# Altium project V3S_CDR_STD_V1_0_20150526.PrjPcb (part 1 of 2)
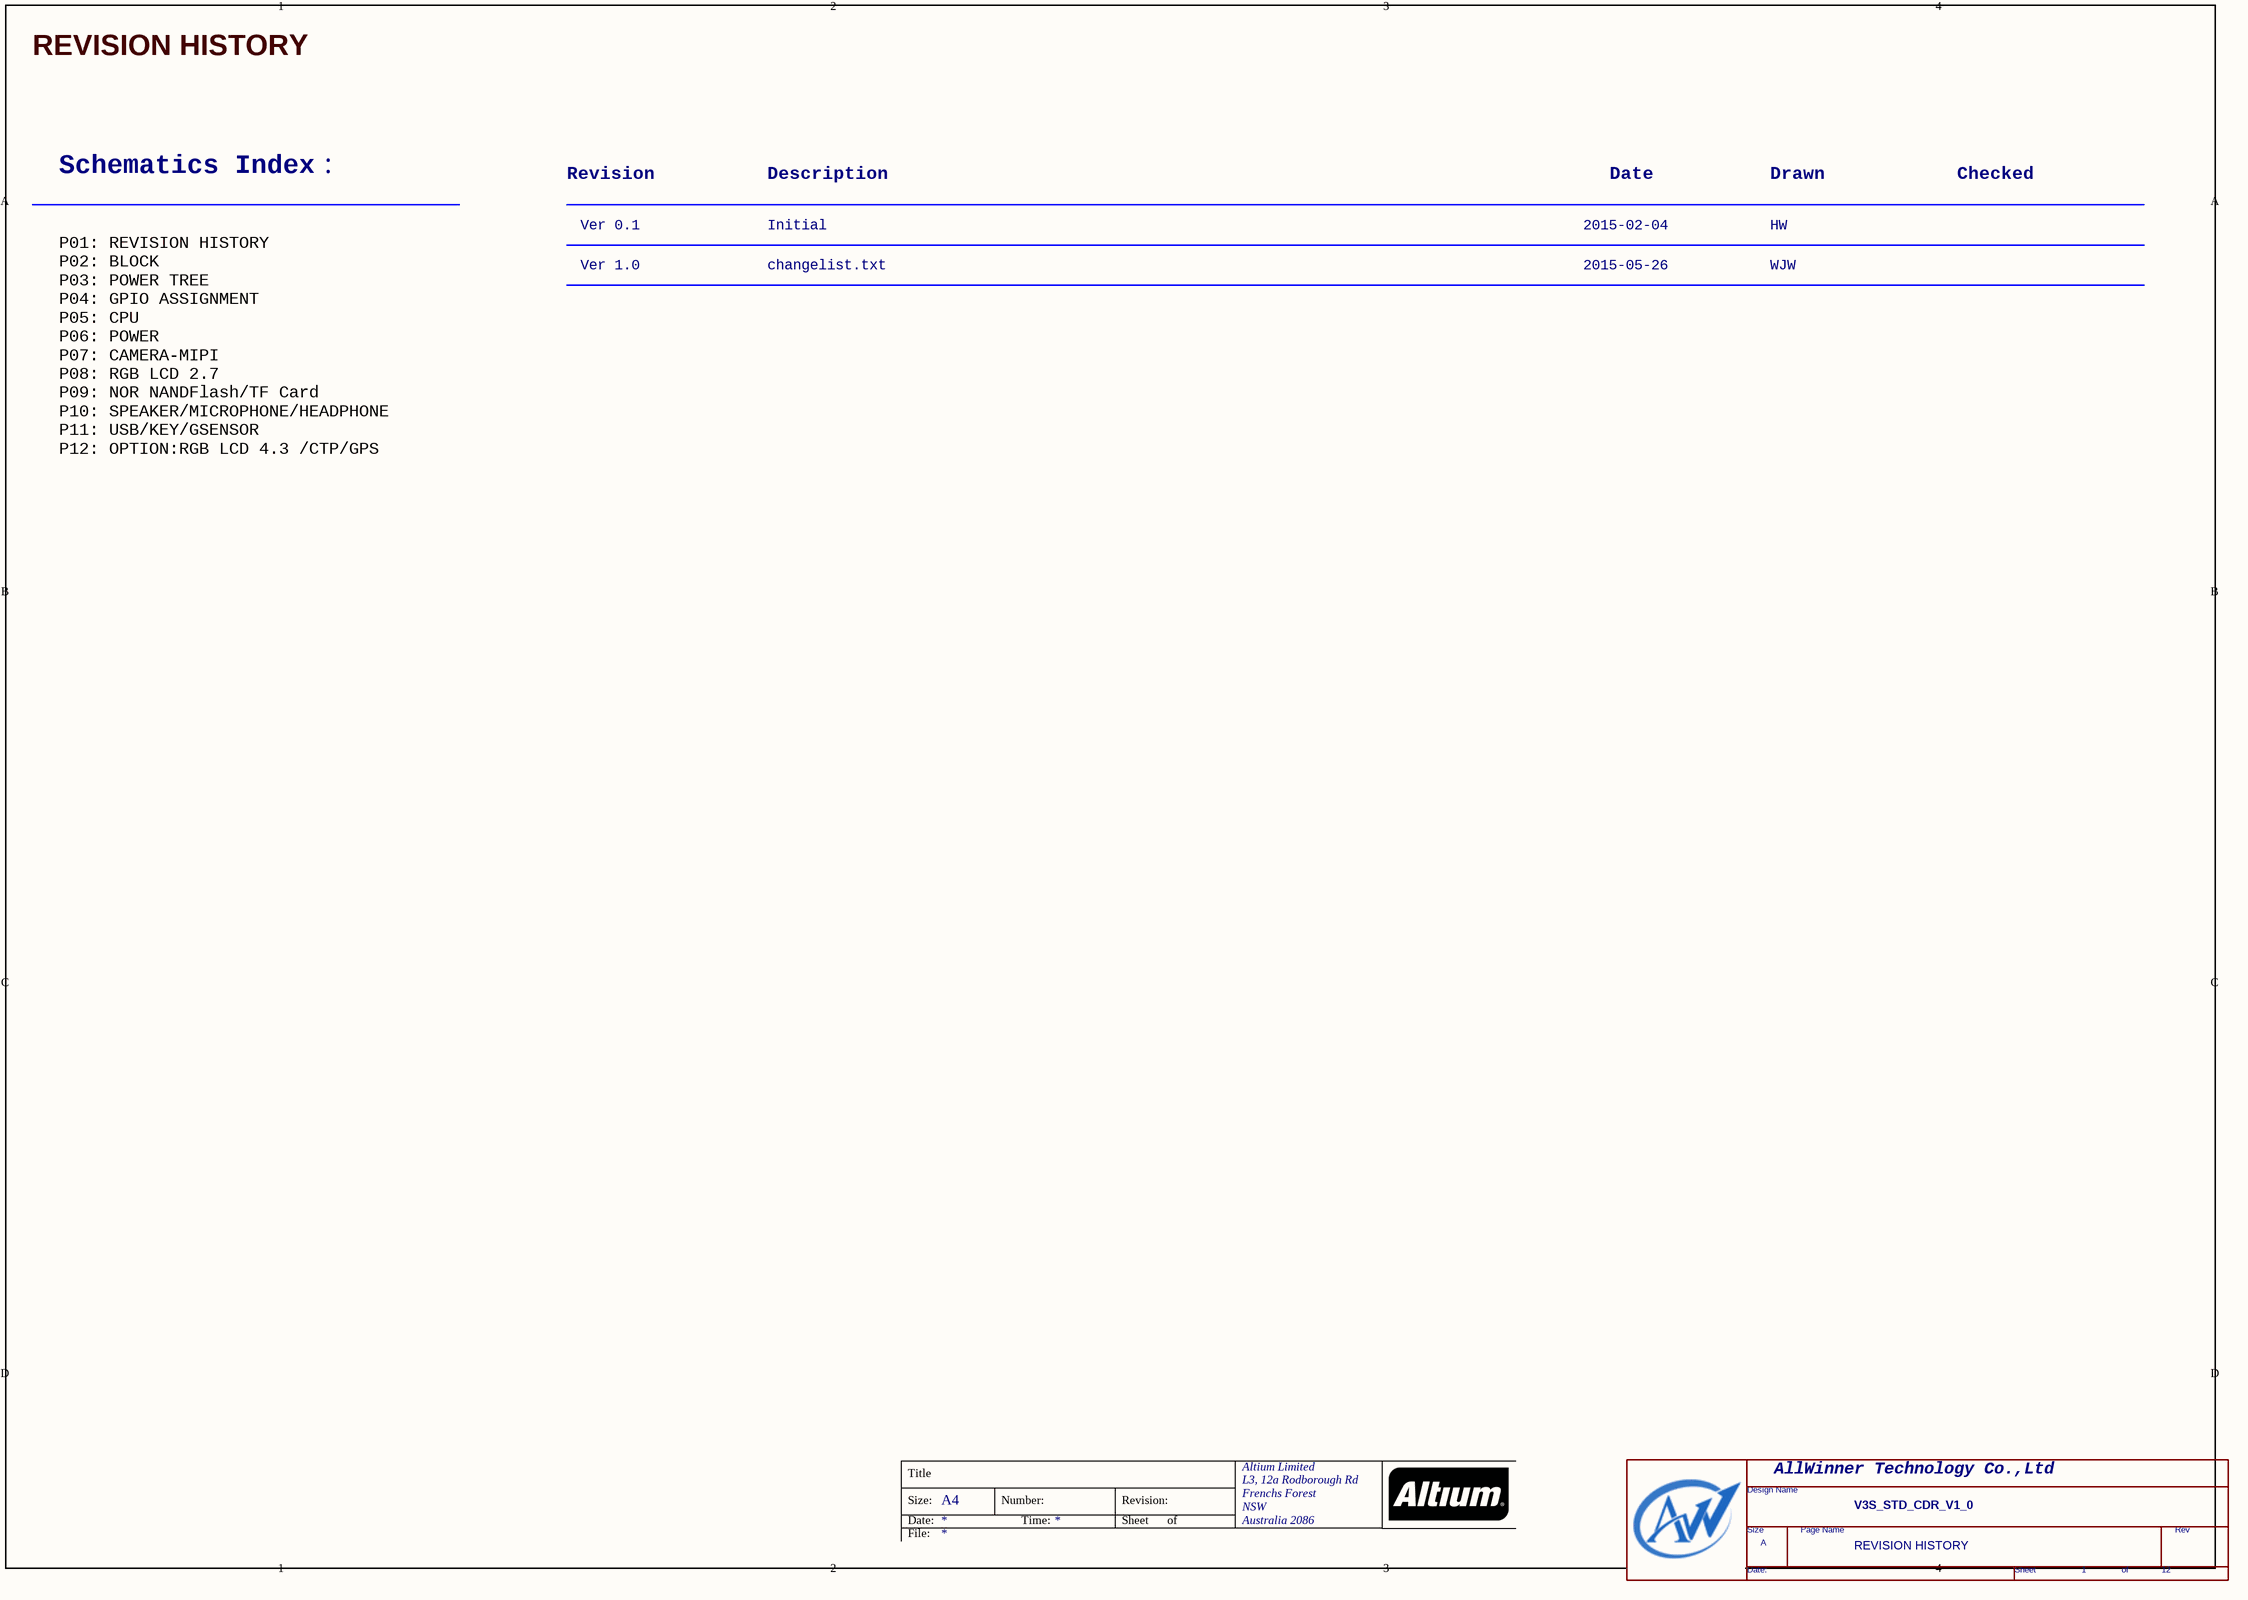
[diagram p0: 01 REVISION HISTORY.SchDoc]
12 sheets, 336 parts. Net scope: global (net labels, ports and power ports of the same name join across sheets).
Sheets:
  01 REVISION HISTORY.SchDoc
  02 BLOCK DIAGRAM.SchDoc
  03 POWER TREE.SchDoc
  04 GPIO ASSIGNMENT.SchDoc
  05 CPU.SchDoc
  06 POWER.SchDoc
  07 CAMERA-MIPI.SchDoc
  08 Serial RGB LCD.SchDoc
  09 NOR NANDFlash_TF Car.SchDoc
  10 Speaker_Microphone.SchDoc
  11 USB_KEY_GSENSOR.SchDoc
  12 RGB LCD.SchDoc

## Sheet 01 REVISION HISTORY.SchDoc
size 420 x 297 mm; Organization: Altium Limited; Address1: L3, 12a Rodborough Rd; Address2: Frenchs Forest; Address3: NSW; Address4: Australia 2086

### Parts
(Parts that share a designator on the sheet are numbered #1, #2 ... from top to bottom, then left to right.)
*#1  Page Count: 12  Page Number: 1  Page Size: A  Title: V3S_STD_CDR_V1_0  Doc: REVISION HISTORY  (hidden comment: TitleBlock0-AW)  (graphical)

### Notes on the sheet
- REVISION HISTORY
- Schematics Index：
- Revision
- Description
- Date
- Drawn
- Checked
- Ver 0.1
- Initial
- 2015-02-04
- HW
- Ver 1.0
- changelist.txt
- 2015-05-26
- WJW
- P01: REVISION HISTORY
  P02: BLOCK
  P03: POWER TREE
  P04: GPIO ASSIGNMENT
  P05: CPU
  P06: POWER
  P07: CAMERA-MIPI
  P08: RGB LCD 2.7
  P09: NOR NANDFlash/TF Card
  P10: SPEAKER/MICROPHONE/HEADPHONE
  P11: USB/KEY/GSENSOR
  P12: OPTION:RGB LCD 4.3 /CTP/GPS
- Title
- Size:
- Date:
- A4
- Number:
- Time:
- Revision:
- Sheet
- of
- File:
- (in symbol TitleBlock0-AW) AllWinner Technology Co.,Ltd; Design Name; Size; Page Name; Rev; Date:; Sheet; of

### Library data of the parts
*#1 = TitleBlock0-AW: RevCode: 0.1; Page Create Date: March  8, 1995

## Sheet 02 BLOCK DIAGRAM.SchDoc
size 420 x 297 mm; Organization: Altium Limited; Address1: L3, 12a Rodborough Rd; Address2: Frenchs Forest; Address3: NSW; Address4: Australia 2086
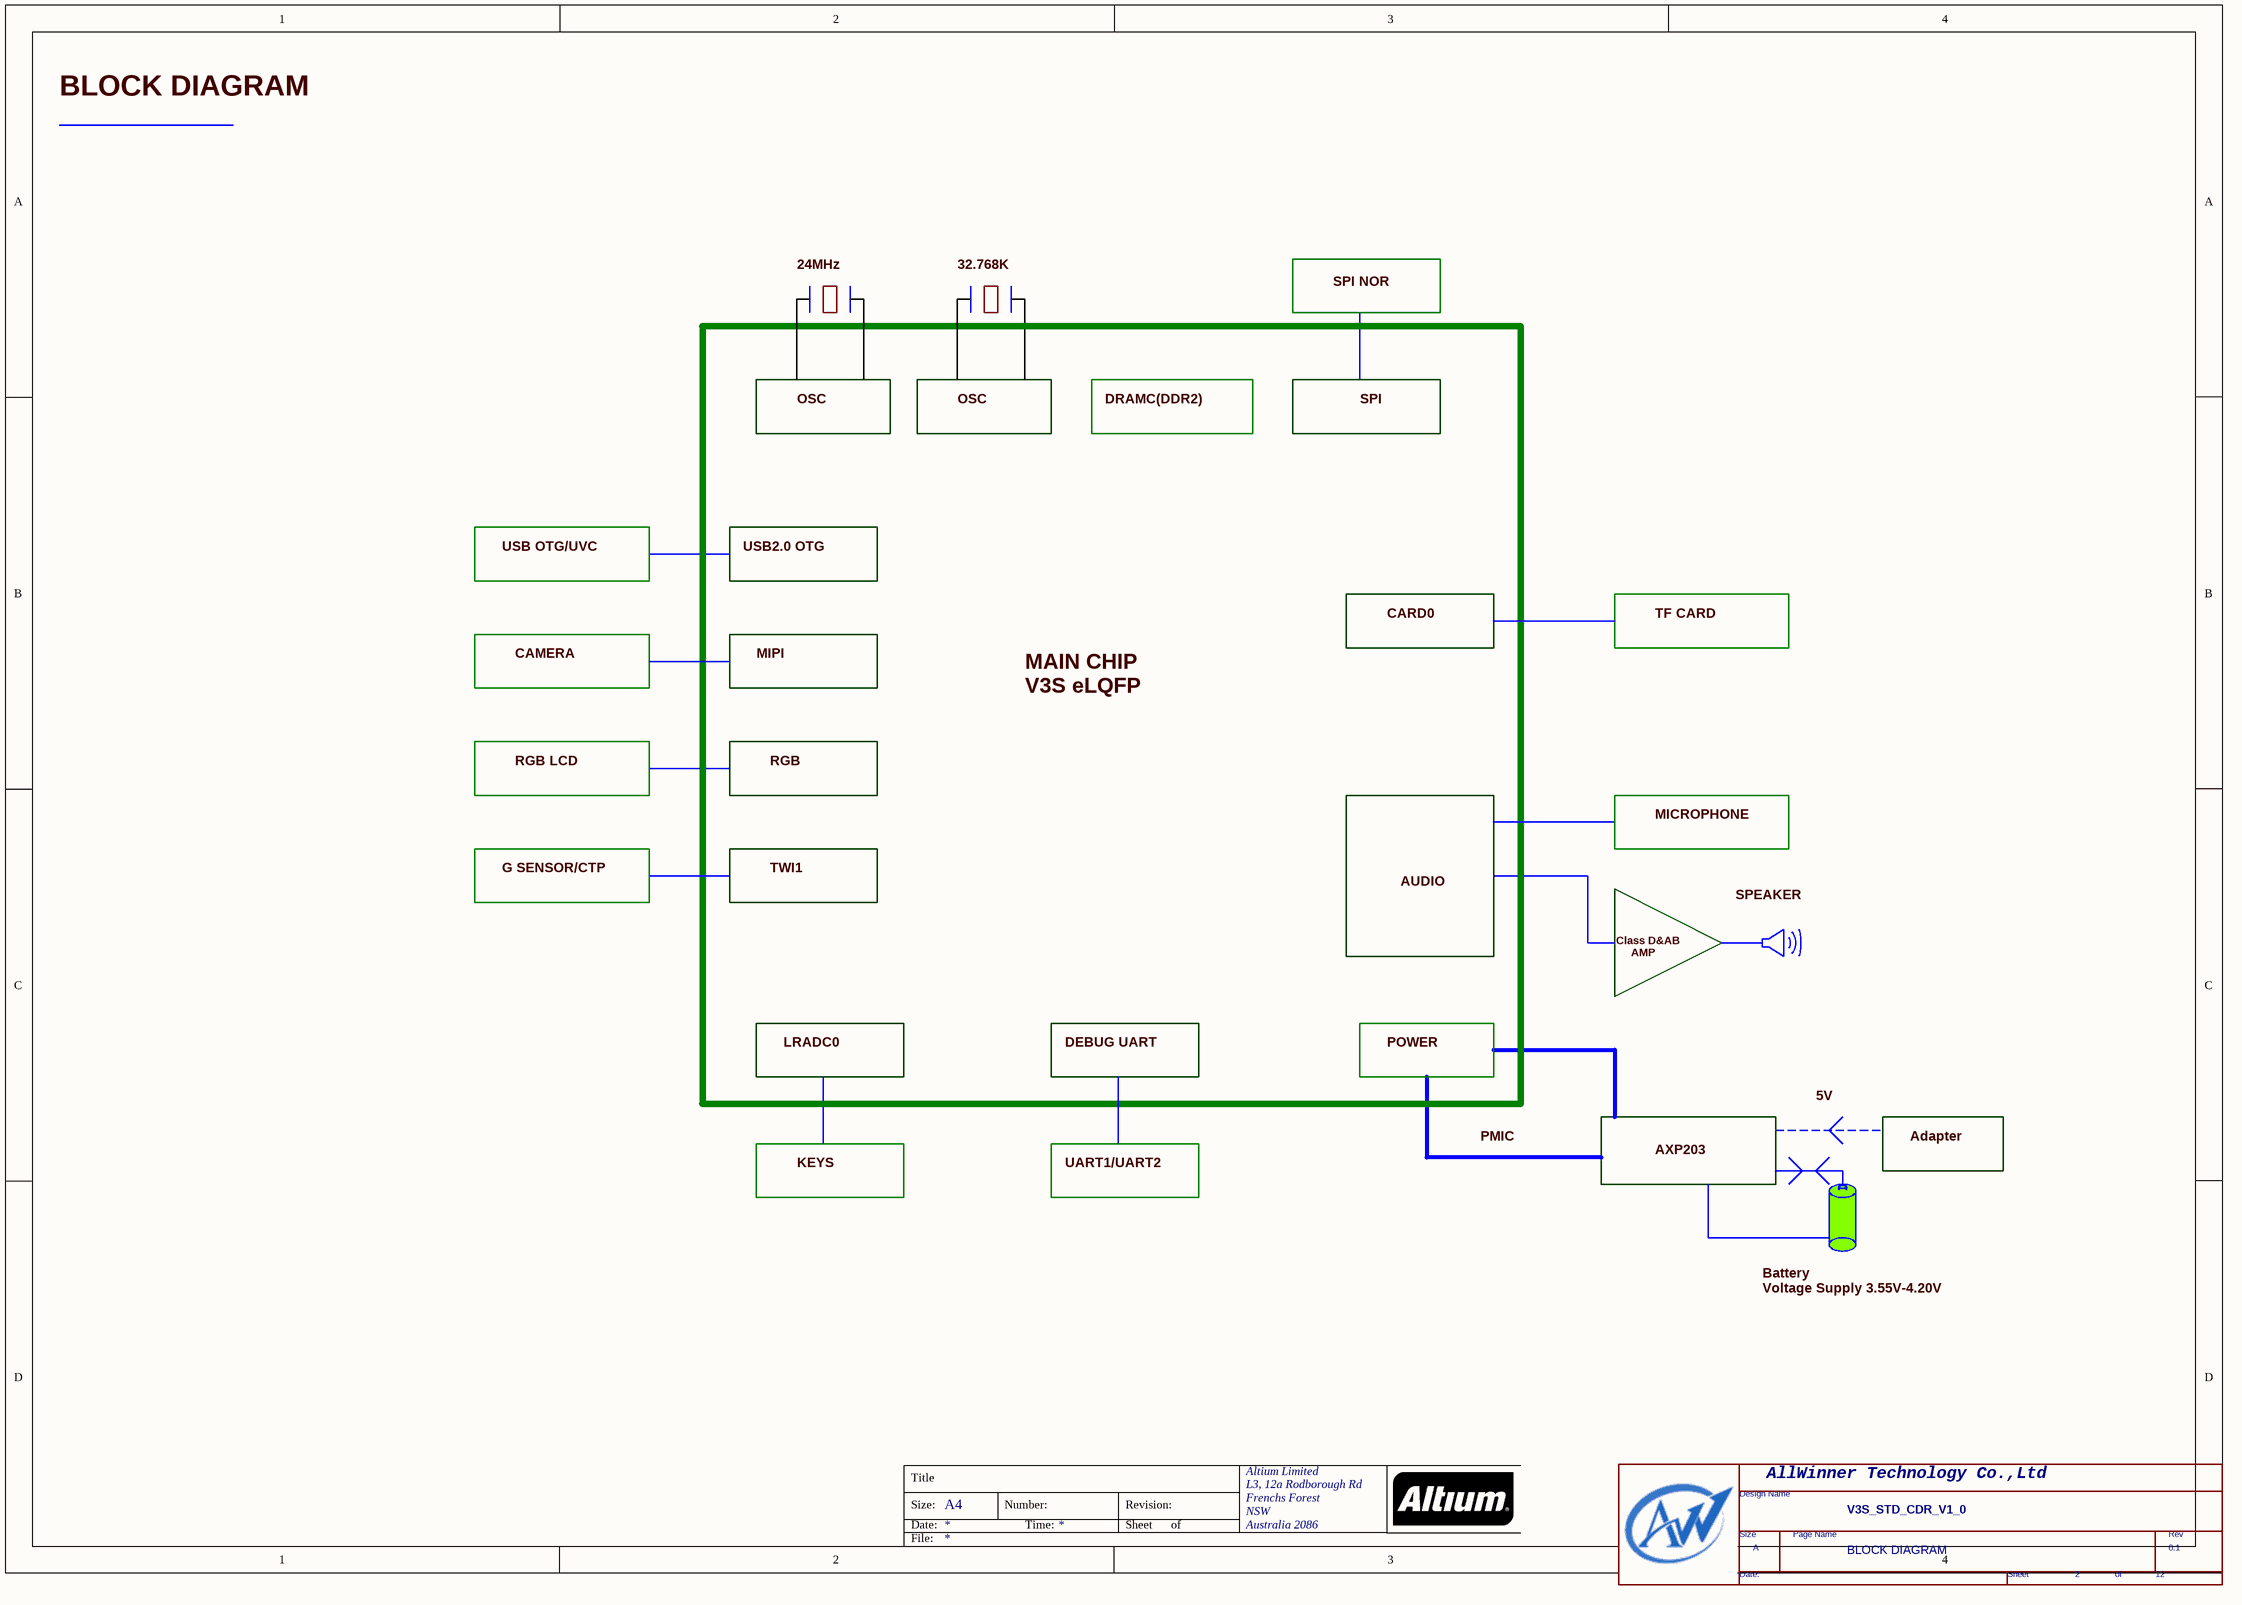
[diagram p1: 02 BLOCK DIAGRAM.SchDoc]

### Parts
(Parts that share a designator on the sheet are numbered #1, #2 ... from top to bottom, then left to right.)
*#2  Page Count: 12  Page Number: 2  Page Size: A  Title: V3S_STD_CDR_V1_0  RevCode: 0.1  Doc: BLOCK DIAGRAM  (hidden comment: TitleBlock0-AW)  (graphical)

### Notes on the sheet
- BLOCK DIAGRAM
- 24MHz
- 32.768K
- SPI NOR
- OSC
- DRAMC(DDR2)
- SPI
- USB OTG/UVC
- USB2.0 OTG
- CAMERA
- MIPI
- MAIN CHIP
  V3S eLQFP
- CARD0
- TF CARD
- RGB LCD
- RGB
- MICROPHONE
- G SENSOR/CTP
- TWI1
- AUDIO
- Class D&AB
  AMP
- SPEAKER
- LRADC0
- DEBUG UART
- POWER
- 5V
- KEYS
- UART1/UART2
- PMIC
- AXP203
- Adapter
- Battery
  Voltage Supply 3.55V-4.20V
- Title
- Size:
- Date:
- A4
- Number:
- Time:
- Revision:
- Sheet
- of
- File:
- (in symbol TitleBlock0-AW) AllWinner Technology Co.,Ltd; Design Name; Size; Page Name; Rev; Date:; Sheet; of

### Library data of the parts
*#2 = TitleBlock0-AW: Page Create Date: March  8, 1995

## Sheet 03 POWER TREE.SchDoc
size 420 x 297 mm; Organization: Altium Limited; Address1: L3, 12a Rodborough Rd; Address2: Frenchs Forest; Address3: NSW; Address4: Australia 2086
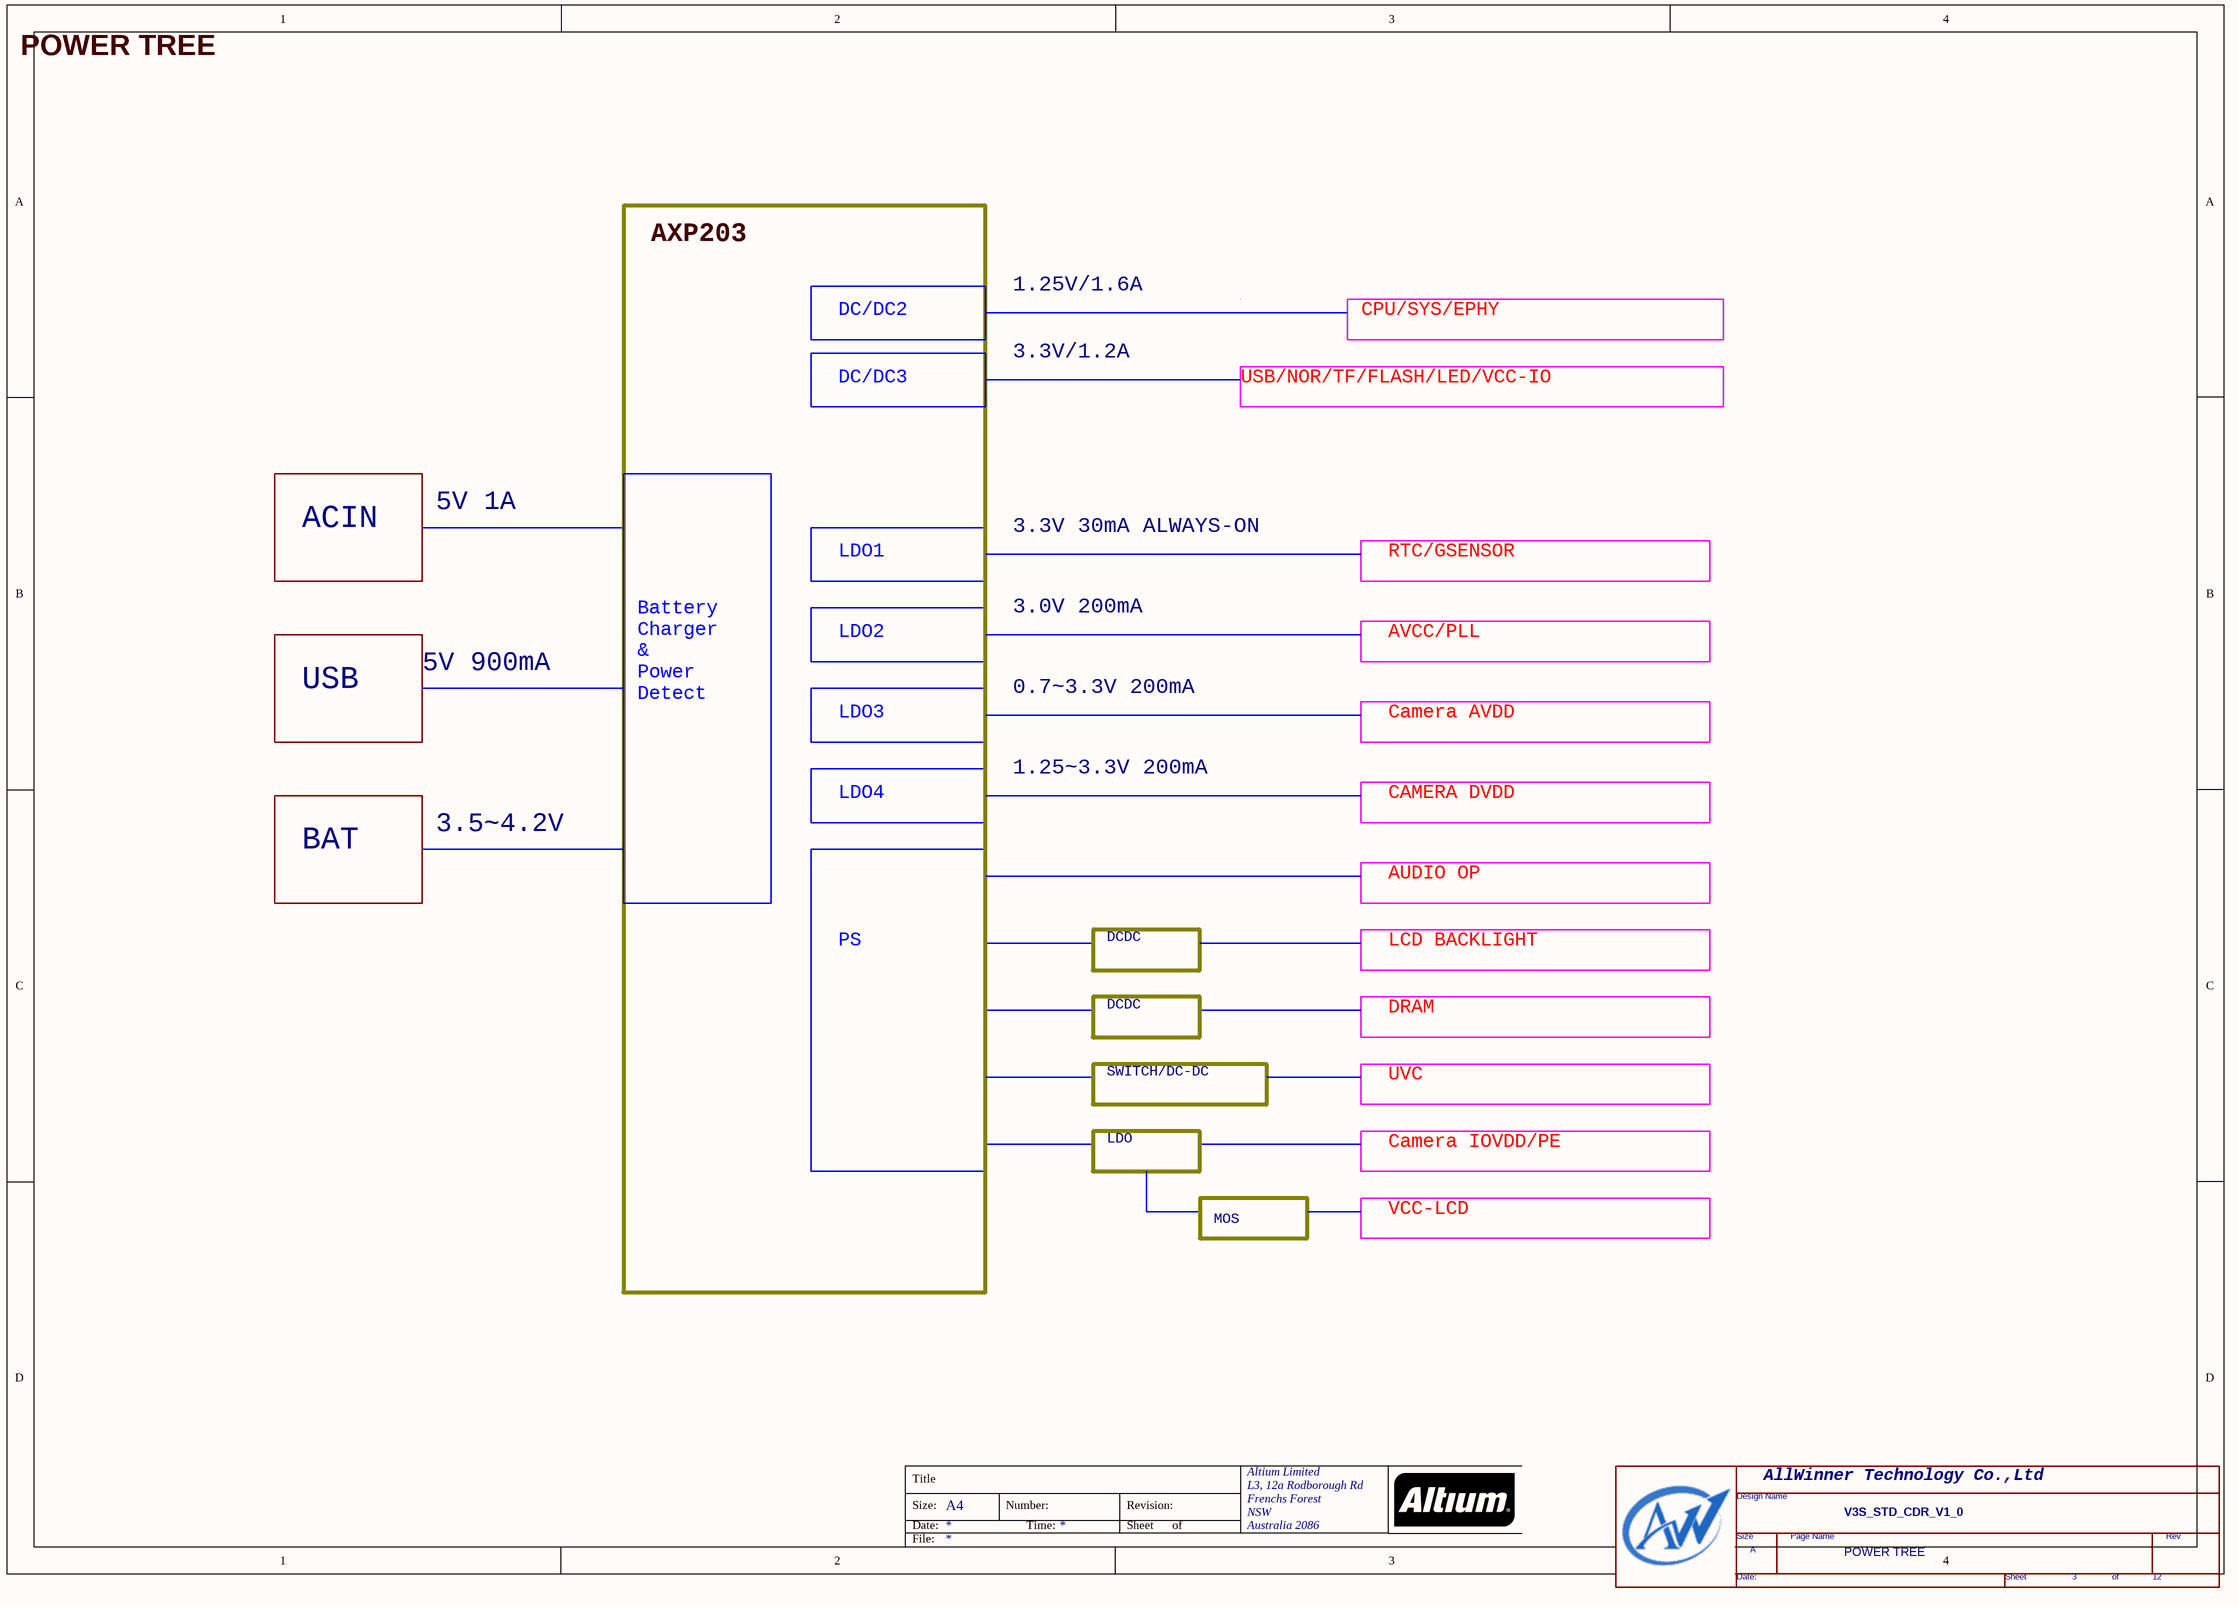
[diagram p2: 03 POWER TREE.SchDoc]

### Parts
(Parts that share a designator on the sheet are numbered #1, #2 ... from top to bottom, then left to right.)
*#3  Page Count: 12  Page Number: 3  Page Size: A  Title: V3S_STD_CDR_V1_0  Doc: POWER TREE  (hidden comment: TitleBlock0-AW)  (graphical)

### Notes on the sheet
- POWER TREE
- AXP203
- DC/DC2
- 1.25V/1.6A
- CPU/SYS/EPHY
- DC/DC3
- 3.3V/1.2A
- USB/NOR/TF/FLASH/LED/VCC-IO
- 5V 1A
- ACIN
- Battery
  Charger
  &
  Power
  Detect
- LDO1
- 3.3V 30mA ALWAYS-ON
- RTC/GSENSOR
- LDO2
- 3.0V 200mA
- AVCC/PLL
- USB
- 5V 900mA
- LDO3
- 0.7~3.3V 200mA
- Camera AVDD
- 1.25~3.3V 200mA
- BAT
- 3.5~4.2V
- LDO4
- CAMERA DVDD
- AUDIO OP
- PS
- DCDC
- LCD BACKLIGHT
- DRAM
- SWITCH/DC-DC
- UVC
- LDO
- Camera IOVDD/PE
- MOS
- VCC-LCD
- Title
- Size:
- Date:
- A4
- Number:
- Time:
- Revision:
- Sheet
- of
- File:
- (in symbol TitleBlock0-AW) AllWinner Technology Co.,Ltd; Design Name; Size; Page Name; Rev; Date:; Sheet; of

### Library data of the parts
*#3 = TitleBlock0-AW: Page Create Date: March  8, 1995

## Sheet 04 GPIO ASSIGNMENT.SchDoc
size 420 x 297 mm; Organization: Altium Limited; Address1: L3, 12a Rodborough Rd; Address2: Frenchs Forest; Address3: NSW; Address4: Australia 2086
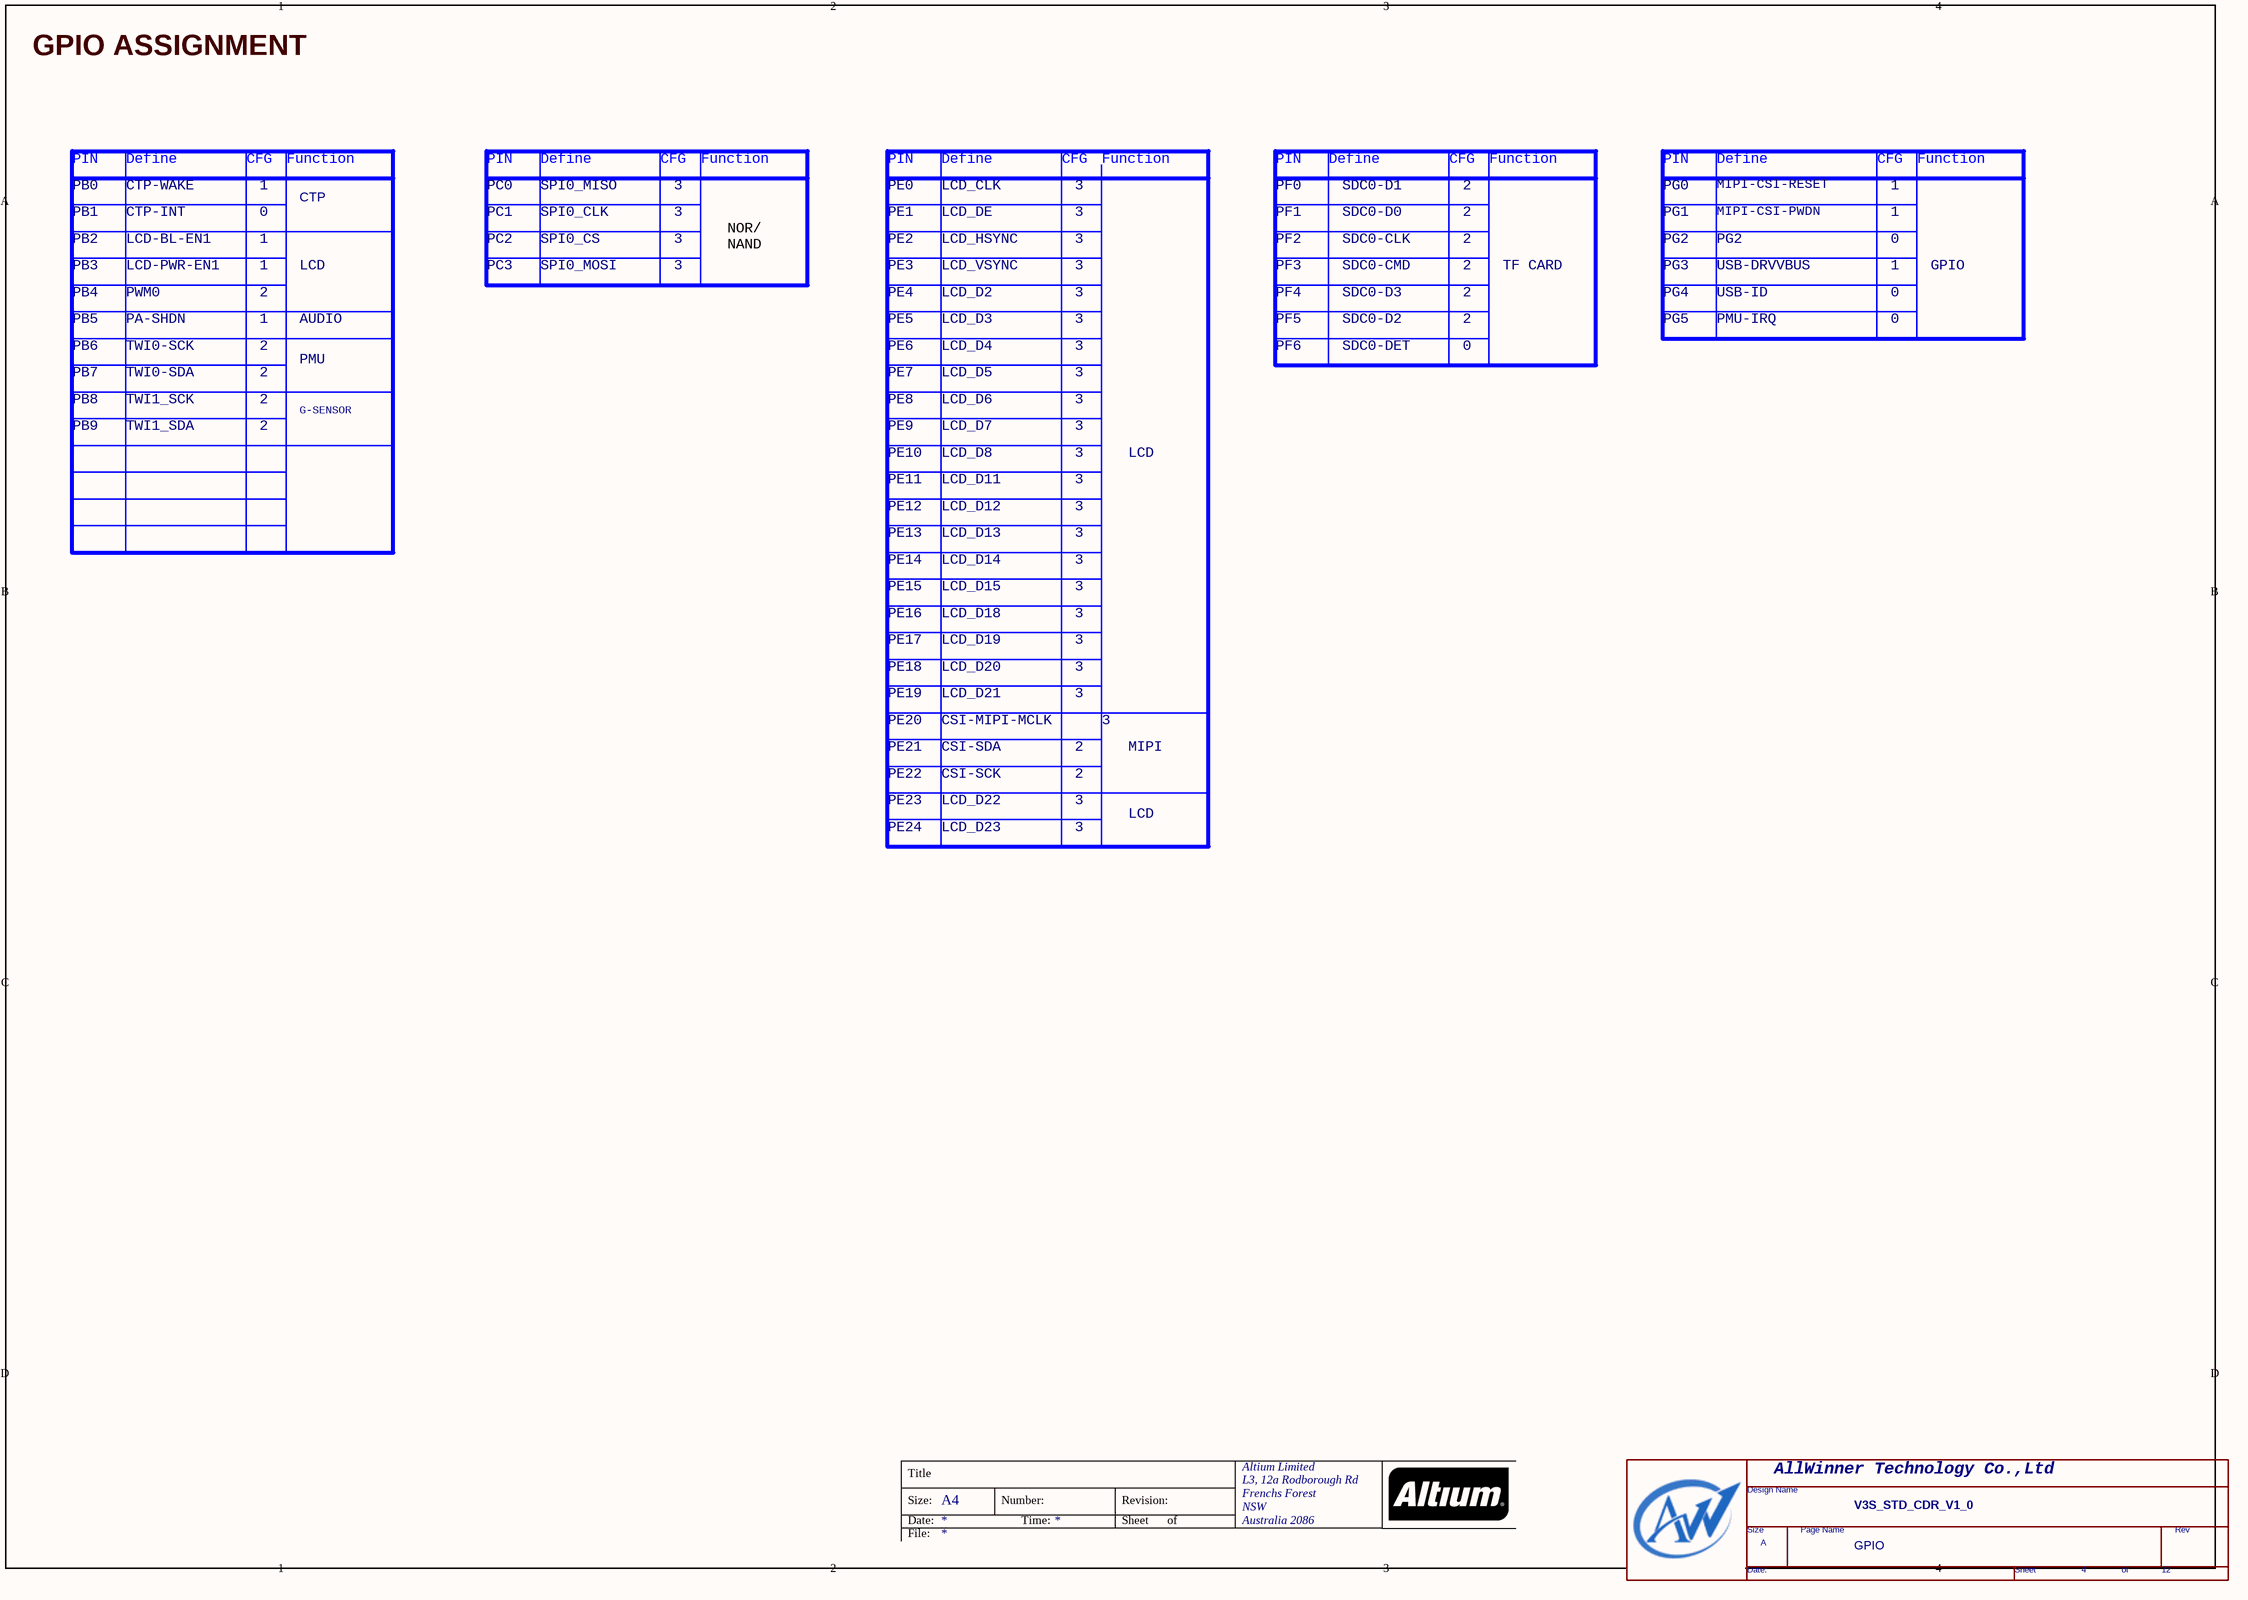
[diagram p3: 04 GPIO ASSIGNMENT.SchDoc]

### Parts
(Parts that share a designator on the sheet are numbered #1, #2 ... from top to bottom, then left to right.)
*#4  Page Count: 12  Page Number: 4  Page Size: A  Title: V3S_STD_CDR_V1_0  Doc: GPIO  (hidden comment: TitleBlock0-AW)  (graphical)

### Notes on the sheet
- GPIO ASSIGNMENT
- PIN
- PB0
- Define
- CTP-WAKE
- CFG
- 1
- Function
- PC0
- SPI0_MISO
- 3
- PE0
- LCD_CLK
- PF0
- SDC0-D1
- 2
- PG0
- MIPI-CSI-RESET
- PB1
- PB2
- CTP-INT
- LCD-BL-EN1
- 0
- CTP
- PC1
- PC2
- SPI0_CLK
- SPI0_CS
- NOR/
  NAND
- PE1
- PE2
- LCD_DE
- LCD_HSYNC
- PF1
- PF2
- SDC0-D0
- SDC0-CLK
- PG1
- PG2
- MIPI-CSI-PWDN
- PB3
- PB4
- PB5
- LCD-PWR-EN1
- PWM0
- PA-SHDN
- LCD
- AUDIO
- PC3
- SPI0_MOSI
- PE3
- PE4
- PE5
- LCD_D3
- LCD_D2
- LCD_VSYNC
- PF3
- PF4
- PF5
- SDC0-D2
- SDC0-D3
- SDC0-CMD
- TF CARD
- PG3
- PG4
- PG5
- USB-ID
- PMU-IRQ
- USB-DRVVBUS
- GPIO
- PB6
- PB7
- TWI0-SDA
- TWI0-SCK
- PMU
- PE6
- PE7
- LCD_D4
- LCD_D5
- PF6
- SDC0-DET
- PB8
- PB9
- TWI1_SCK
- TWI1_SDA
- G-SENSOR
- PE8
- PE9
- PE10
- LCD_D6
- LCD_D7
- LCD_D8
- PE11
- PE12
- LCD_D11
- LCD_D12
- PE13
- PE14
- PE15
- LCD_D15
- LCD_D14
- LCD_D13
- PE16
- PE17
- LCD_D19
- LCD_D18
- PE18
- PE19
- PE20
- LCD_D21
- LCD_D20
- CSI-MIPI-MCLK
- PE21
- PE22
- CSI-SDA
- CSI-SCK
- MIPI
- PE23
- PE24
- LCD_D23
- LCD_D22
- Title
- Size:
- Date:
- A4
- Number:
- Time:
- Revision:
- Sheet
- of
- File:
- (in symbol TitleBlock0-AW) AllWinner Technology Co.,Ltd; Design Name; Size; Page Name; Rev; Date:; Sheet; of

### Library data of the parts
*#4 = TitleBlock0-AW: RevCode: 0.1; Page Create Date: March  8, 1995

## Sheet 05 CPU.SchDoc
size 420 x 297 mm; Organization: Altium Limited; Address1: L3, 12a Rodborough Rd; Address2: Frenchs Forest; Address3: NSW; Address4: Australia 2086
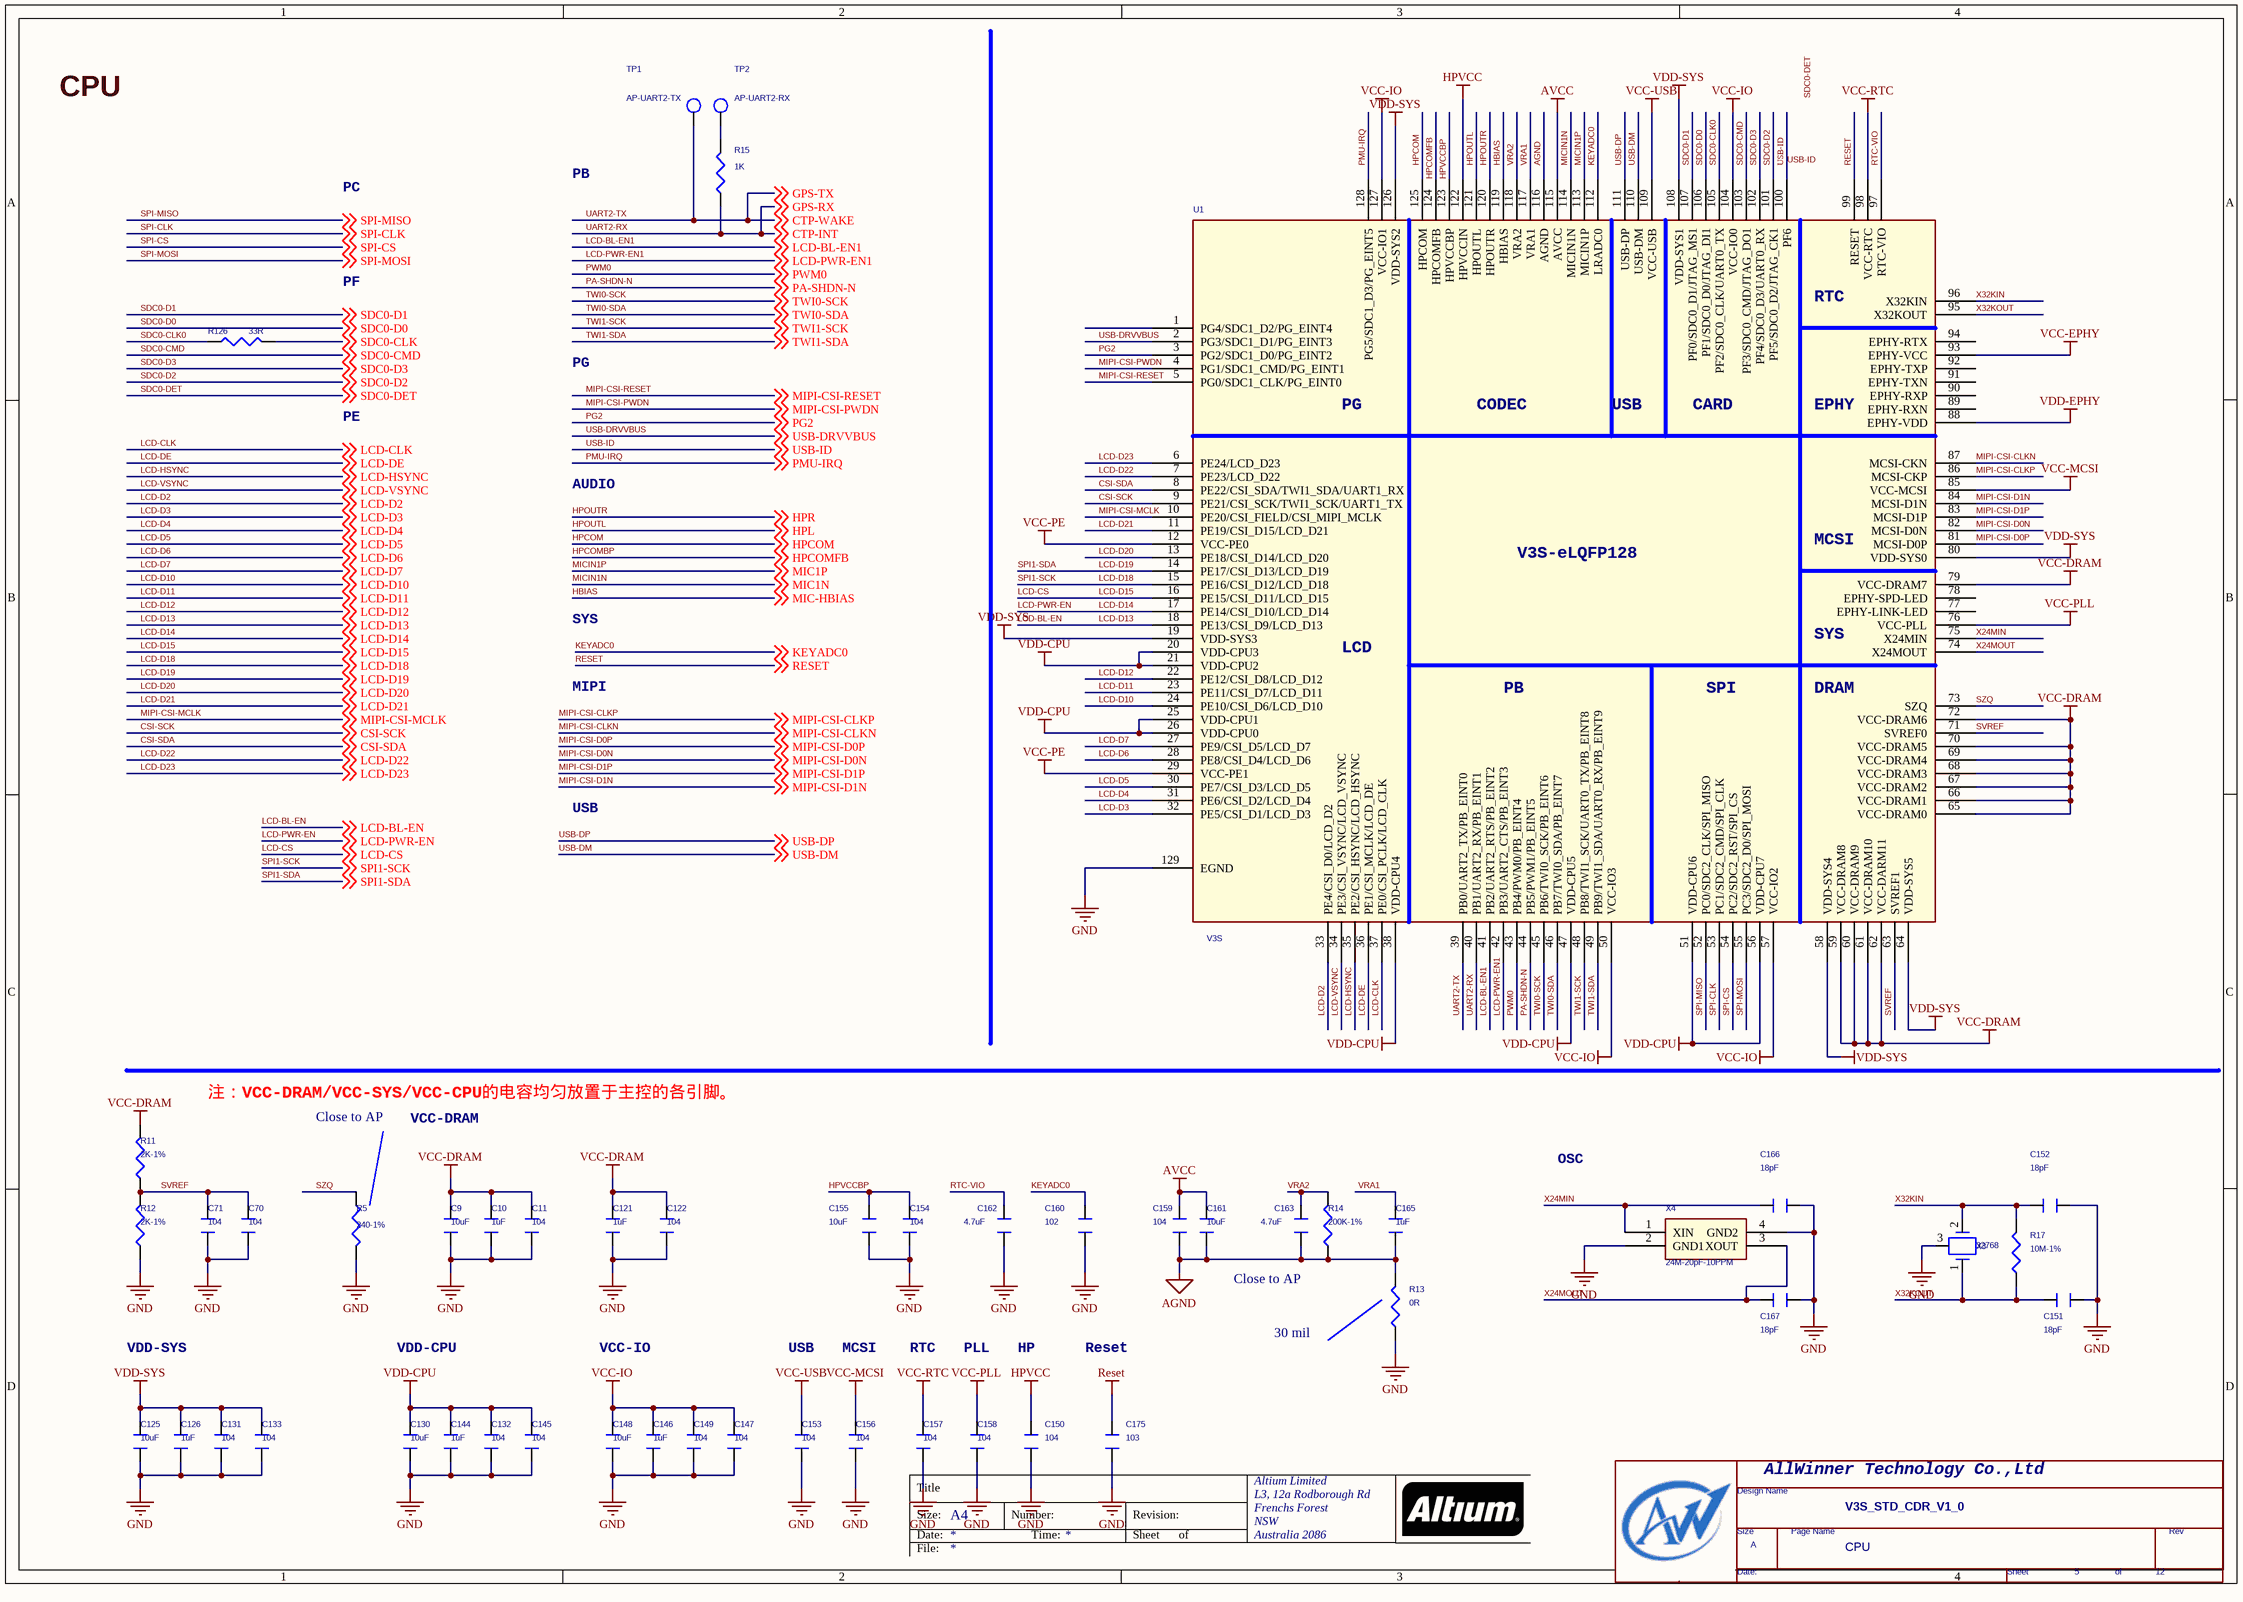
[diagram p4: 05 CPU.SchDoc]

### Parts
(Parts that share a designator on the sheet are numbered #1, #2 ... from top to bottom, then left to right.)
*#5  Page Count: 12  Page Number: 5  Page Size: A  Title: V3S_STD_CDR_V1_0  Doc: CPU  (hidden comment: TitleBlock0-AW)  (graphical)
C9  10uF  [C0603]
C10  1uF  [C0402]
C11  104  [C0402]
C70  104  [C0402]
C71  104  [C0402]
C121  1uF  [C0402]
C122  104  [C0402]
C125  10uF  [C0603]
C126  1uF  [C0402]
C130  10uF  [C0603]
C131  104  [C0402]
C132  104  [C0402]
C133  104  [C0402]
C144  1uF  [C0402]
C145  104  [C0402]
C146  1uF  [C0402]
C147  104  [C0402]
C148  10uF  [C0603]
C149  104  [C0402]
C150  104  [C0402]
C151  18pF  [C0402]
C152  18pF  [C0402]
C153  104  [C0402]
C154  104  [C0402]
C155  10uF  [C0603]
C156  104  [C0402]
C157  104  [C0402]
C158  104  [C0402]
C159  104  [C0402]
C160  102  [C0402]
C161  10uF  [C0603]
C162  4.7uF  [C0402]
C163  4.7uF  [C0402]
C165  1uF  [C0402]
C166  18pF  [C0402]
C167  18pF  [C0402]
C175  103  [C0402]
R5  240-1%  [R0402]
R11  2K-1%  [R0402]
R12  2K-1%  [R0402]
R13  0R  [R0402]
R14  200K-1%  [R0402]
R15  1K  [R0402]
R17  10M-1%  [R0402]
R126  33R  [R0402]
TP1  AP-UART2-TX  [TP_SMD]
TP2  AP-UART2-RX  [TP_SMD]
U1  V3S  [eLPFP128]
X3  32768  [XCOL-3]
X4  24M-20pF-10PPM  [CRY-3225]

### Nets
AGND: C159.1 C161.1 C163.1 C165.1 R13.2 R14.1 U1.116(AGND)
AVCC: C158.2 C159.2 C161.2 U1.76(VCC-PLL) U1.115(AVCC)  [also labelled VCC-PLL]
GND: C9.1 C10.1 C11.1 C70.1 C71.1 C121.1 C122.1 C125.1 C126.1 C130.1 C131.1 C132.1 C133.1 C144.1 C145.1 C146.1 C147.1 C148.1 C149.1 C150.1 C151.1 C152.1 C153.1 C154.1 C155.1 C156.1 C157.1 C158.1 C160.1 C162.1 C166.1 C167.1 C175.1 R5.2 R12.1 R13.1 U1.129(EGND) X3.3(Shield) X4.2(GND1) X4.4(GND2)
HPVCC: C146.2 C147.2 C148.2 C149.2 C150.2 C153.2 C156.2 U1.50(VCC-IO3) U1.57(VCC-IO2) U1.85(VCC-MCSI) U1.93(EPHY-VCC) U1.104(VCC-IO0) U1.109(VCC-USB) U1.122(HPVCCIN) U1.127(VCC-IO1)  [also labelled VCC-EPHY, VCC-IO, VCC-MCSI, VCC-USB]  [project net DCDC3]
RESET: C175.2 U1.99(RESET) ; off-sheet RESET
VCC-DRAM: C9.2 C10.2 C11.2 C121.2 C122.2 R11.2 U1.59(VCC-DRAM8) U1.60(VCC-DRAM9) U1.61(VCC-DRAM10) U1.62(VCC-DARM11) U1.65(VCC-DRAM0) U1.66(VCC-DRAM1) U1.67(VCC-DRAM2) U1.68(VCC-DRAM3) U1.69(VCC-DRAM4) U1.70(VCC-DRAM5) U1.72(VCC-DRAM6) U1.79(VCC-DRAM7)
VCC-PE: U1.12(VCC-PE0) U1.29(VCC-PE1)  [project net MIPI-IOVCC]
VCC-RTC: C157.2 U1.98(VCC-RTC)  [project net LDO1]
VDD-CPU: C125.2 C126.2 C130.2 C131.2 C132.2 C133.2 C144.2 C145.2 U1.19(VDD-SYS3) U1.20(VDD-CPU3) U1.21(VDD-CPU2) U1.25(VDD-CPU1) U1.26(VDD-CPU0) U1.38(VDD-CPU4) U1.47(VDD-CPU5) U1.51(VDD-CPU6) U1.56(VDD-CPU7) U1.58(VDD-SYS4) U1.64(VDD-SYS5) U1.80(VDD-SYS0) U1.88(EPHY-VDD) U1.108(VDD-SYS1) U1.126(VDD-SYS2)  [also labelled VDD-EPHY, VDD-SYS]  [project net DCDC2]
CSI-SCK: U1.9(PE21/CSI_SCK/TWI1_SCK/UART1_TX) ; off-sheet CSI-SCK
CSI-SDA: U1.8(PE22/CSI_SDA/TWI1_SDA/UART1_RX) ; off-sheet CSI-SDA
CTP-INT: R15.1 U1.40(PB1/UART2_RX/PB_EINT1) ; off-sheet CTP-INT, off-sheet GPS-RX  [also labelled GPS-RX, UART2-RX]
CTP-WAKE: TP1.1(TP) U1.39(PB0/UART2_TX/PB_EINT0) ; off-sheet CTP-WAKE, off-sheet GPS-TX  [also labelled GPS-TX, UART2-TX]
HBIAS: U1.119(HBIAS) ; off-sheet MIC-HBIAS  [also labelled MIC-HBIAS]
HPCOM: U1.125(HPCOM) ; off-sheet HPCOM
HPCOMBP: U1.124(HPCOMFB) ; off-sheet HPCOMFB  [also labelled HPCOMFB]
HPL: U1.121(HPOUTL) ; off-sheet HPL  [also labelled HPOUTL]
HPOUTR: U1.120(HPOUTR) ; off-sheet HPR  [also labelled HPR]
HPVCCBP: C154.2 C155.2 U1.123(HPVCCBP)
KEYADC0: C160.2 U1.112(LRADC0) ; off-sheet KEYADC0
LCD-BL-EN: U1.18(PE13/CSI_D9/LCD_D13) U1.41(PB2/UART2_RTS/PB_EINT2) ; off-sheet LCD-BL-EN1, off-sheet LCD-D13, off-sheet LCD-BL-EN  [also labelled LCD-BL-EN1, LCD-D13]
LCD-CLK: U1.37(PE0/CSI_PCLK/LCD_CLK) ; off-sheet LCD-CLK
LCD-CS: U1.16(PE15/CSI_D11/LCD_D15) ; off-sheet LCD-D15, off-sheet LCD-CS  [also labelled LCD-D15]
LCD-D2: U1.33(PE4/CSI_D0/LCD_D2) ; off-sheet LCD-D2
LCD-D3: U1.32(PE5/CSI_D1/LCD_D3) ; off-sheet LCD-D3
LCD-D4: U1.31(PE6/CSI_D2/LCD_D4) ; off-sheet LCD-D4
LCD-D5: U1.30(PE7/CSI_D3/LCD_D5) ; off-sheet LCD-D5
LCD-D6: U1.28(PE8/CSI_D4/LCD_D6) ; off-sheet LCD-D6
LCD-D7: U1.27(PE9/CSI_D5/LCD_D7) ; off-sheet LCD-D7
LCD-D10: U1.24(PE10/CSI_D6/LCD_D10) ; off-sheet LCD-D10
LCD-D11: U1.23(PE11/CSI_D7/LCD_D11) ; off-sheet LCD-D11
LCD-D12: U1.22(PE12/CSI_D8/LCD_D12) ; off-sheet LCD-D12
LCD-D14: U1.17(PE14/CSI_D10/LCD_D14) U1.42(PB3/UART2_CTS/PB_EINT3) ; off-sheet LCD-PWR-EN1, off-sheet LCD-D14, off-sheet LCD-PWR-EN  [also labelled LCD-PWR-EN, LCD-PWR-EN1]
LCD-D18: U1.15(PE16/CSI_D12/LCD_D18) ; off-sheet LCD-D18, off-sheet SPI1-SCK  [also labelled SPI1-SCK]
LCD-D19: U1.14(PE17/CSI_D13/LCD_D19) ; off-sheet LCD-D19, off-sheet SPI1-SDA  [also labelled SPI1-SDA]
LCD-D20: U1.13(PE18/CSI_D14/LCD_D20) ; off-sheet LCD-D20
LCD-D21: U1.11(PE19/CSI_D15/LCD_D21) ; off-sheet LCD-D21
LCD-D22: U1.7(PE23/LCD_D22) ; off-sheet LCD-D22
LCD-D23: U1.6(PE24/LCD_D23) ; off-sheet LCD-D23
LCD-DE: U1.36(PE1/CSI_MCLK/LCD_DE) ; off-sheet LCD-DE
LCD-HSYNC: U1.35(PE2/CSI_HSYNC/LCD_HSYNC) ; off-sheet LCD-HSYNC
LCD-VSYNC: U1.34(PE3/CSI_VSYNC/LCD_VSYNC) ; off-sheet LCD-VSYNC
MIC1N: U1.114(MICIN1N) ; off-sheet MIC1N  [also labelled MICIN1N]
MIC1P: U1.113(MICIN1P) ; off-sheet MIC1P  [also labelled MICIN1P]
MIPI-CSI-CLKN: U1.87(MCSI-CKN) ; off-sheet MIPI-CSI-CLKN
MIPI-CSI-CLKP: U1.86(MCSI-CKP) ; off-sheet MIPI-CSI-CLKP
MIPI-CSI-D0N: U1.82(MCSI-D0N) ; off-sheet MIPI-CSI-D0N
MIPI-CSI-D0P: U1.81(MCSI-D0P) ; off-sheet MIPI-CSI-D0P
MIPI-CSI-D1N: U1.84(MCSI-D1N) ; off-sheet MIPI-CSI-D1N
MIPI-CSI-D1P: U1.83(MCSI-D1P) ; off-sheet MIPI-CSI-D1P
MIPI-CSI-MCLK: U1.10(PE20/CSI_FIELD/CSI_MIPI_MCLK) ; off-sheet MIPI-CSI-MCLK
MIPI-CSI-PWDN: U1.4(PG1/SDC1_CMD/PG_EINT1) ; off-sheet MIPI-CSI-PWDN
MIPI-CSI-RESET: U1.5(PG0/SDC1_CLK/PG_EINT0) ; off-sheet MIPI-CSI-RESET
PA-SHDN-N: U1.44(PB5/PWM1/PB_EINT5) ; off-sheet PA-SHDN-N
PG2: U1.3(PG2/SDC1_D0/PG_EINT2) ; off-sheet PG2
PMU-IRQ: U1.128(PG5/SDC1_D3/PG_EINT5) ; off-sheet PMU-IRQ
PWM0: U1.43(PB4/PWM0/PB_EINT4) ; off-sheet PWM0  [project net LCD-PWM]
RTC-VIO: C162.2 U1.97(RTC-VIO)
SDC0-CLK: R126.2 ; off-sheet SDC0-CLK
SDC0-CLK0: R126.1 U1.105(PF2/SDC0_CLK/UART0_TX)
SDC0-CMD: U1.103(PF3/SDC0_CMD/JTAG_DO1) ; off-sheet SDC0-CMD
SDC0-D0: U1.106(PF1/SDC0_D0/JTAG_DI1) ; off-sheet SDC0-D0
SDC0-D1: U1.107(PF0/SDC0_D1/JTAG_MS1) ; off-sheet SDC0-D1
SDC0-D2: U1.101(PF5/SDC0_D2/JTAG_CK1) ; off-sheet SDC0-D2
SDC0-D3: U1.102(PF4/SDC0_D3/UART0_RX) ; off-sheet SDC0-D3
SPI-CLK: U1.53(PC1/SDC2_CMD/SPI_CLK) ; off-sheet SPI-CLK
SPI-CS: U1.54(PC2/SDC2_RST/SPI_CS) ; off-sheet SPI-CS
SPI-MISO: U1.52(PC0/SDC2_CLK/SPI_MISO) ; off-sheet SPI-MISO
SPI-MOSI: U1.55(PC3/SDC2_D0/SPI_MOSI) ; off-sheet SPI-MOSI
SVREF: C70.2 C71.2 R11.1 R12.2 U1.63(SVREF1) U1.71(SVREF0)
SZQ: R5.1 U1.73(SZQ)
TWI0-SCK: U1.45(PB6/TWI0_SCK/PB_EINT6) ; off-sheet TWI0-SCK  [project net TWI-SCK]
TWI0-SDA: U1.46(PB7/TWI0_SDA/PB_EINT7) ; off-sheet TWI0-SDA  [project net TWI-SDA]
TWI1-SCK: U1.48(PB8/TWI1_SCK/UART0_TX/PB_EINT8) ; off-sheet TWI1-SCK  [project net CTP-SCK]
TWI1-SDA: U1.49(PB9/TWI1_SDA/UART0_RX/PB_EINT9) ; off-sheet TWI1-SDA  [project net CTP-SDA]
USB-DM: U1.110(USB-DM) ; off-sheet USB-DM
USB-DP: U1.111(USB-DP) ; off-sheet USB-DP
USB-DRVVBUS: U1.2(PG3/SDC1_D1/PG_EINT3) ; off-sheet USB-DRVVBUS
USB-ID: U1.100(PF6) ; off-sheet USB-ID
VRA1: C165.2 U1.117(VRA1)
VRA2: C163.2 R14.2 U1.118(VRA2)
X24MIN: C166.2 U1.75(X24MIN) X4.1(XIN)
X24MOUT: C167.2 U1.74(X24MOUT) X4.3(XOUT)
X32KIN: C152.2 R17.2 U1.96(X32KIN) X3.2
X32KOUT: C151.2 R17.1 U1.95(X32KOUT) X3.1
NetR15_2: R15.2 TP2.1(TP)

Not connected (* = marked no-connect by the designer): U1 1(PG4/SDC1_D2/PG_EINT4) 77(EPHY-LINK-LED) 78(EPHY-SPD-LED) 89(EPHY-RXN) 90(EPHY-RXP) 91(EPHY-TXN) 92(EPHY-TXP) 94(EPHY-RTX)

### Notes on the sheet
- CPU
- PC
- PB
- PF
- PG
- PE
- AUDIO
- SYS
- MIPI
- USB
- 注：VCC-DRAM/VCC-SYS/VCC-CPU的电容均匀放置于主控的各引脚。
- Close to AP
- VCC-DRAM
- OSC
- 30 mil
- VDD-SYS
- VDD-CPU
- VCC-IO
- MCSI
- RTC
- PLL
- HP
- Reset
- Labels drawn without touching a wire or pin: SDC0-DET
- Title
- Size:
- Date:
- A4
- Number:
- Time:
- Revision:
- Sheet
- of
- File:
- (in symbol TitleBlock0-AW) AllWinner Technology Co.,Ltd; Design Name; Size; Page Name; Rev; Date:; Sheet; of
- (in symbol V3S_1) RTC; PG; CODEC; USB; CARD; EPHY; MCSI; V3S-eLQFP128; SYS; LCD; PB; SPI; DRAM

### Library data of the parts
C9-C11 C121 C122 C125 C126 C130-C133 C144-C149 C153 C156-C158 = CAPACITOR_0_Dup5
C70 C71 C151 C152 C162 C166 C167 = CAPACITOR_0_Dup5: PAGE: 2
C150 C175 = CAPACITOR_0_Dup5: PAGE: 3
C154 C155 C159 C161 = CAPACITOR_0: PAGE: 2
C160 C163 C165 = CAPACITOR_0
R5 R15 R126 = R_Dup4
R11 R12 = ?_0_Dup1
R13 R14 = R_Dup1
R17 = R_Dup3
TP1 TP2 = T_POINT_R
U1 = V3S_1
X3 = CRYSTAL_XCOL-3
X4 = CRYSTAL-4_0: Crystal 24MHz 20pF 10ppm  -30 to +85; PART NUMBER: 7M24000004; Vendor: TXC; SPREADWIN PN: U3000019A
*#5 = TitleBlock0-AW: Page Create Date: March  8, 1995

## Sheet 06 POWER.SchDoc
size 420 x 297 mm; Organization: Altium Limited; Address1: L3, 12a Rodborough Rd; Address2: Frenchs Forest; Address3: NSW; Address4: Australia 2086
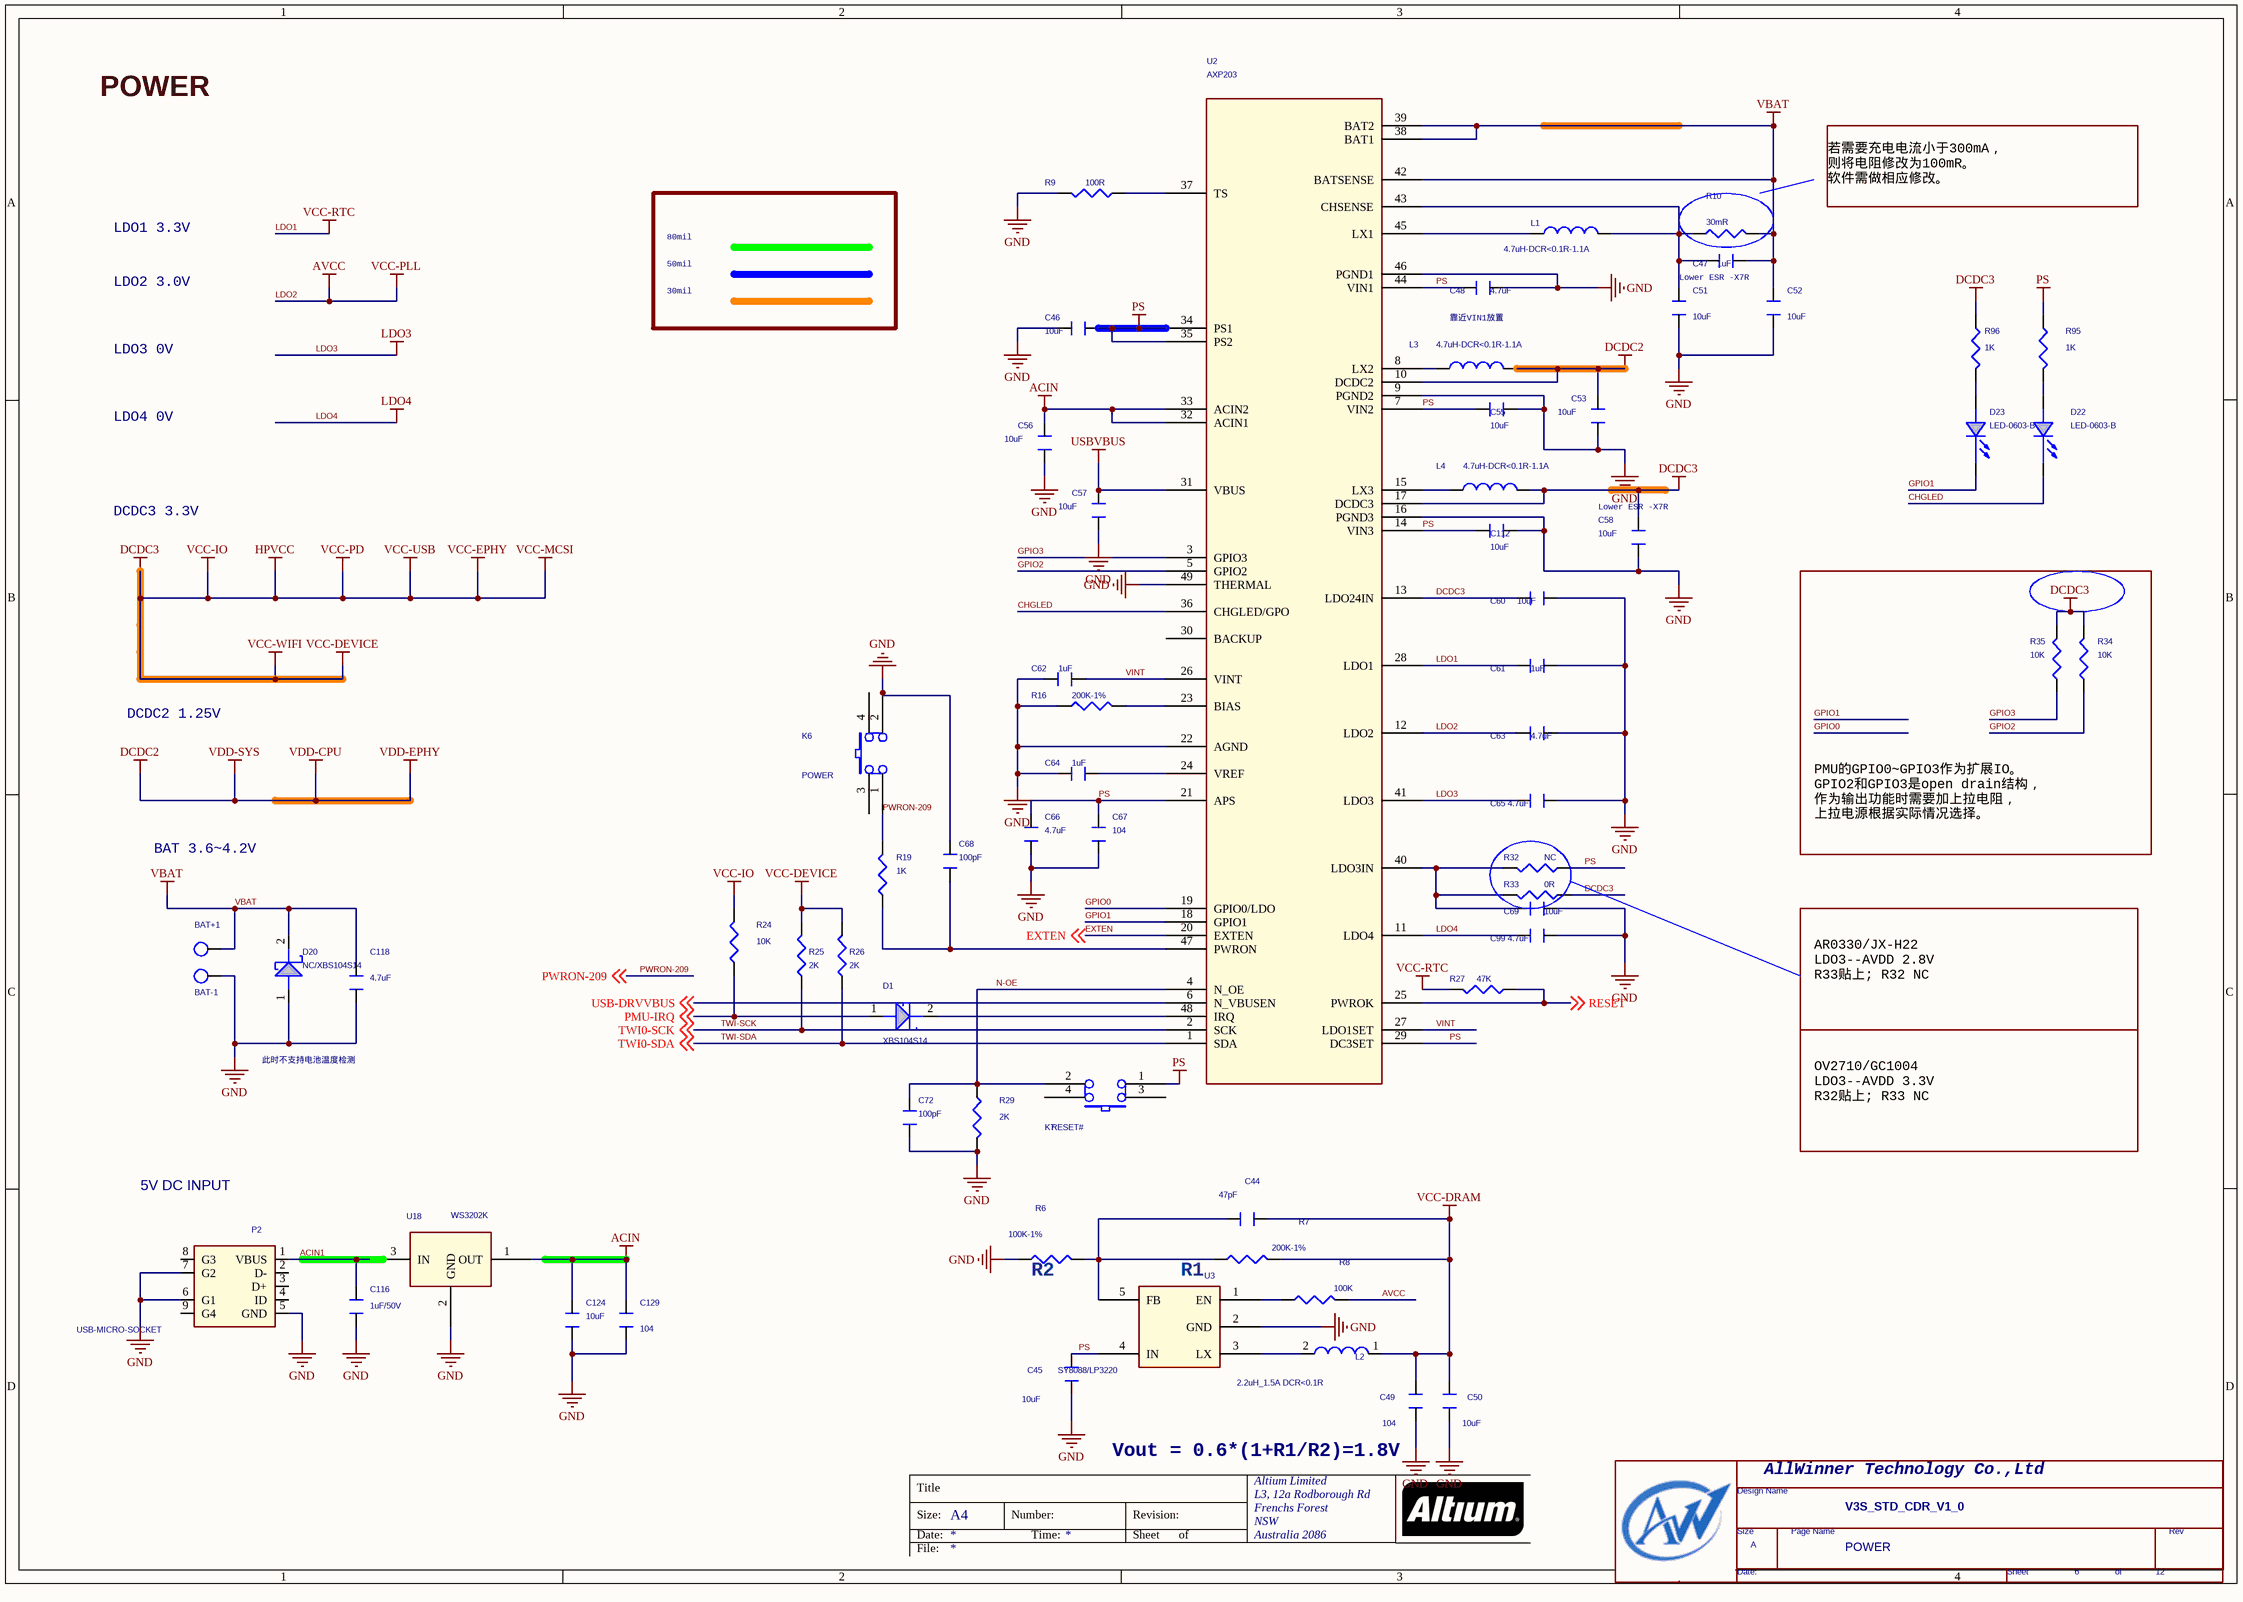
[diagram p5: 06 POWER.SchDoc]

### Parts
(Parts that share a designator on the sheet are numbered #1, #2 ... from top to bottom, then left to right.)
*#6  Page Count: 12  Page Number: 6  Page Size: A  Title: V3S_STD_CDR_V1_0  Doc: POWER  (hidden comment: TitleBlock0-AW)  (graphical)
BAT+1  VCC-3V  [BAT_SMD]  (value not drawn)
BAT-1  VCC-3V  [BAT_SMD]  (value not drawn)
C44  47pF  [C0402]
C45  10uF  [C0603]
C46  10uF  [C0603]
C47  1uF  [C0402]
C48  4.7uF  [C0402]
C49  104  [C0402]
C50  10uF  [C0603]
C51  10uF  [C0603]
C52  10uF  [C0603]
C53  10uF  [C0603]
C55  10uF  [C0603]
C56  10uF  [C0603]
C57  10uF  [C0603]
C58  10uF  [C0603]
C60  10uF  [C0603]
C61  1uF  [C0402]
C62  1uF  [C0402]
C63  4.7uF  [C0402]
C64  1uF  [C0402]
C65  4.7uF  [C0402]
C66  4.7uF  [C0402]
C67  104  [C0402]
C68  100pF  [C0402]
C69  10uF  [C0603]
C72  100pF  [C0402]
C99  4.7uF  [C0402]
C112  10uF  [C0603]
C116  1uF/50V  [C0603]
C118  4.7uF  [C0402]
C124  10uF  [C0603]
C129  104  [C0402]
D1  XBS104S14  [SOD123]
D20  NC/XBS104S14  [SOD123]
D22  LED-0603-B  [0805]
D23  LED-0603-B  [0805]
K6  POWER  [SW4]
K7  RESET#  [SW4]
L1  4.7uH-DCR<0.1R-1.1A  [CD32]
L2  2.2uH_1.5A DCR<0.1R  [CD32]
L3  4.7uH-DCR<0.1R-1.1A  [CD32]
L4  4.7uH-DCR<0.1R-1.1A  [CD32]
P2  USB-MICRO-SOCKET  [USB_MINI_AB]
R6  100K-1%  [R0402]
R7  200K-1%  [R0402]
R8  100K  [R0402]
R9  100R  [R0402]
R10  30mR  [R0603]
R16  200K-1%  [R0402]
R19  1K  [R0402]
R24  10K  [R0402]
R25  2K  [R0402]
R26  2K  [R0402]
R27  47K  [R0402]
R29  2K  [R0402]
R32  NC  [R0402]
R33  0R  [R0402]
R34  10K  [R0402]
R35  10K  [R0402]
R95  1K  [R0402]
R96  1K  [R0402]
U2  AXP203  [QFN48]
U3  SY8088/LP3220  [TSOT-23-6]
U18  WS3202K  [SOT-89-3L]

### Nets
ACIN: C56.1 C124.1 C129.2 U2.32(ACIN1) U2.33(ACIN2) U18.1(OUT)
AVCC: C63.1 R8.1 U2.12(LDO2)  [also labelled LDO2, VCC-PLL]
DCDC2: C53.1 L3.2 U2.10(DCDC2)  [also labelled VDD-CPU, VDD-EPHY, VDD-SYS]
DCDC3: C58.1 C60.1 L4.2 R24.2 R25.2 R26.2 R33.1 R34.2 R35.2 R96.1 U2.13(LDO24IN) U2.17(DCDC3)  [also labelled HPVCC, VCC-DEVICE, VCC-EPHY, VCC-IO, VCC-MCSI, VCC-PD, VCC-USB, VCC-WIFI]
GND: BAT-1.1(TP) C45.2 C46.1 C48.2 C49.2 C50.2 C51.2 C52.2 C53.2 C55.2 C56.2 C57.2 C58.2 C60.2 C61.1 C62.2 C63.2 C64.1 C65.1 C66.2 C67.1 C68.1 C69.2 C72.2 C99.1 C112.2 C116.1 C118.1 C124.2 C129.1 D20.1 K6.2 P2.5(GND) P2.6(G1) P2.7(G2) R6.2 R9.2 R16.1 R29.2 U2.9(PGND2) U2.16(PGND3) U2.22(AGND) U2.46(PGND1) U2.49(THERMAL) U3.2(GND) U18.2(GND)
LDO1: C61.2 R27.2 U2.28(LDO1)  [also labelled VCC-RTC]
LDO3: C65.2 U2.41(LDO3)
LDO4: C99.2 U2.11(LDO4)
PS: C45.1 C46.2 C48.1 C55.1 C66.1 C67.2 C112.1 K7.1 R32.1 R95.1 U2.7(VIN2) U2.14(VIN3) U2.21(APS) U2.29(DC3SET) U2.34(PS1) U2.35(PS2) U2.44(VIN1) U3.4(IN)
RESET: R27.1 U2.25(PWROK) ; off-sheet RESET
USBVBUS: C57.1 U2.31(VBUS)
VBAT: BAT+1.1(TP) C47.2 C52.1 C118.2 D20.2 R10.1 U2.38(BAT1) U2.39(BAT2) U2.42(BATSENSE)
VCC-DRAM: C44.1 C49.1 C50.1 L2.1 R7.1
ACIN1: C116.2 P2.1(VBUS) U18.3(IN)
CHGLED: D22.2(CATHODE) U2.36(CHGLED/GPO)
EXTEN: U2.20(EXTEN) ; off-sheet EXTEN
GPIO0: U2.19(GPIO0/LDO)
GPIO1: D23.2(CATHODE) U2.18(GPIO1)
GPIO2: R34.1 U2.5(GPIO2)
GPIO3: R35.1 U2.3(GPIO3)
N-OE: C72.1 K7.2 R29.1 U2.4(N_OE)
PMU-IRQ: D1.1 R24.1 ; off-sheet PMU-IRQ
PWRON-209: K6.1 R19.2 ; off-sheet PWRON-209
TWI-SCK: R25.1 U2.2(SCK) ; off-sheet TWI0-SCK  [also labelled TWI0-SCK]
TWI-SDA: R26.1 U2.1(SDA) ; off-sheet TWI0-SDA  [also labelled TWI0-SDA]
USB-DRVVBUS: U2.6(N_VBUSEN) ; off-sheet USB-DRVVBUS
VINT: C62.1 U2.26(VINT) U2.27(LDO1SET)
NetC44_2: C44.2 R6.1 R7.2 U3.5(FB)
NetC47_1: C47.1 C51.1 L1.1 R10.2 U2.43(CHSENSE)
NetC64_2: C64.2 U2.24(VREF)
NetC68_2: C68.2 R19.1 U2.47(PWRON)
NetC69_1: C69.1 R32.2 R33.2 U2.40(LDO3IN)
NetD1_2: D1.2 U2.48(IRQ)
NetD22_1: D22.1(ANODE) R95.2
NetD23_1: D23.1(ANODE) R96.2
NetL1_2: L1.2 U2.45(LX1)
NetL2_2: L2.2 U3.3(LX)
NetL3_1: L3.1 U2.8(LX2)
NetL4_1: L4.1 U2.15(LX3)
NetR8_2: R8.2 U3.1(EN)
NetR9_1: R9.1 U2.37(TS)
NetR16_2: R16.2 U2.23(BIAS)

Not connected (* = marked no-connect by the designer): K6 3 4; K7 3 4; P2 2(D-) 3(D+) 4(ID) 8(G3) 9(G4); U2 30(BACKUP)

### Notes on the sheet
- POWER
- 若需要充电电流小于300mA，
  则将电阻修改为100mR。
  软件需做相应修改。
- LDO1 3.3V
- 80mil
- LDO2 3.0V
- 50mil
- 30mil
- 靠近VIN1放置
- Lower ESR -X7R
- LDO3 0V
- LDO4 0V
- DCDC3 3.3V
- (near C58) Lower ESR -X7R
- DCDC2 1.25V
- BAT 3.6~4.2V
- PMU的GPIO0~GPIO3作为扩展IO。
  GPIO2和GPIO3是open drain结构，
  作为输出功能时需要加上拉电阻，
  上拉电源根据实际情况选择。
- AR0330/JX-H22
  LDO3--AVDD 2.8V
  R33贴上; R32 NC
- 此时不支持电池温度检测
- OV2710/GC1004
  LDO3--AVDD 3.3V
  R32贴上; R33 NC
- 5V DC INPUT
- (near R6) R2           R1
- Vout = 0.6*(1+R1/R2)=1.8V
- Title
- Size:
- Date:
- A4
- Number:
- Time:
- Revision:
- Sheet
- of
- File:
- (in symbol TitleBlock0-AW) AllWinner Technology Co.,Ltd; Design Name; Size; Page Name; Rev; Date:; Sheet; of

### Library data of the parts
BAT+1 BAT-1 = T_POINT_R: Page: 7
C44 C49 = CAPACITOR_1: ROOM: DCDC; PAGE: 5
C45 = CAPACITOR_3: PAGE: 5; ROOM: DCDC
C46 C48 C55-C58 C61-C67 C99 C112 C116 = CAPACITOR_0_Dup2: PAGE: 1; ROOM: PMU
C47 C51-C53 C60 C69 = CAPACITOR_0_Dup2: ROOM: PMU; PAGE: 1
C50 = CAPACITOR_3: ROOM: DCDC; PAGE: 5
C68 = CAPACITOR_1: Page: 7; ROOM: PMU
C72 = CAPACITOR_1: ROOM: PMU; Page: 7
C118 C129 = CAPACITOR_Dup1: Page: 7
C124 = CAPACITOR_3: PAGE: 1
D1 = DIODE SCHOTTKY_0: RoHS 1.0 Ampere Schottky Barrier Rectifiers  SOD-123; Page: 7; ROOM: PMU
D20 = DIODE_SCHOTTKY: Page: 7
D22 D23 = LED: Page: 7
K6 = SW_PUSH_1: SDTSourceLibName: C:\WIND95\TEMP\6200.LIB; Page: 7
K7 = SW_PUSH_0: SDTSourceLibName: C:\WIND95\TEMP\6200.LIB; Page: 7
L1 L3 L4 = INDUCTOR_1: ROOM: PMU
L2 = INDUCTOR_Dup1: ROOM: DCDC; PAGE: 5
P2 = USB_MINI_SOCKET_2
R6 R8 = R_Dup4: ROOM: DCDC; PAGE: 5
R7 = R_Dup4: PAGE: 5; ROOM: DCDC
R9 R16 R27 R29 = R_Dup4: ROOM: PMU
R10 = R_Dup2: ROOM: PMU; PAGE: 1
R19 = R_Dup3: Page: 7; ROOM: PMU
R24 R33 R34 = R_Dup4: Page: 7; ROOM: PMU
R25 R26 R32 R35 = R_Dup4: ROOM: PMU; Page: 7
R95 R96 = R_Dup4
U2 = AW1612_0: ROOM: PMU
U3 = RT9293B_0: PAGE: 5; ROOM: DCDC
U18 = WS3202K_0
*#6 = TitleBlock0-AW: Page Create Date: March  8, 1995

## Sheet 07 CAMERA-MIPI.SchDoc
size 420 x 297 mm; Organization: Altium Limited; Address1: L3, 12a Rodborough Rd; Address2: Frenchs Forest; Address3: NSW; Address4: Australia 2086
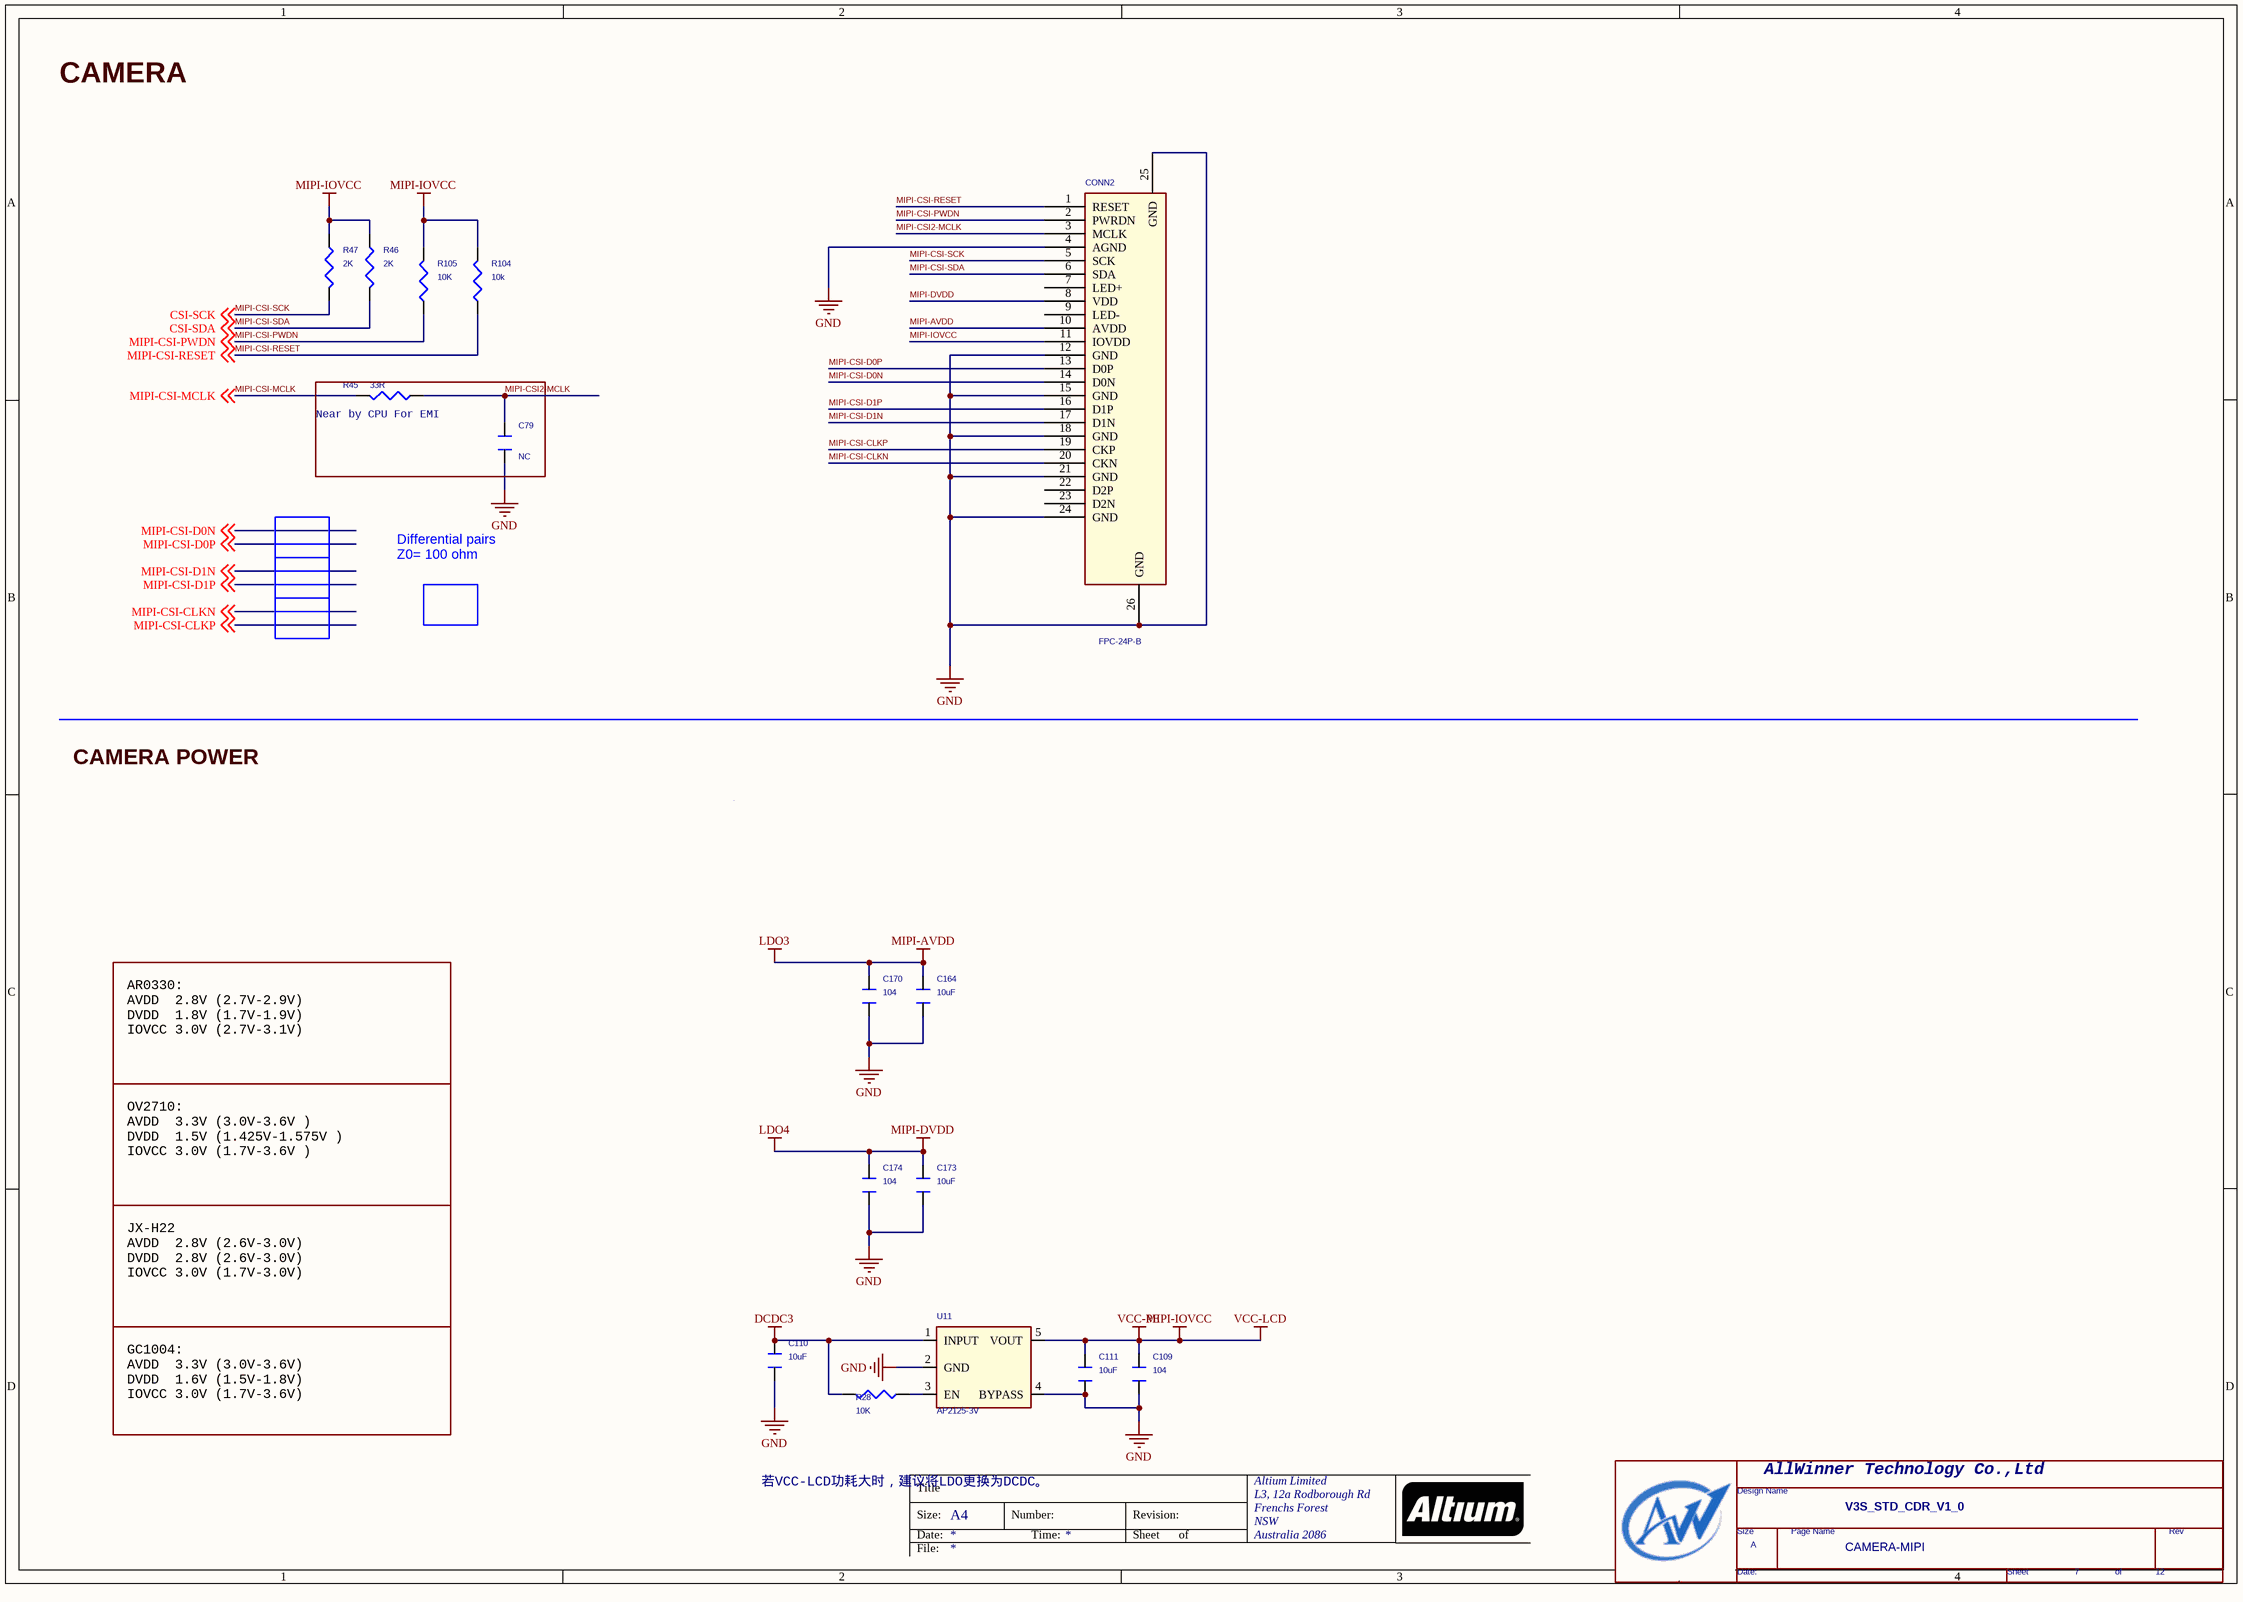
[diagram p6: 07 CAMERA-MIPI.SchDoc]

### Parts
(Parts that share a designator on the sheet are numbered #1, #2 ... from top to bottom, then left to right.)
*#7  Page Count: 12  Page Number: 7  Page Size: A  Title: V3S_STD_CDR_V1_0  Doc: CAMERA-MIPI  (hidden comment: TitleBlock0-AW)  (graphical)
C79  NC  [C0402]
C109  104  [C0402]
C110  10uF  [C0603]
C111  10uF  [C0603]
C164  10uF  [C0603]
C170  104  [C0402]
C173  10uF  [C0603]
C174  104  [C0402]
CONN2  FPC-24P-B  [CON40]
R28  10K  [R0402]
R45  33R  [R0603]
R46  2K  [R0402]
R47  2K  [R0402]
R104  10k  [R0402]
R105  10K  [R0402]
U11  AP2125-3V  [SOT23-5]

### Blocks framed on the sheet
Near by CPU For EMI: C79 R45

### Nets
DCDC3: C110.1 R28.2 U11.1(INPUT)
GND: C79.1 C109.1 C110.2 C111.2 C164.2 C170.1 C173.2 C174.1 CONN2.4(AGND) CONN2.12(GND) CONN2.15(GND) CONN2.18(GND) CONN2.21(GND) CONN2.24(GND) CONN2.25(GND) CONN2.26(GND) U11.2(GND) U11.4(BYPASS)
LDO3: C164.1 C170.2 CONN2.10(AVDD)  [also labelled MIPI-AVDD]
LDO4: C173.1 C174.2 CONN2.8(VDD)  [also labelled MIPI-DVDD]
MIPI-IOVCC: C109.2 C111.1 CONN2.11(IOVDD) R46.1 R47.1 R104.2 R105.2 U11.5(VOUT)  [also labelled VCC-LCD, VCC-PE]
CSI-SCK: CONN2.5(SCK) R47.2 ; off-sheet CSI-SCK  [also labelled MIPI-CSI-SCK]
CSI-SDA: CONN2.6(SDA) R46.2 ; off-sheet CSI-SDA  [also labelled MIPI-CSI-SDA]
MIPI-CSI2-MCLK: C79.2 CONN2.3(MCLK) R45.1
MIPI-CSI-CLKN: CONN2.20(CKN) ; off-sheet MIPI-CSI-CLKN
MIPI-CSI-CLKP: CONN2.19(CKP) ; off-sheet MIPI-CSI-CLKP
MIPI-CSI-D0N: CONN2.14(D0N) ; off-sheet MIPI-CSI-D0N
MIPI-CSI-D0P: CONN2.13(D0P) ; off-sheet MIPI-CSI-D0P
MIPI-CSI-D1N: CONN2.17(D1N) ; off-sheet MIPI-CSI-D1N
MIPI-CSI-D1P: CONN2.16(D1P) ; off-sheet MIPI-CSI-D1P
MIPI-CSI-MCLK: R45.2 ; off-sheet MIPI-CSI-MCLK
MIPI-CSI-PWDN: CONN2.2(PWRDN) R105.1 ; off-sheet MIPI-CSI-PWDN
MIPI-CSI-RESET: CONN2.1(RESET) R104.1 ; off-sheet MIPI-CSI-RESET
NetR28_1: R28.1 U11.3(EN)

Not connected (* = marked no-connect by the designer): CONN2 7(LED+) 9(LED-) 22(D2P) 23(D2N)

### Notes on the sheet
- CAMERA
- Differential pairs
  Z0= 100 ohm
- CAMERA POWER
- AR0330:
  AVDD  2.8V (2.7V-2.9V)
  DVDD  1.8V (1.7V-1.9V)
  IOVCC 3.0V (2.7V-3.1V)
- OV2710:
  AVDD  3.3V (3.0V-3.6V )
  DVDD  1.5V (1.425V-1.575V )
  IOVCC 3.0V (1.7V-3.6V )
- JX-H22
  AVDD  2.8V (2.6V-3.0V)
  DVDD  2.8V (2.6V-3.0V)
  IOVCC 3.0V (1.7V-3.0V)
- GC1004:
  AVDD  3.3V (3.0V-3.6V)
  DVDD  1.6V (1.5V-1.8V)
  IOVCC 3.0V (1.7V-3.6V)
- 若VCC-LCD功耗大时，建议将LDO更换为DCDC。
- Title
- Size:
- Date:
- A4
- Number:
- Time:
- Revision:
- Sheet
- of
- File:
- (in symbol TitleBlock0-AW) AllWinner Technology Co.,Ltd; Design Name; Size; Page Name; Rev; Date:; Sheet; of

### Library data of the parts
C79 = CAPACITOR_0_Dup5: PAGE: 2
C109 = CAPACITOR_0_Dup5: PAGE: 5
C110 C111 = CAPACITOR_2: PAGE: 5
C164 C173 = CAPACITOR_2: PAGE: 4
C170 C174 = CAPACITOR_0_Dup5: PAGE: 4
CONN2 = TD030673_2: Page: 10
R28 = R_Dup4: Page: 7; ROOM: PMU
R45 = RESISTOR_0
R46 R47 = R_Dup4
R104 R105 = R_Dup3: PAGE: 4
U11 = LP3985IM5-3_2.3: PAGE: 5
*#7 = TitleBlock0-AW: Page Create Date: March  8, 1995

## Sheet 08 Serial RGB LCD.SchDoc
size 420 x 297 mm; Organization: Altium Limited; Address1: L3, 12a Rodborough Rd; Address2: Frenchs Forest; Address3: NSW; Address4: Australia 2086
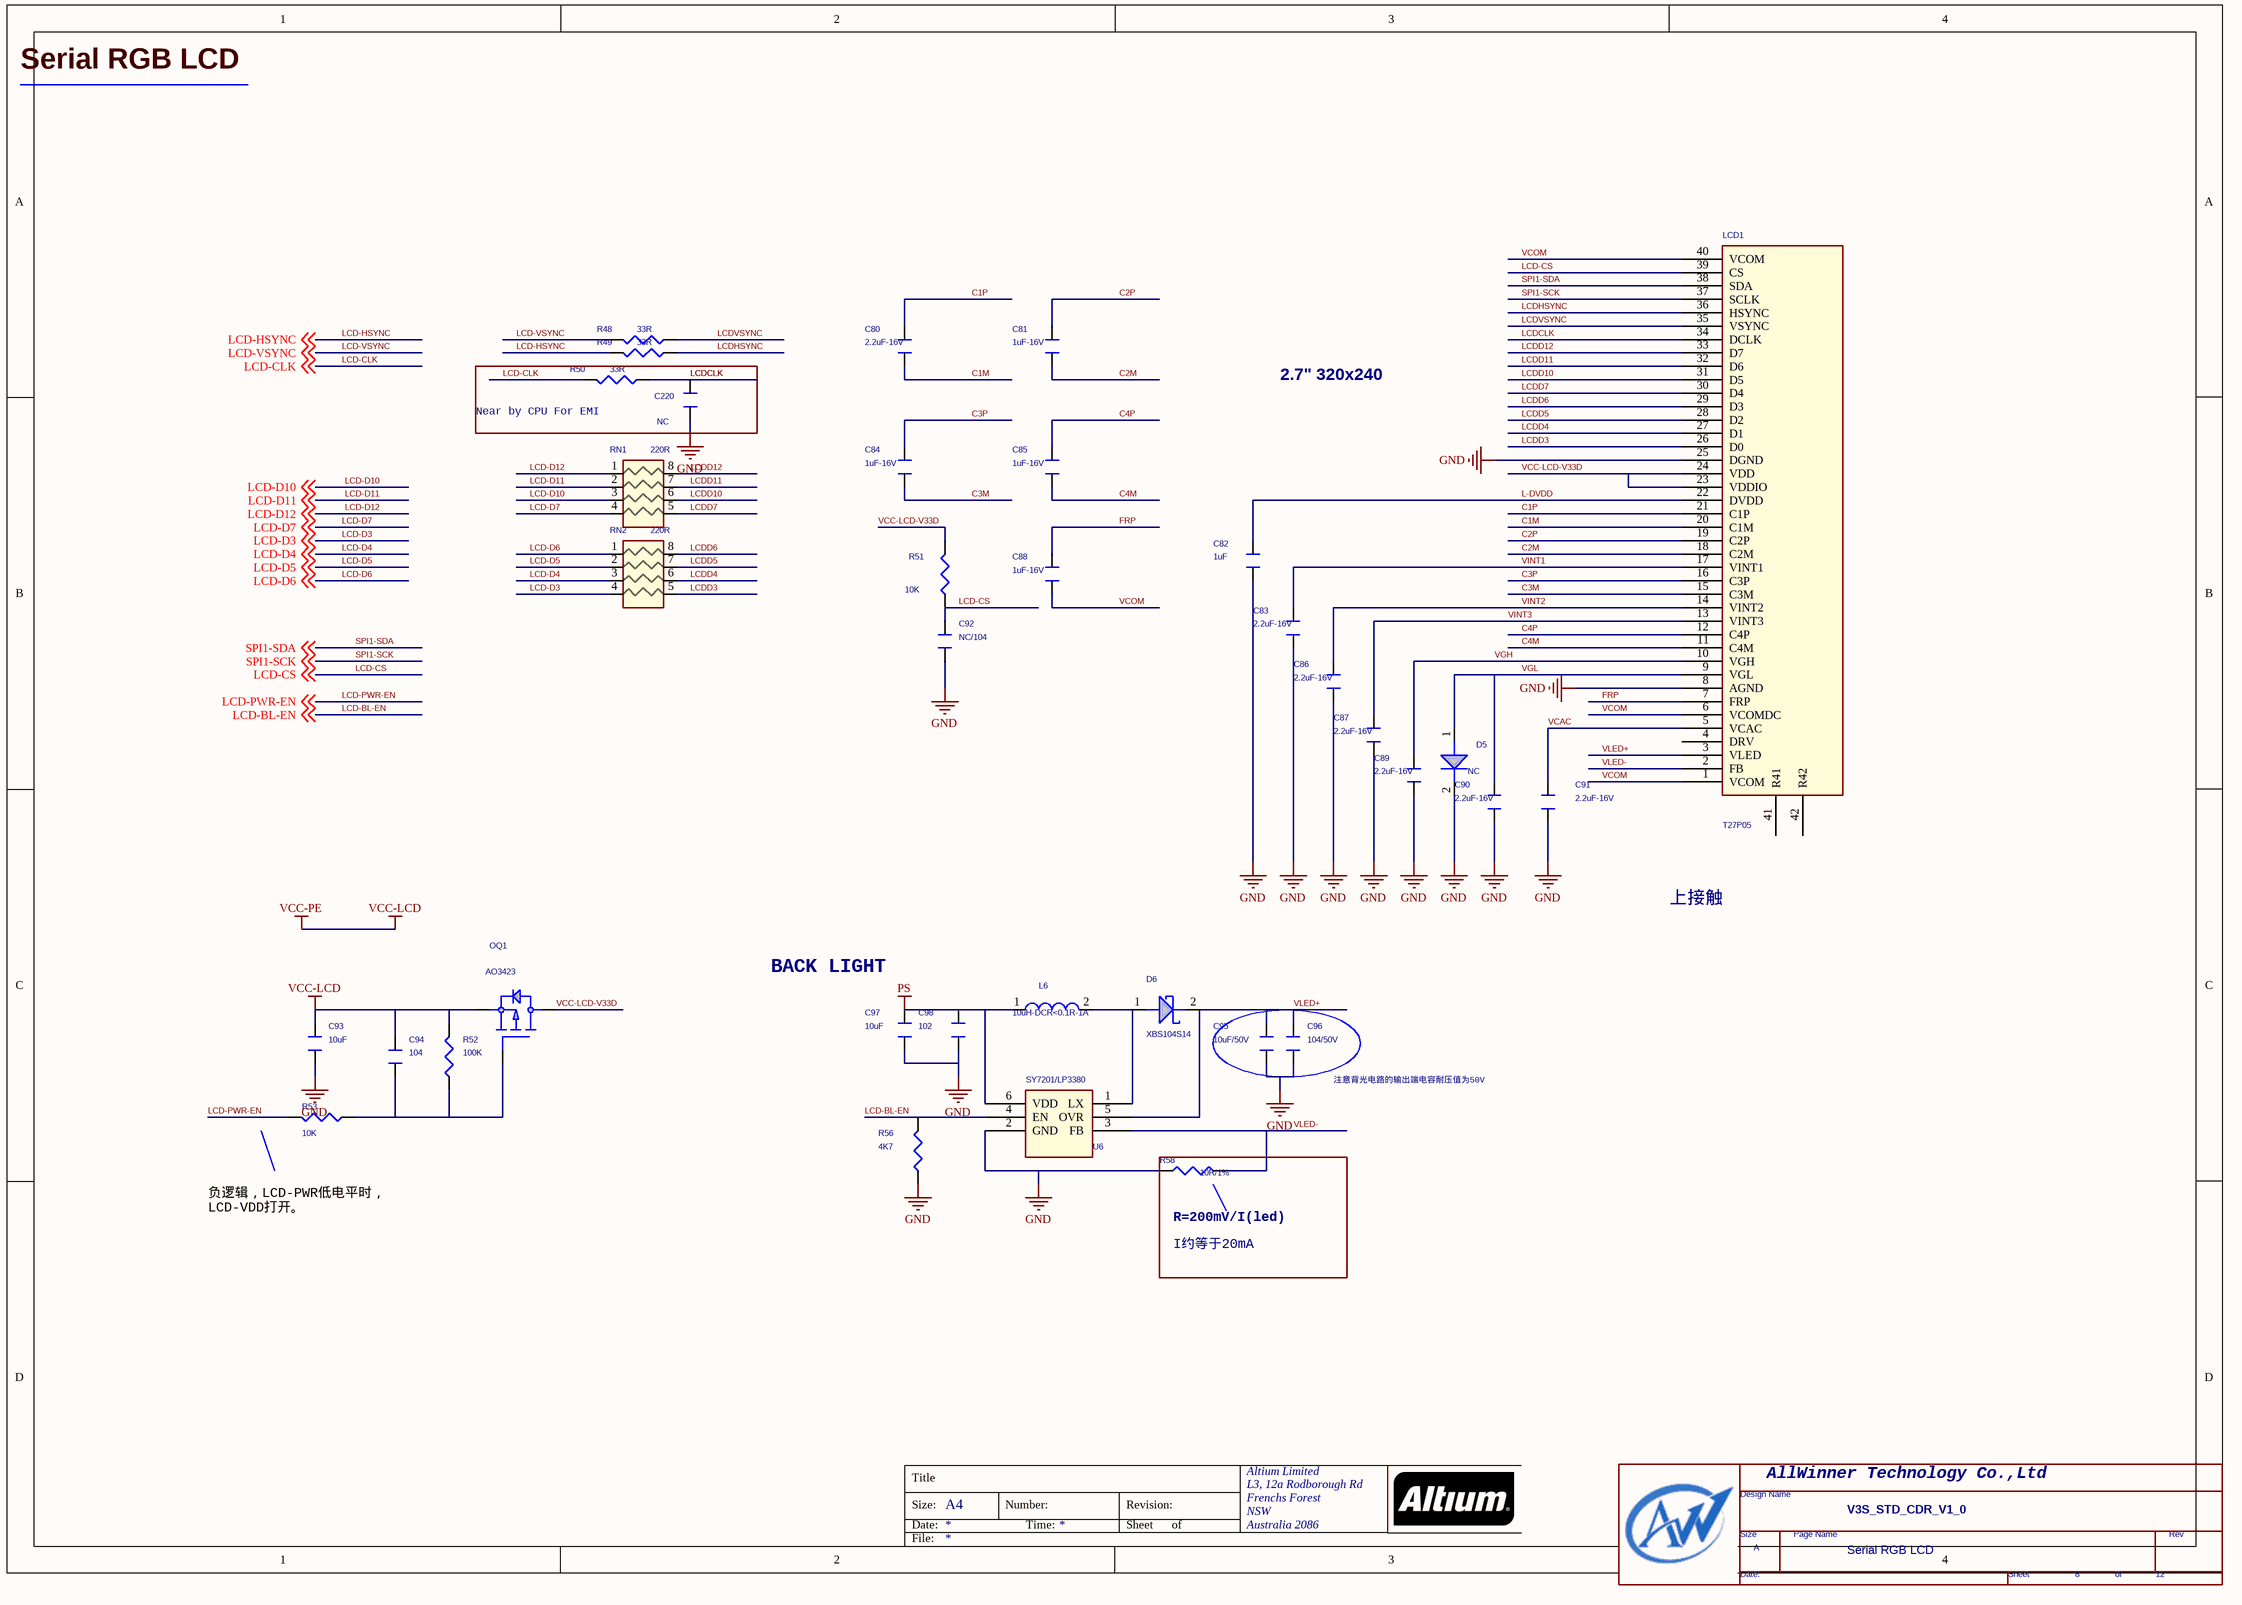
[diagram p7: 08 Serial RGB LCD.SchDoc]

### Parts
(Parts that share a designator on the sheet are numbered #1, #2 ... from top to bottom, then left to right.)
*#8  Page Count: 12  Page Number: 8  Page Size: A  Title: V3S_STD_CDR_V1_0  Doc: Serial RGB LCD  (hidden comment: TitleBlock0-AW)  (graphical)
C80  2.2uF-16V  [C0402]
C81  1uF-16V  [C0402]
C82  1uF  [C0402]
C83  2.2uF-16V  [C0402]
C84  1uF-16V  [C0402]
C85  1uF-16V  [C0402]
C86  2.2uF-16V  [C0402]
C87  2.2uF-16V  [C0402]
C88  1uF-16V  [C0402]
C89  2.2uF-16V  [C0402]
C90  2.2uF-16V  [C0402]
C91  2.2uF-16V  [C0402]
C92  NC/104  [C0402]
C93  10uF  [C0603]
C94  104  [C0402]
C95  10uF/50V  [C0805]
C96  104/50V  [C0603]
C97  10uF  [C0603]
C98  102  [C0402]
C220  NC  [C0402]
D5  NC  [SOD123]
D6  XBS104S14  [SOD123]
L6  10uH-DCR<0.1R-1A  [CD32]
LCD1  T27P05  [FPC40PIN-0.5MM]
OQ1  AO3423  [SOT-23]
R48  33R  [R0402]
R49  33R  [R0402]
R50  33R  [R0402]
R51  10K  [R0402]
R52  100K  [R0402]
R53  10K  [R0402]
R56  4K7  [R0402]
R58  10R/1%  [R0402]
RN1  220R  [RN0402]
RN2  220R  [RN0402]
U6  SY7201/LP3380  [SOT23-6]

### Blocks framed on the sheet
Near by CPU For EMI: C220 R50

### Nets
GND: C82.1 C83.1 C86.1 C87.1 C89.1 C90.1 C91.1 C92.1 C93.1 C95.1 C96.1 C97.1 C98.1 C220.2 D5.2 LCD1.8(AGND) LCD1.25(DGND) R56.1 R58.2 U6.2(GND)
PS: C97.2 C98.2 L6.1 U6.6(VDD)
VCC-LCD: C93.2 C94.2 OQ1.2(SOURCE) R52.2  [also labelled VCC-PE]  [project net MIPI-IOVCC]
C1M: C80.1 LCD1.20(C1M)
C1P: C80.2 LCD1.21(C1P)
C2M: C81.1 LCD1.18(C2M)
C2P: C81.2 LCD1.19(C2P)
C3M: C84.1 LCD1.15(C3M)
C3P: C84.2 LCD1.16(C3P)
C4M: C85.1 LCD1.11(C4M)
C4P: C85.2 LCD1.12(C4P)
FRP: C88.2 LCD1.7(FRP)
L-DVDD: C82.2 LCD1.22(DVDD)
LCD-BL-EN: R56.2 U6.4(EN) ; off-sheet LCD-BL-EN
LCD-CLK: R50.2 ; off-sheet LCD-CLK
LCD-CS: C92.2 LCD1.39(CS) R51.2 ; off-sheet LCD-CS
LCD-D3: RN2.4 ; off-sheet LCD-D3
LCD-D4: RN2.3 ; off-sheet LCD-D4
LCD-D5: RN2.2 ; off-sheet LCD-D5
LCD-D6: RN2.1 ; off-sheet LCD-D6
LCD-D7: RN1.4 ; off-sheet LCD-D7
LCD-D10: RN1.3 ; off-sheet LCD-D10
LCD-D11: RN1.2 ; off-sheet LCD-D11
LCD-D12: RN1.1 ; off-sheet LCD-D12
LCD-HSYNC: R49.2 ; off-sheet LCD-HSYNC
LCD-PWR-EN: R53.2 ; off-sheet LCD-PWR-EN  [project net LCD-D14]
LCD-VSYNC: R48.2 ; off-sheet LCD-VSYNC
LCDCLK: C220.1 LCD1.34(DCLK) R50.1
LCDD3: LCD1.26(D0) RN2.5
LCDD4: LCD1.27(D1) RN2.6
LCDD5: LCD1.28(D2) RN2.7
LCDD6: LCD1.29(D3) RN2.8
LCDD7: LCD1.30(D4) RN1.5
LCDD10: LCD1.31(D5) RN1.6
LCDD11: LCD1.32(D6) RN1.7
LCDD12: LCD1.33(D7) RN1.8
LCDHSYNC: LCD1.36(HSYNC) R49.1
LCDVSYNC: LCD1.35(VSYNC) R48.1
SPI1-SCK: LCD1.37(SCLK) ; off-sheet SPI1-SCK  [project net LCD-D18]
SPI1-SDA: LCD1.38(SDA) ; off-sheet SPI1-SDA  [project net LCD-D19]
VCAC: C91.2 LCD1.5(VCAC)
VCC-LCD-V33D: LCD1.23(VDDIO) LCD1.24(VDD) OQ1.3(DRAIN) R51.1
VCOM: C88.1 LCD1.1(VCOM) LCD1.6(VCOMDC) LCD1.40(VCOM)
VGH: C89.2 LCD1.10(VGH)
VGL: C90.2 D5.1 LCD1.9(VGL)
VINT1: C83.2 LCD1.17(VINT1)
VINT2: C86.2 LCD1.14(VINT2)
VINT3: C87.2 LCD1.13(VINT3)
VLED+: C95.2 C96.2 D6.2 LCD1.3(VLED) U6.5(OVR)
VLED-: LCD1.2(FB) R58.1 U6.3(FB)
NetC94_1: C94.1 OQ1.1(GATE) R52.1 R53.1
NetD6_1: D6.1 L6.2 U6.1(LX)

Not connected (* = marked no-connect by the designer): LCD1 4(DRV) 41(R41) 42(R42)

### Notes on the sheet
- Serial RGB LCD
- 2.7" 320x240
- 上接触
- BACK LIGHT
- 注意背光电路的输出端电容耐压值为50V
- 负逻辑，LCD-PWR低电平时，
  LCD-VDD打开。
- (near R58) R=200mV/I(led)
- I约等于20mA
- Title
- Size:
- Date:
- A4
- Number:
- Time:
- Revision:
- Sheet
- of
- File:
- (in symbol TitleBlock0-AW) AllWinner Technology Co.,Ltd; Design Name; Size; Page Name; Rev; Date:; Sheet; of

### Library data of the parts
*#8 = TitleBlock0-AW: RevCode: 0.1; Page Create Date: March  8, 1995
C80 C82-C84 C87 C97 C98 = CAPACITOR_0_Dup5: mypage: 09; Page: 10
C81 C85 C86 C88-C91 C95 C96 = CAPACITOR_0_Dup5: Page: 10; mypage: 09
C92-C94 = CAPACITOR_Dup1: Page: 10
C220 = CAPACITOR_1: ROOM: DCDC; PAGE: 5
D5 = DIODE SCHOTTKY_0_Dup1: Value2: NC
D6 = DIODE SCHOTTKY: RoHS 1.0 Ampere Schottky Barrier Rectifiers  SOD-123; Page: 10
L6 = INDUCTOR: RoHS Power Inductor 22uH 300mA H<1.8MM,CD32; mypage: 09; Page: 10
LCD1 = LCD-TD043MGEB1_0
OQ1 = PMOS: Page: 10
R48-R50 = R_Dup4
R51 = RESISTOR_5: Page: 10
R52 R53 = R_Dup3: Page: 10
R56 = RESISTOR_Dup2: Page: 10; mypage: 09
R58 = RESISTOR_Dup2: mypage: 09; Page: 10
RN1 RN2 = 742C083/SM_0
U6 = AP3031: Page: 10

## Sheet 09 NOR NANDFlash_TF Car.SchDoc
size 420 x 297 mm; Organization: Altium Limited; Address1: L3, 12a Rodborough Rd; Address2: Frenchs Forest; Address3: NSW; Address4: Australia 2086
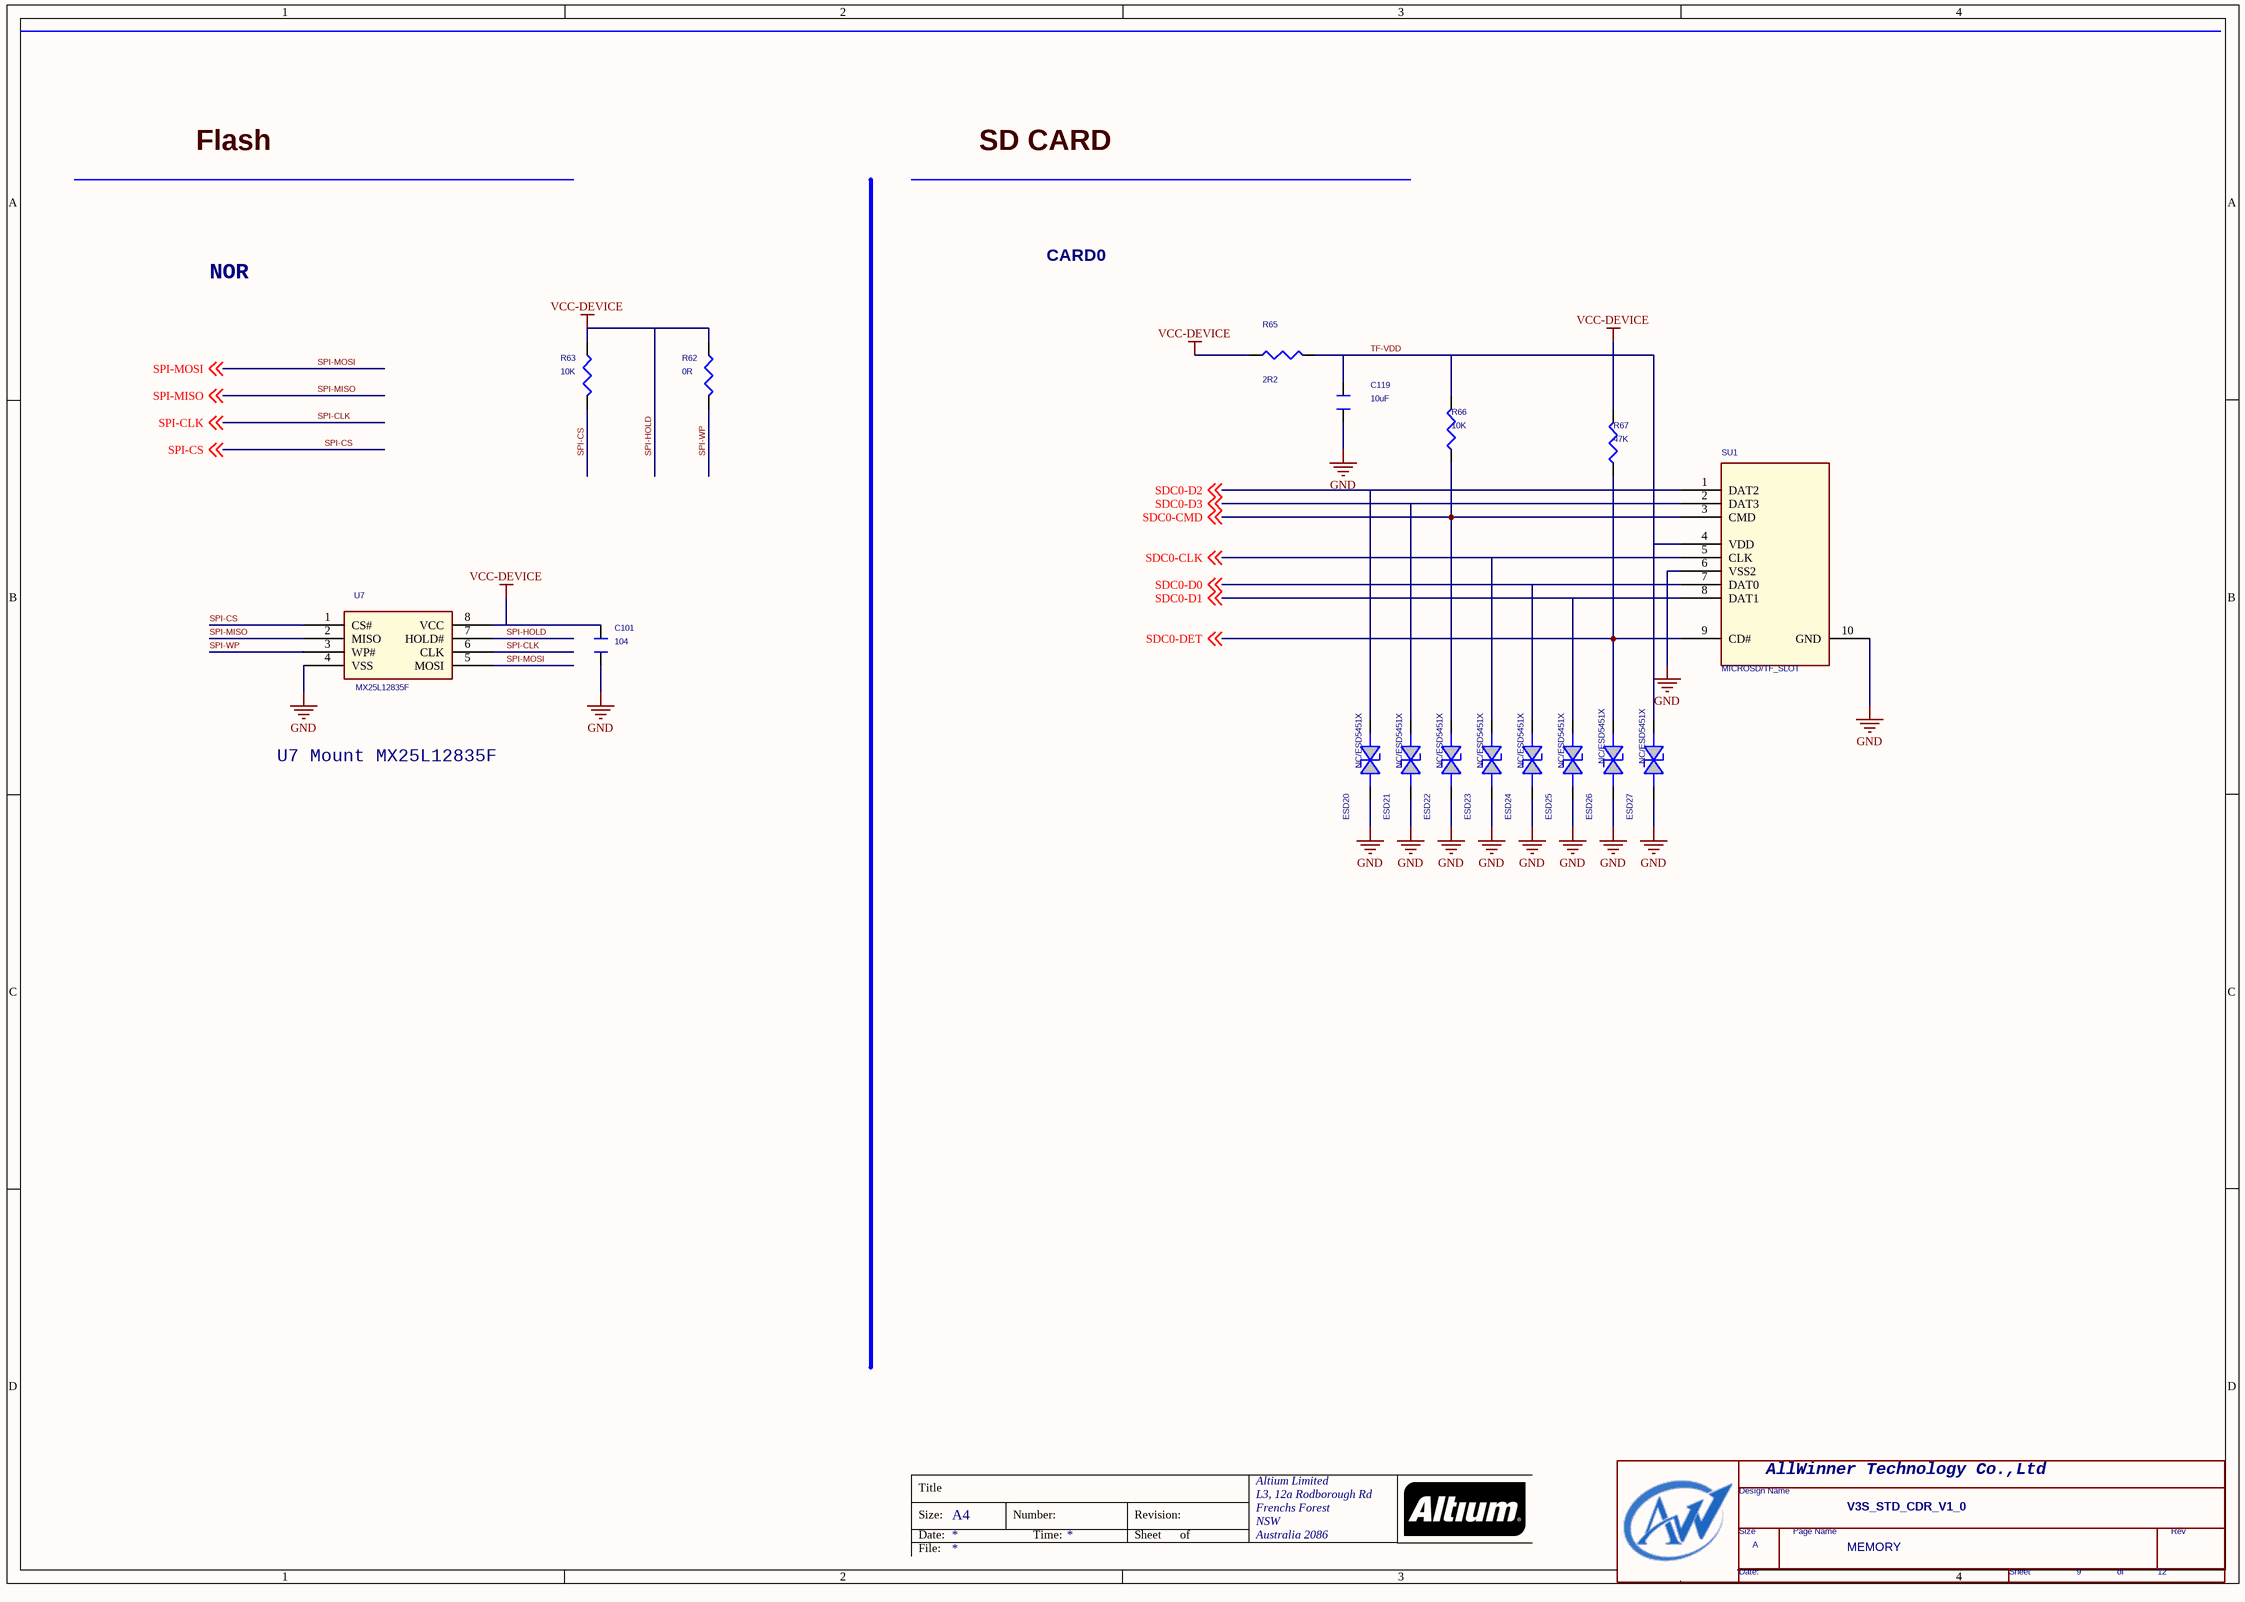
[diagram p8: 09 NOR NANDFlash_TF Car.SchDoc]

### Parts
(Parts that share a designator on the sheet are numbered #1, #2 ... from top to bottom, then left to right.)
*#9  Page Count: 12  Page Number: 9  Page Size: A  Title: V3S_STD_CDR_V1_0  Doc: MEMORY  (hidden comment: TitleBlock0-AW)  (graphical)
C101  104  [C0402]
C119  10uF  [C0603]
ESD20  NC/ESD5451X  [ESD0402]
ESD21  NC/ESD5451X  [ESD0402]
ESD22  NC/ESD5451X  [ESD0402]
ESD23  NC/ESD5451X  [ESD0402]
ESD24  NC/ESD5451X  [ESD0402]
ESD25  NC/ESD5451X  [ESD0402]
ESD26  NC/ESD5451X  [ESD0402]
ESD27  NC/ESD5451X  [ESD0402]
R62  0R  [R0402]
R63  10K  [R0402]
R65  2R2  [R0402]
R66  10K  [R0402]
R67  47K  [R0402]
SU1  MICROSD/TF_SLOT  [MICRO-SD-TF]
U7  MX25L12835F  [SOIC-8]

### Nets
GND: C101.1 C119.1 ESD20.2(CATHODE) ESD21.2(CATHODE) ESD22.2(CATHODE) ESD23.2(CATHODE) ESD24.2(CATHODE) ESD25.2(CATHODE) ESD26.2(CATHODE) ESD27.2(CATHODE) SU1.6(VSS2) SU1.10(GND) U7.4(VSS)
SPI-HOLD: C101.2 R62.1 R63.1 R65.1 R67.2 U7.7(HOLD#) U7.8(VCC)  [also labelled VCC-DEVICE]  [project net DCDC3]
SDC0-CLK: ESD23.1(ANODE) SU1.5(CLK) ; off-sheet SDC0-CLK
SDC0-CMD: ESD22.1(ANODE) R66.1 SU1.3(CMD) ; off-sheet SDC0-CMD
SDC0-D0: ESD24.1(ANODE) SU1.7(DAT0) ; off-sheet SDC0-D0
SDC0-D1: ESD25.1(ANODE) SU1.8(DAT1) ; off-sheet SDC0-D1
SDC0-D2: ESD20.1(ANODE) SU1.1(DAT2) ; off-sheet SDC0-D2
SDC0-D3: ESD21.1(ANODE) SU1.2(DAT3) ; off-sheet SDC0-D3
SDC0-DET: ESD26.1(ANODE) R67.1 SU1.9(CD#) ; off-sheet SDC0-DET
SPI-CLK: U7.6(CLK) ; off-sheet SPI-CLK
SPI-CS: R63.2 U7.1(CS#) ; off-sheet SPI-CS
SPI-MISO: U7.2(MISO) ; off-sheet SPI-MISO
SPI-MOSI: U7.5(MOSI) ; off-sheet SPI-MOSI
SPI-WP: R62.2 U7.3(WP#)
TF-VDD: C119.2 ESD27.1(ANODE) R65.2 R66.2 SU1.4(VDD)

### Notes on the sheet
- Flash
- SD CARD
- CARD0
- NOR
- U7 Mount MX25L12835F
- Title
- Size:
- Date:
- A4
- Number:
- Time:
- Revision:
- Sheet
- of
- File:
- (in symbol TitleBlock0-AW) AllWinner Technology Co.,Ltd; Design Name; Size; Page Name; Rev; Date:; Sheet; of

### Library data of the parts
*#9 = TitleBlock0-AW: RevCode: 0.1; Page Create Date: March  8, 1995
C101 = CAPACITOR_Dup1: PAGE: 7
C119 = CAPACITOR_Dup1
ESD20-ESD27 = 1_1.5KE100A: 1ST PART DESCRIPTION: WILL ESD9B5V Bidirection ESD Protection; Page: 11
R62 R63 = RESISTOR_Dup1: PAGE: 7
R65 = RESISTOR_Dup1: PAGE: 3
R66 R67 = R_Dup3
SU1 = SDMMC SLOT_11
U7 = SPI-NOR-SO8: PAGE: 7

## Sheet 10 Speaker_Microphone.SchDoc
size 420 x 297 mm; Organization: Altium Limited; Address1: L3, 12a Rodborough Rd; Address2: Frenchs Forest; Address3: NSW; Address4: Australia 2086
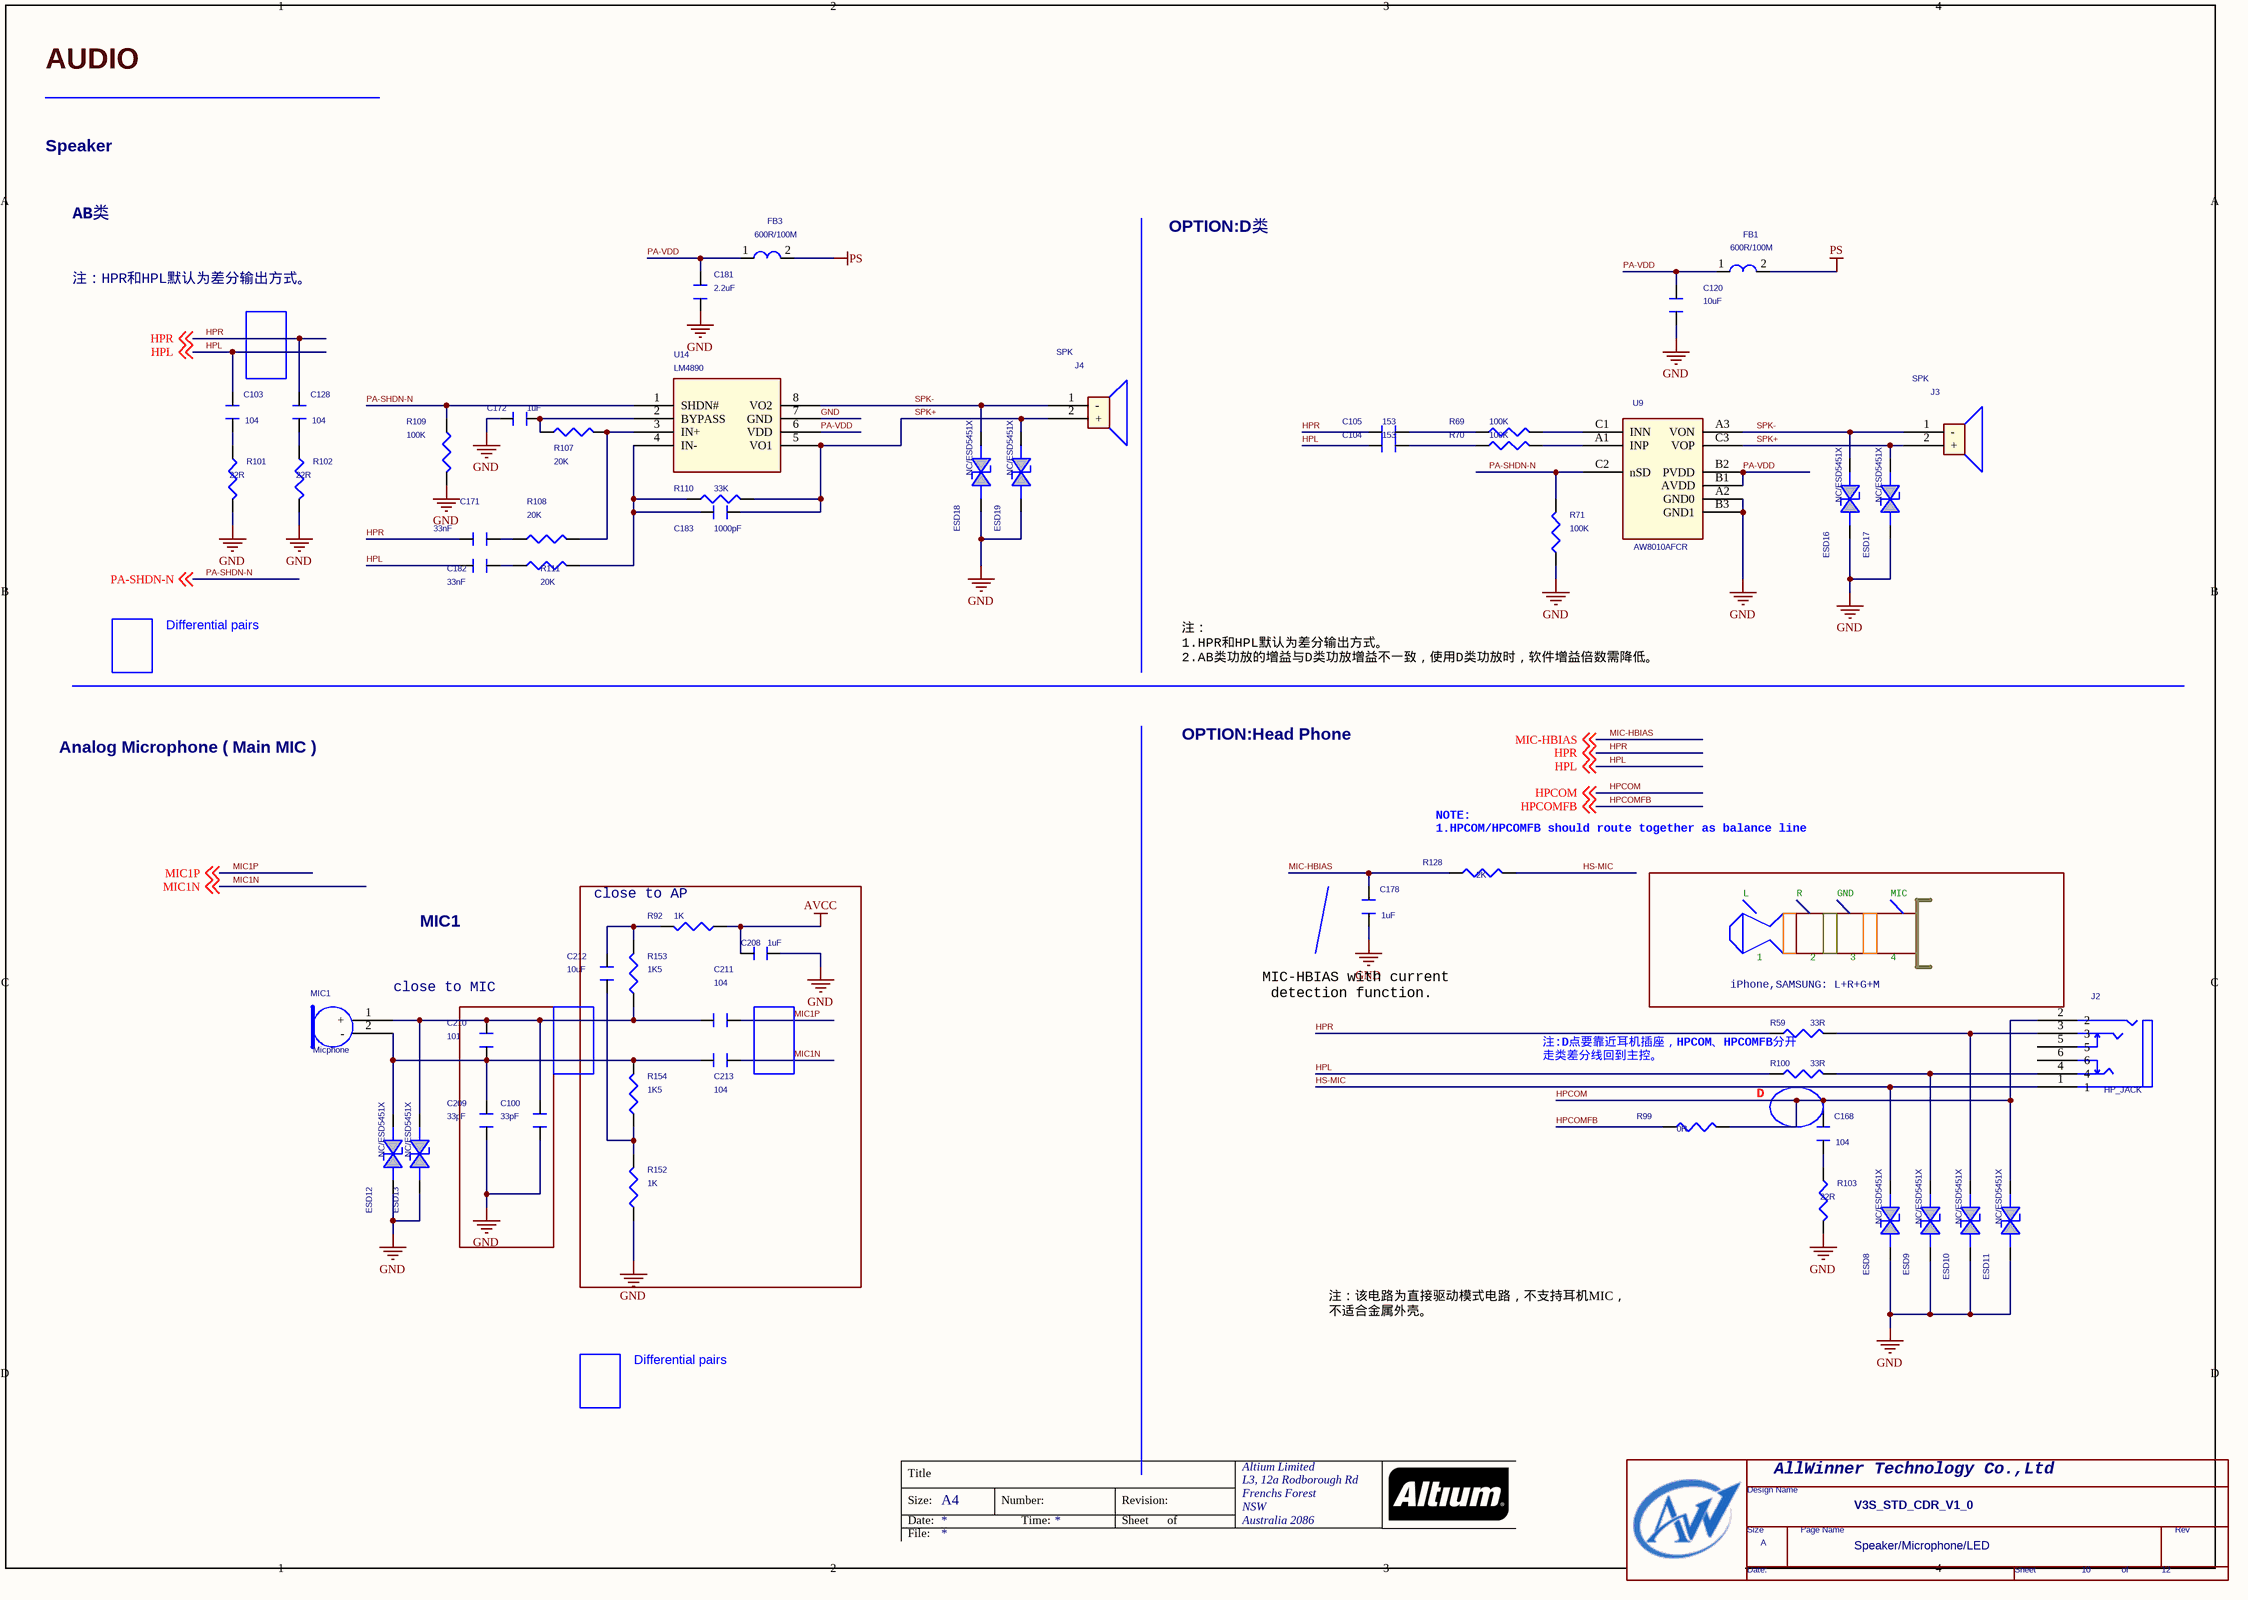
[diagram p9: 10 Speaker_Microphone.SchDoc]

### Parts
(Parts that share a designator on the sheet are numbered #1, #2 ... from top to bottom, then left to right.)
*#10  Page Count: 12  Page Number: 10  Page Size: A  Title: V3S_STD_CDR_V1_0  Doc: Speaker/Microphone/LED  (hidden comment: TitleBlock0-AW)  (graphical)
C100  33pF  [C0402]
C103  104  [C0402]
C104  153  [C0402]
C105  153  [C0402]
C120  10uF  [C0603]
C128  104  [C0402]
C168  104  [C0402]
C171  33nF  [C0402]
C172  1uF  [C0402]
C178  1uF  [C0402]
C181  2.2uF  [C0402]
C182  33nF  [C0402]
C183  1000pF  [C0402]
C208  1uF  [C0402]
C209  33pF  [C0402]
C210  101  [C0402]
C211  104  [C0402]
C212  10uF  [C0603]
C213  104  [C0402]
ESD8  NC/ESD5451X  [ESD0402]
ESD9  NC/ESD5451X  [ESD0402]
ESD10  NC/ESD5451X  [ESD0402]
ESD11  NC/ESD5451X  [ESD0402]
ESD12  NC/ESD5451X  [ESD0402]
ESD13  NC/ESD5451X  [ESD0402]
ESD16  NC/ESD5451X  [ESD0402]
ESD17  NC/ESD5451X  [ESD0402]
ESD18  NC/ESD5451X  [ESD0402]
ESD19  NC/ESD5451X  [ESD0402]
FB1  600R/100M  [L0603]
FB3  600R/100M  [L0603]
J2  HP_JACK  [EAR-JACK-3-5]
J3  SPK  [Phone Connector]
J4  SPK  [Phone Connector]
MIC1  Micphone  [Micphone Connector]
R59  33R  [R0805]
R69  100K  [R0402]
R70  100K  [R0402]
R71  100K  [R0402]
R92  1K  [R0402]
R99  0R  [0805]
R100  33R  [R0805]
R101  22R  [0805]
R102  22R  [0805]
R103  22R  [0805]
R107  20K  [R0402]
R108  20K  [R0402]
R109  100K  [R0402]
R110  33K  [R0402]
R111  20K  [R0402]
R128  2K  [R0402]
R152  1K  [R0402]
R153  1K5  [R0402]
R154  1K5  [R0402]
U9  AW8010AFCR  [CSP9]
U14  LM4890  [MSOP8]

### Blocks framed on the sheet
close to AP: C208 C211-C213 R92 R152-R154

### Nets
AVCC: C208.2 R92.1
GND: C100.1 C120.1 C172.1 C178.1 C181.1 C208.1 C209.1 ESD8.2(CATHODE) ESD9.2(CATHODE) ESD10.2(CATHODE) ESD11.2(CATHODE) ESD12.2(CATHODE) ESD13.2(CATHODE) ESD16.2(CATHODE) ESD17.2(CATHODE) ESD18.2(CATHODE) ESD19.2(CATHODE) R71.1 R101.1 R102.1 R103.1 R109.2 R152.1 U9.A2(GND0) U9.B3(GND1) U14.7(GND)
PS: FB1.2 FB3.2
HPCOM: C168.2 ESD11.1(ANODE) J2.2 R99.1 ; off-sheet HPCOM
HPCOMFB: R99.2 ; off-sheet HPCOMFB  [project net HPCOMBP]
HPL: C103.2 C104.2 C182.1 R100.1 ; off-sheet HPL
HPR: C105.2 C128.2 C171.1 R59.1 ; off-sheet HPR  [project net HPOUTR]
HS-MIC: ESD8.1(ANODE) J2.1 R128.1
MIC1N: C213.1 ; off-sheet MIC1N
MIC1P: C211.1 ; off-sheet MIC1P
MIC-HBIAS: C178.2 R128.2 ; off-sheet MIC-HBIAS  [project net HBIAS]
PA-SHDN-N: R71.2 R109.1 U9.C2(nSD) U14.1(SHDN#) ; off-sheet PA-SHDN-N
PA-VDD: C120.2 C181.2 FB1.1 FB3.1 U9.B1(AVDD) U9.B2(PVDD) U14.6(VDD)
SPK+: C183.2 ESD17.1(ANODE) ESD19.1(ANODE) J3.2(+) J4.2(+) R110.2 U9.C3(VOP) U14.5(VO1)
SPK-: ESD16.1(ANODE) ESD18.1(ANODE) J3.1(-) J4.1(-) U9.A3(VON) U14.8(VO2)
NetC100_2: C100.2 C210.2 C211.2 ESD13.1(ANODE) MIC1.1(+) R153.1
NetC103_1: C103.1 R101.2
NetC104_1: C104.1 R70.1
NetC105_1: C105.1 R69.1
NetC128_1: C128.1 R102.2
NetC168_1: C168.1 R103.2
NetC171_2: C171.2 R108.1
NetC172_2: C172.2 R107.1 U14.2(BYPASS)
NetC182_2: C182.2 R111.1
NetC183_1: C183.1 R110.1 R111.2 U14.4(IN-)
NetC209_2: C209.2 C210.1 C213.2 ESD12.1(ANODE) MIC1.2(-) R154.2
NetC212_1: C212.1 R152.2 R154.1
NetC212_2: C212.2 R92.2 R153.2
NetESD9_1: ESD9.1(ANODE) J2.4 R100.2
NetESD10_1: ESD10.1(ANODE) J2.3 R59.2
NetR69_2: R69.2 U9.C1(INN)
NetR70_2: R70.2 U9.A1(INP)
NetR107_2: R107.2 R108.2 U14.3(IN+)

Not connected (* = marked no-connect by the designer): J2 5 6

### Notes on the sheet
- AUDIO
- Speaker
- AB类
- OPTION:D类
- 注：HPR和HPL默认为差分输出方式。
- Differential pairs
- 注：
  1.HPR和HPL默认为差分输出方式。
  2.AB类功放的增益与D类功放增益不一致，使用D类功放时，软件增益倍数需降低。
- Analog Microphone ( Main MIC )
- OPTION:Head Phone
- (near R128) NOTE:
  1.HPCOM/HPCOMFB should route together as balance line
- MIC1
- L
- R
- GND
- MIC
- close to MIC
- (near R59) iPhone,SAMSUNG: L+R+G+M
- 1
- 2
- 3
- 4
- MIC-HBIAS with current
  detection function.
- (near R59) 注:D点要靠近耳机插座，HPCOM、HPCOMFB分开
  走类差分线回到主控。
- (near R100) D
- 注：该电路为直接驱动模式电路，不支持耳机MIC，
  不适合金属外壳。
- Title
- Size:
- Date:
- A4
- Number:
- Time:
- Revision:
- Sheet
- of
- File:
- (in symbol TitleBlock0-AW) AllWinner Technology Co.,Ltd; Design Name; Size; Page Name; Rev; Date:; Sheet; of

### Library data of the parts
*#10 = TitleBlock0-AW: RevCode: 0.1; Page Create Date: March  8, 1995
C100 C208 C209 = CAPACITOR: PAGE: 2; mypage: 13
C103 C128 C168 C178 = CAPACITOR_Dup1: PAGE: 2
C104 C105 = CAPACITOR_0_Dup5
C120 = CAPACITOR_Dup1
C171 = CAPACITOR_0_Dup3: 规格型号: 原材料; 元件类别: 电容470nF/10V,X5R,±10%,0402 每盘10K; 元件编号: 电容; 备注: YCL0816; PAGE: 1; Vendor: C0402
C172 = CAPACITOR_0_Dup3: 规格型号: 原材料; 元件类别: 电容1UF/6.3V,X5R,±10%,0402 每盘10K; 元件编号: 电容; 备注: YCL0457; PAGE: 1; Vendor: C0402
C181 = CAPACITOR_0_Dup3: PAGE: 1; 备注: YCL0302; 元件编号: 电容; 元件类别: 电容2.2UF/6.3V,X5R,±20%,0402 每盘10K; 规格型号: 原材料; Vendor: C0402
C182 = CAPACITOR_0_Dup3: PAGE: 1; 备注: YCL0816; 元件编号: 电容; 元件类别: 电容470nF/10V,X5R,±10%,0402 每盘10K; 规格型号: 原材料; Vendor: C0402
C183 = CAPACITOR_0_Dup3: PAGE: 1; 备注: YCL0641; 元件编号: 电容; 元件类别: 电容1NF/50V,X7R,±10%,0402 每盘10K; 规格型号: 原材料; Vendor: C0402
C210 = CAPACITOR: mypage: 13; PAGE: 2
C211 C213 = CAPACITOR_Dup1: PAGE: 2; mypage: 13
C212 = CAPACITOR_Dup1: mypage: 13; PAGE: 2
ESD8-ESD13 ESD16-ESD19 = 1_1.5KE100A: as ESD20 on sheet 09 NOR NANDFlash_TF Car
FB1 FB3 = INDUCTOR_0_Dup1: RoHS BEAD/600ohm 100Mhz Z=600Ω DCR<0.2Ω 800mA SMT L0603; OriginalSymbolOrigin: (10,0); Pin Numbers Visible: TRUE; Pin Names Visible: FALSE; Package: SMT; Pin Names Rotate: TRUE
J2 = USB_WIFI_0
J3 J4 = SPEAKER
MIC1 = Micphone_0: mypage: 13
R59 R100 = R_Dup3
R69 R70 = RESISTOR_Dup2
R71 = R_Dup1
R92 R152-R154 = R_Dup4: mypage: 13
R99 R101-R103 = R1 0805_Dup1
R107 R108 = ?_0: 规格型号: 原材料; 元件类别: 电阻20K,±5%,1/16W,0402 每盘10K; 元件编号: 电阻; 备注: YCL0479; Vendor: R0402
R109 = ?_0: 备注: YCL0465; 元件编号: 电阻; 元件类别: 电阻100K,±5%,1/16W,0402 每盘10K; 规格型号: 原材料; Vendor: R0402
R110 = ?_0: 规格型号: 原材料; 元件类别: 电阻33K,±5%,1/16W,0402 每盘10K; 元件编号: 电阻; 备注: YCL0466; Vendor: R0402
R111 = ?_0: 备注: YCL0479; 元件编号: 电阻; 元件类别: 电阻20K,±5%,1/16W,0402 每盘10K; 规格型号: 原材料; Vendor: R0402
R128 = R_Dup4
U9 = AW8010CSR_1
U14 = LY8006_0: 备注: YCL0064; 元件编号: IC; 元件类别: 功放IC4890 / TF690; 规格型号: 原材料; Vendor: MSOP8

## Sheet 11 USB_KEY_GSENSOR.SchDoc
size 420 x 297 mm; Organization: Altium Limited; Address1: L3, 12a Rodborough Rd; Address2: Frenchs Forest; Address3: NSW; Address4: Australia 2086
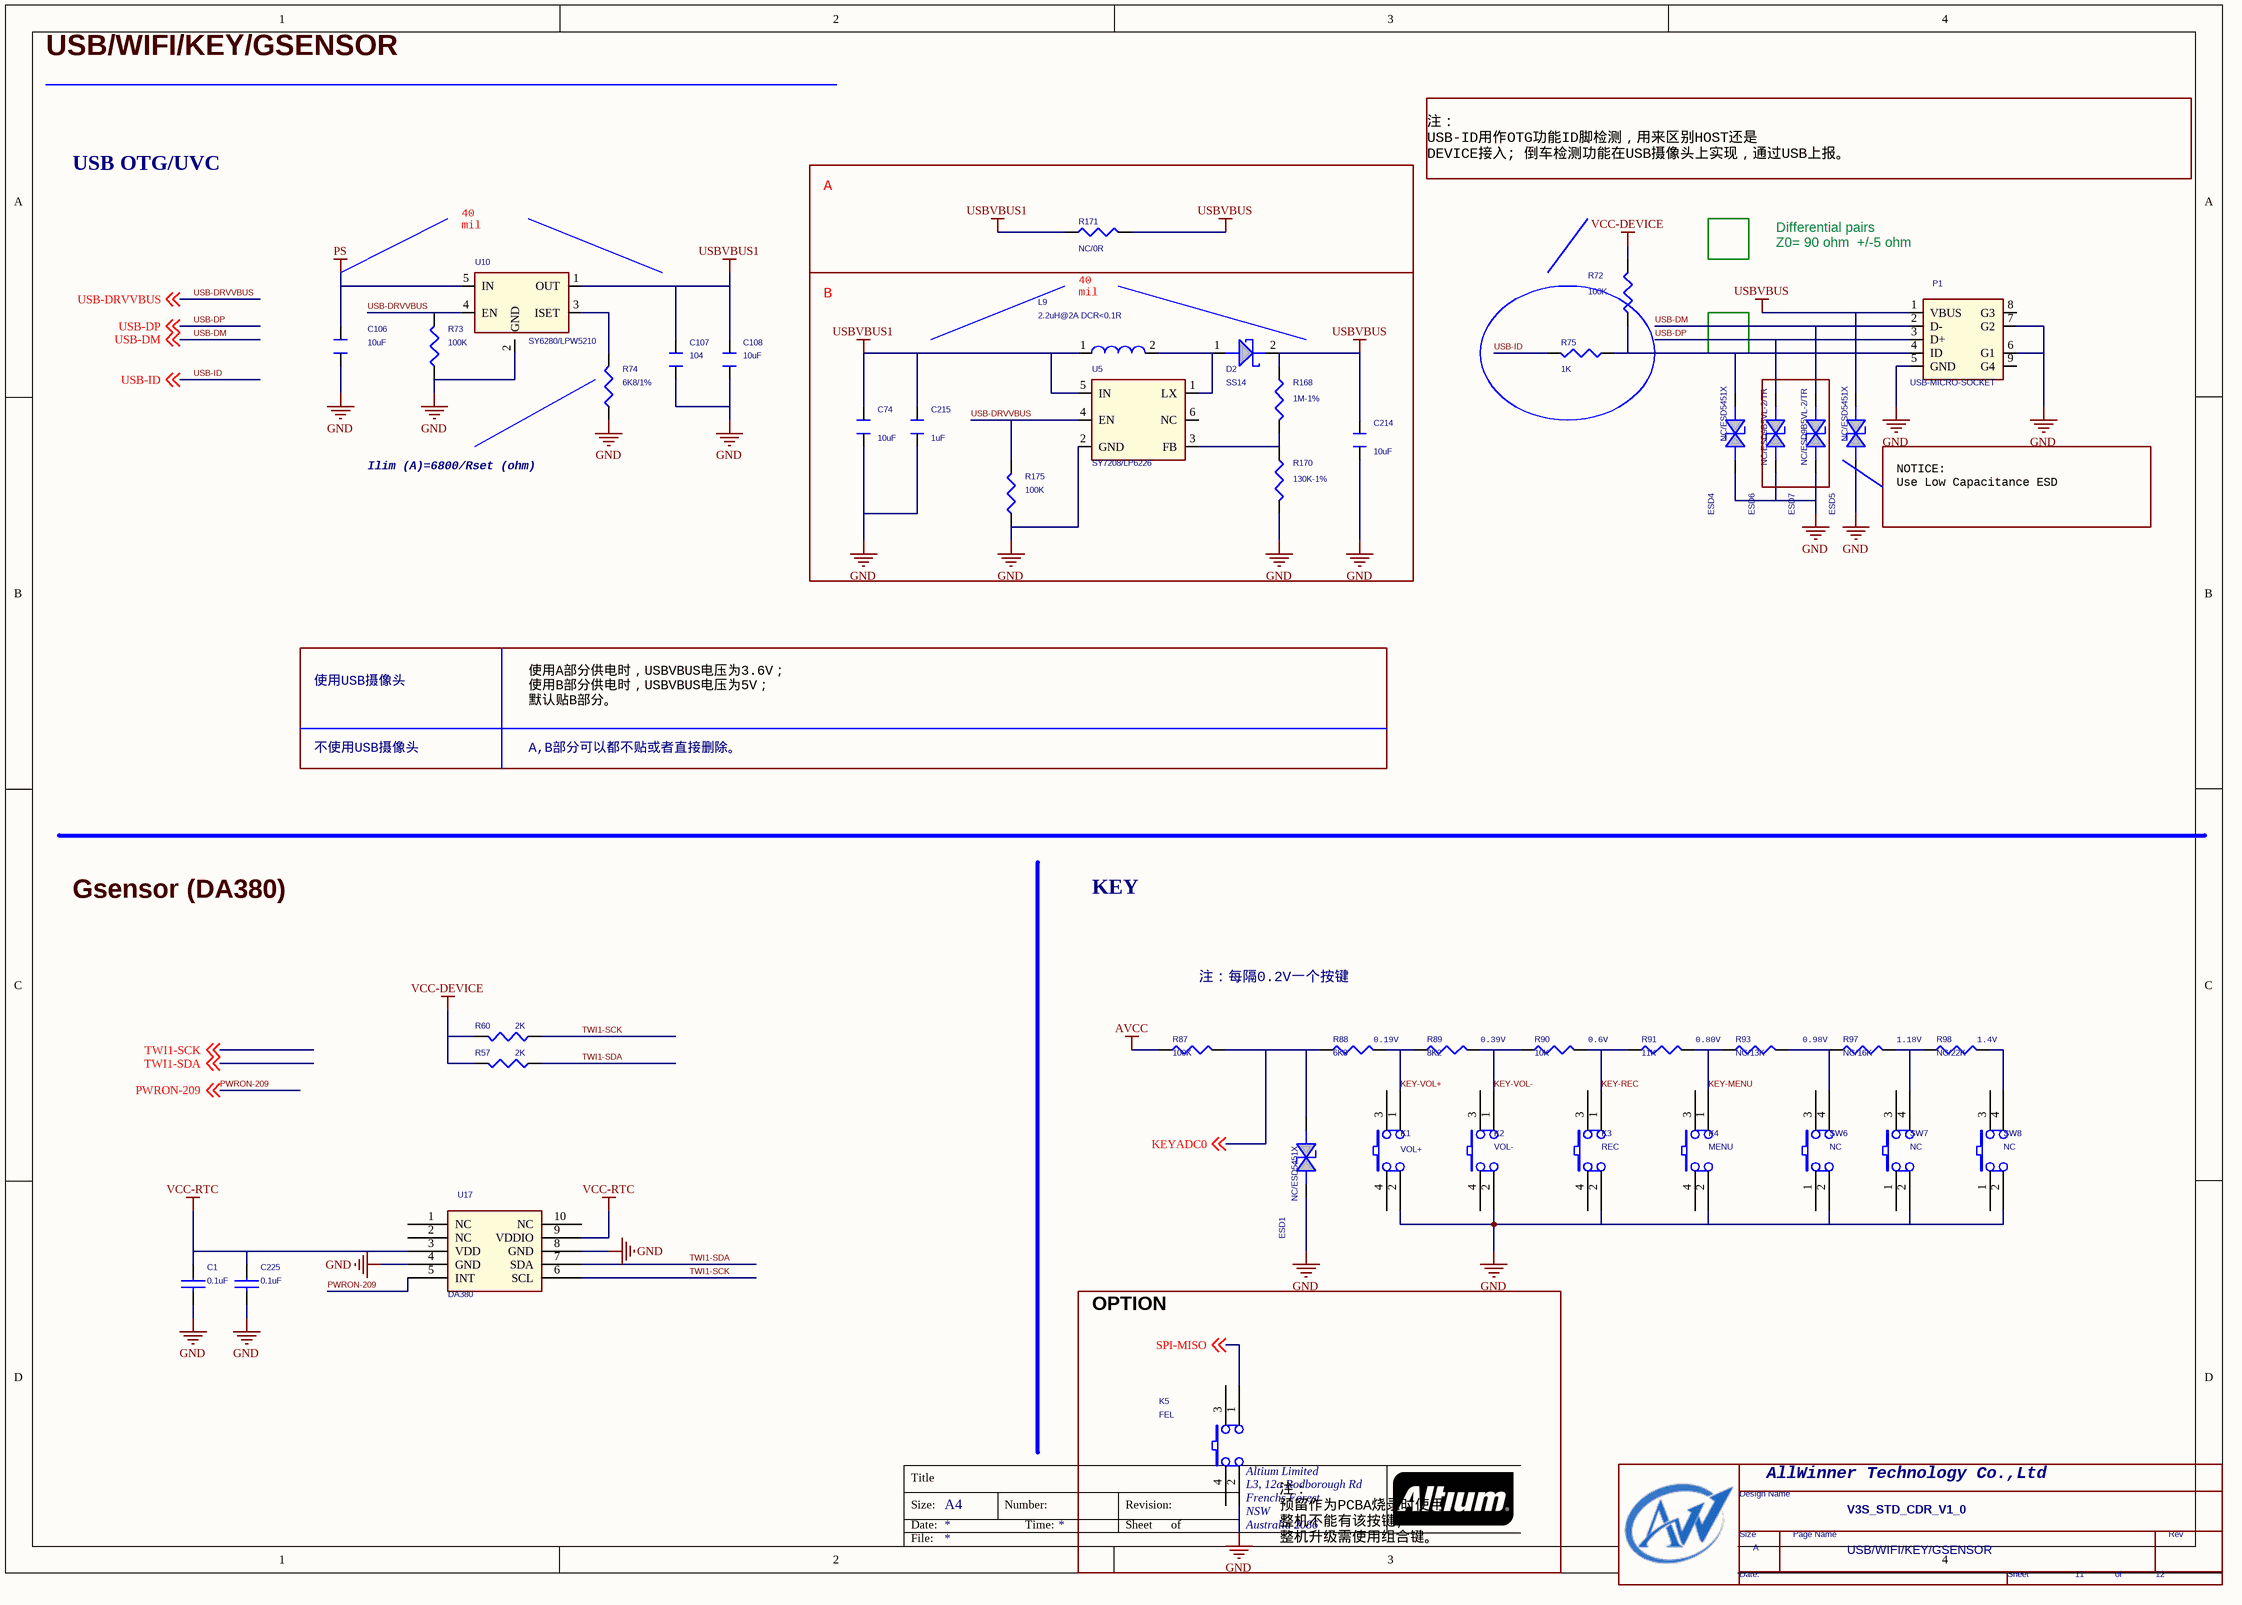
[diagram p10: 11 USB_KEY_GSENSOR.SchDoc]

### Parts
(Parts that share a designator on the sheet are numbered #1, #2 ... from top to bottom, then left to right.)
*#11  Page Count: 12  Page Number: 11  Page Size: A  Title: V3S_STD_CDR_V1_0  Doc: USB/WIFI/KEY/GSENSOR  (hidden comment: TitleBlock0-AW)  (graphical)
C1  0.1uF  [C0402]
C74  10uF  [C0603]
C106  10uF  [C0603]
C107  104  [C0402]
C108  10uF  [C0603]
C214  10uF  [C0603]
C215  1uF  [C0402]
C225  0.1uF  [C0402]
D2  SS14  [SOD123]
ESD1  NC/ESD5451X  [ESD0402]
ESD4  NC/ESD5451X  [ESD0402]
ESD5  NC/ESD5451X  [ESD0402]
ESD6  NC/ESD9B5VL-2/TR  [ESD0402]
ESD7  NC/ESD9B5VL-2/TR  [ESD0402]
K1  VOL+  [SW4]
K2  VOL-  [SW4]
K3  REC  [SW4]
K4  MENU  [SW4]
K5  FEL  [SW4]
L9  2.2uH@2A DCR<0.1R  [CD32]
P1  USB-MICRO-SOCKET  [USB_MINI_AB]
R57  2K  [R0402]
R60  2K  [R0402]
R72  100K  [R0402]
R73  100K  [R0402]
R74  6K8/1%  [R0402]
R75  1K  [R0402]
R87  100K  [0805]
R88  6K8  [0805]
R89  8K2  [0805]
R90  10K  [0805]
R91  11K  [0805]
R93  NC/13K  [0805]
R97  NC/16K  [0805]
R98  NC/22K  [0805]
R168  1M-1%  [R0402]
R170  130K-1%  [R0402]
R171  NC/0R  [R0603]
R175  100K  [R0402]
SW6  NC  [SW4]
SW7  NC  [SW4]
SW8  NC  [SW4]
U5  SY7208/LP6226  [SOT23-6]
U10  SY6280/LPW5210  [SOT23-6]
U17  DA380  [DA380]

### Blocks framed on the sheet
A: R171
B: C74 C214 C215 D2 L9 R168 R170 R175 U5

### Nets
AVCC: R87.1
GND: C1.2 C74.1 C106.1 C107.1 C108.1 C214.1 C215.1 C225.2 ESD1.2(CATHODE) ESD4.2(CATHODE) ESD5.2(CATHODE) ESD6.2(CATHODE) ESD7.2(CATHODE) K1.2 K2.2 K3.2 K4.2 K5.2 P1.5(GND) P1.6(G1) P1.7(G2) R73.1 R74.1 R170.2 R175.1 SW6.2 SW7.2 SW8.2 U5.2(GND) U10.2(GND) U17.4(GND) U17.8(GND)
PS: C106.2 U10.5(IN)
USBVBUS: C214.2 D2.2 ESD5.1(ANODE) P1.1(VBUS) R168.1 R171.2
USBVBUS1: C74.2 C107.2 C108.2 C215.2 L9.1 R171.1 U5.5(IN) U10.1(OUT)
VCC-DEVICE: R57.2 R60.2 R72.2  [project net DCDC3]
VCC-RTC: C1.1 C225.1 U17.3(VDD) U17.9(VDDIO)  [project net LDO1]
KEY-MENU: K4.1 R91.2 R93.1
KEY-REC: K3.1 R90.2 R91.1
KEY-VOL+: K1.1 R88.2 R89.1
KEY-VOL-: K2.1 R89.2 R90.1
KEYADC0: ESD1.1(ANODE) R87.2 R88.1 ; off-sheet KEYADC0
PWRON-209: U17.5(INT) ; off-sheet PWRON-209
SPI-MISO: K5.1 ; off-sheet SPI-MISO
TWI1-SCK: R60.1 U17.6(SCL) ; off-sheet TWI1-SCK  [project net CTP-SCK]
TWI1-SDA: R57.1 U17.7(SDA) ; off-sheet TWI1-SDA  [project net CTP-SDA]
USB-DM: ESD7.1(ANODE) P1.2(D-) ; off-sheet USB-DM
USB-DP: ESD6.1(ANODE) P1.3(D+) ; off-sheet USB-DP
USB-DRVVBUS: R73.2 R175.2 U5.4(EN) U10.4(EN) ; off-sheet USB-DRVVBUS
USB-ID: R75.2 ; off-sheet USB-ID
NetD2_1: D2.1 L9.2 U5.1(LX)
NetESD4_1: ESD4.1(ANODE) P1.4(ID) R72.1 R75.1
NetR74_2: R74.2 U10.3(ISET)
NetR93_2: R93.2 R97.1 SW6.4
NetR97_2: R97.2 R98.1 SW7.4
NetR98_2: R98.2 SW8.4
NetR168_2: R168.2 R170.1 U5.3(FB)

Not connected (* = marked no-connect by the designer): K1 3 4; K2 3 4; K3 3 4; K4 3 4; K5 3 4; P1 8(G3) 9(G4); SW6 1 3; SW7 1 3; SW8 1 3; U5 6(NC); U17 1(NC) 2(NC) 10(NC)

### Notes on the sheet
- USB/WIFI/KEY/GSENSOR
- 注：
  USB-ID用作OTG功能ID脚检测，用来区别HOST还是
  DEVICE接入; 倒车检测功能在USB摄像头上实现，通过USB上报。
- USB OTG/UVC
- (near U10) 40
  mil
- Differential pairs
  Z0= 90 ohm  +/-5 ohm
- 40
  mil
- (near ESD5) NOTICE:
  Use Low Capacitance ESD
- Ilim (A)=6800/Rset (ohm)
- 使用A部分供电时，USBVBUS电压为3.6V；
  使用B部分供电时，USBVBUS电压为5V；
  默认贴B部分。
- 使用USB摄像头
- 不使用USB摄像头
- A,B部分可以都不贴或者直接删除。
- Gsensor (DA380)
- KEY
- 注：每隔0.2V一个按键
- (near R88) 0.19V
- (near R89) 0.39V
- (near R90) 0.6V
- 0.80V
- 0.98V
- 1.18V
- (near R98) 1.4V
- OPTION
- (near *#11) 注：
  预留作为PCBA烧录时使用，
  整机不能有该按键;
  整机升级需使用组合键。
- Title
- Size:
- Date:
- A4
- Number:
- Time:
- Revision:
- Sheet
- of
- File:
- (in symbol TitleBlock0-AW) AllWinner Technology Co.,Ltd; Design Name; Size; Page Name; Rev; Date:; Sheet; of

### Library data of the parts
*#11 = TitleBlock0-AW: RevCode: 0.1; Page Create Date: March  8, 1995
C1 C225 = CAP NP: MC 0.1uF 6.3V X5R K 0201; Schematic Part: \\172.16.1.197\db\discrete\cap; Part Number: VG0327671041801; Tolerance: K; Voltage: 6.3V
C74 C214 C215 = CAPACITOR_0_Dup1: PAGE: 1
C106 = CAPACITOR_Dup1
C107 C108 = CAPACITOR_Dup1: Page: 9
D2 = DIODE_SCHOTTKY_0
ESD1 ESD4-ESD7 = 1_1.5KE100A: as ESD20 on sheet 09 NOR NANDFlash_TF Car
K1 = SW_PUSH_2: SDTSourceLibName: C:\WIND95\TEMP\6200.LIB; Page: 11
K2 = SW_PUSH_3: SDTSourceLibName: C:\WIND95\TEMP\6200.LIB; Page: 11
K3 = SW_PUSH_4: SDTSourceLibName: C:\WIND95\TEMP\6200.LIB; Page: 11
K4 K5 = SW_PUSH_5: SDTSourceLibName: C:\WIND95\TEMP\6200.LIB; Page: 11
L9 = INDUCTOR_Dup1
P1 = USB_MINI_SOCKET_2
R57 R60 R168 R170 R171 = R_Dup4
R72 R75 = R_Dup3
R73 R74 R175 = R_Dup3: Page: 9
R87-R91 = R1 0805_Dup2: Page: 11
R93 R97 R98 = R1 0805
SW6-SW8 = SW_PUSH: SDTSourceLibName: C:\WIND95\TEMP\6200.LIB
U5 = RT9266PE_3
U10 = RT9266PE_2: Page: 9
U17 = GPR25L005B_0

## Sheet 12 RGB LCD.SchDoc
size 420 x 297 mm; Organization: Altium Limited; Address1: L3, 12a Rodborough Rd; Address2: Frenchs Forest; Address3: NSW; Address4: Australia 2086
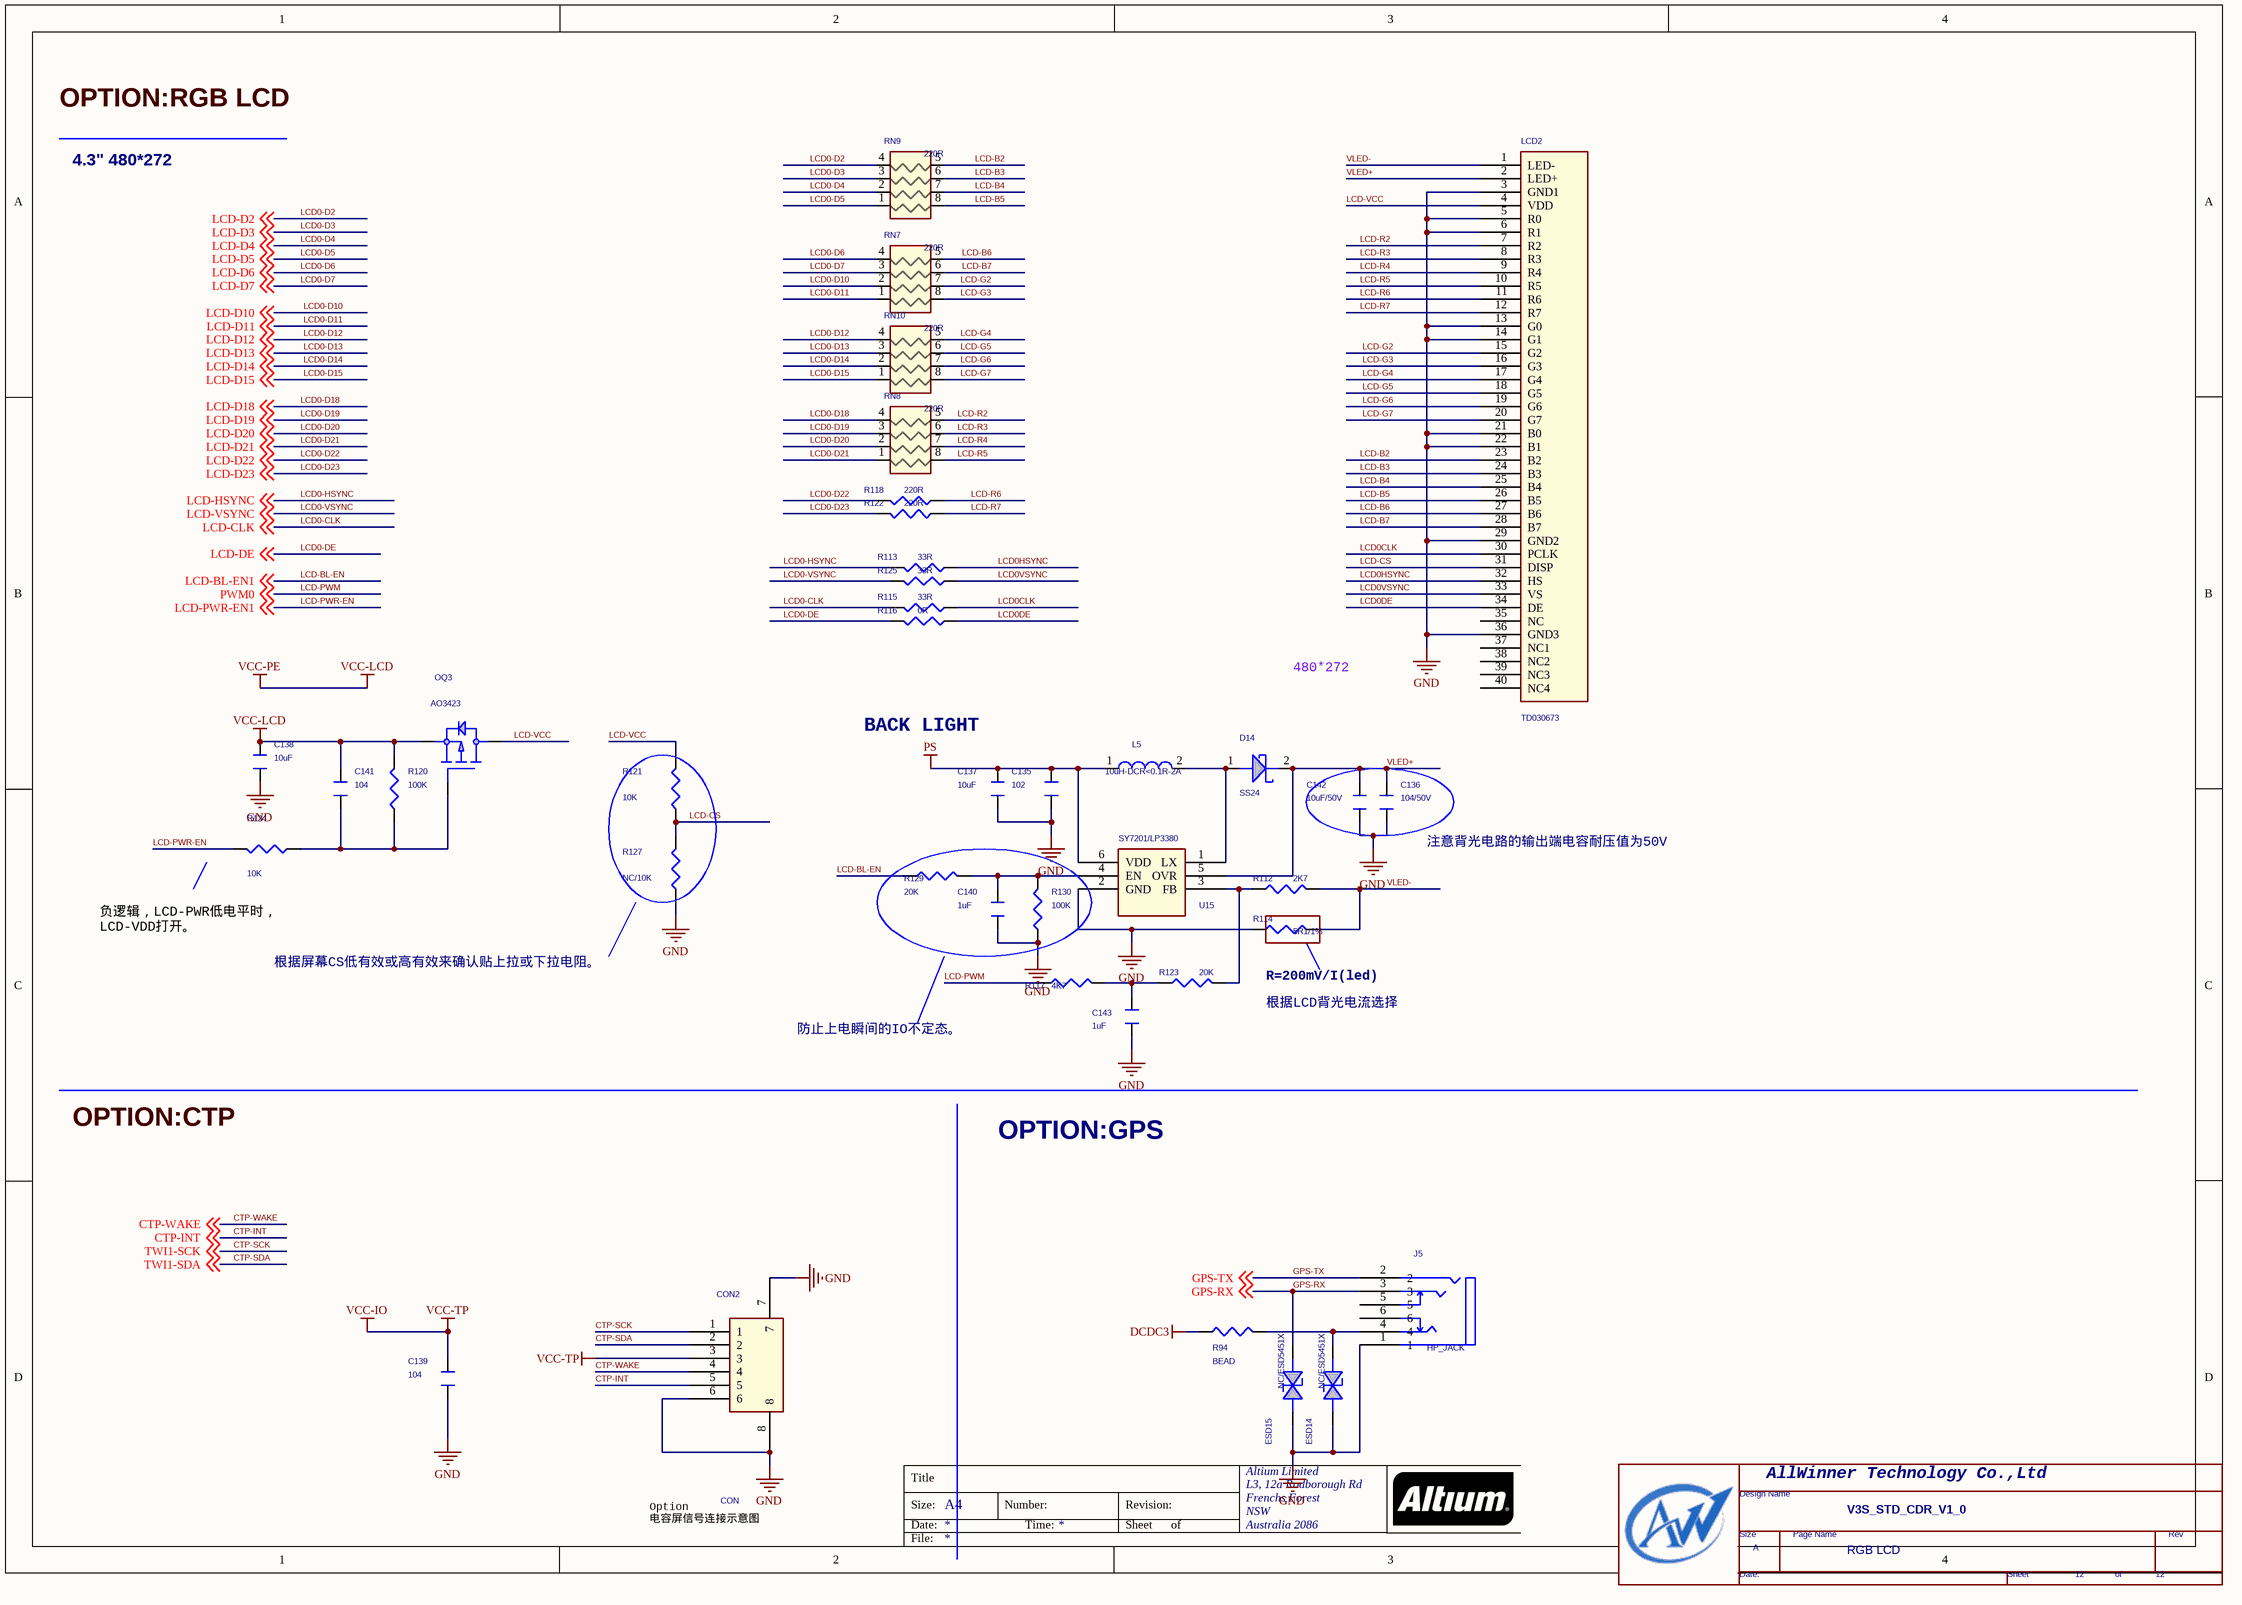
[diagram p11: 12 RGB LCD.SchDoc]

### Parts
(Parts that share a designator on the sheet are numbered #1, #2 ... from top to bottom, then left to right.)
*#12  Page Count: 12  Page Size: A  Title: V3S_STD_CDR_V1_0  Doc: RGB LCD  (hidden comment: TitleBlock0-AW)  (graphical)
C135  102  [C0402]
C136  104/50V  [C0603]
C137  10uF  [C0603]
C138  10uF  [C0603]
C139  104  [C0402]
C140  1uF  [C0402]
C141  104  [C0402]
C142  10uF/50V  [C0805]
C143  1uF  [C0402]
CON2  CON  [SOT23-6]
D14  SS24  [SOD123]
ESD14  NC/ESD5451X  [ESD9B5V]
ESD15  NC/ESD5451X  [ESD9B5V]
J5  HP_JACK  [EAR-JACK-3-5]
L5  10uH-DCR<0.1R-2A  [CD43]
LCD2  TD030673  [CON40]
OQ3  AO3423  [SOT-23]
R94  BEAD  [R0603]
R112  2K7  [R0402]
R113  33R  [R0402]
R114  5R1/1%  [R0402]
R115  33R  [R0402]
R116  0R  [R0402]
R117  4K7  [R0402]
R118  220R  [R0402]
R120  100K  [R0402]
R121  10K  [R0402]
R122  220R  [R0402]
R123  20K  [R0402]
R124  10K  [R0402]
R125  33R  [R0402]
R127  NC/10K  [R0402]
R129  20K  [R0402]
R130  100K  [R0402]
RN7  220R  [RCA50-8]
RN8  220R  [RCA50-8]
RN9  220R  [RCA50-8]
RN10  220R  [RCA50-8]
U15  SY7201/LP3380  [SOT23-6]

### Nets
DCDC3: C139.2 CON2.3 R94.1  [also labelled VCC-IO, VCC-TP]
GND: C135.1 C136.1 C137.1 C138.1 C139.1 C140.1 C142.1 C143.1 CON2.6 CON2.7 CON2.8 ESD14.2(CATHODE) ESD15.2(CATHODE) J5.1 LCD2.3(GND1) LCD2.5(R0) LCD2.6(R1) LCD2.13(G0) LCD2.14(G1) LCD2.21(B0) LCD2.22(B1) LCD2.29(GND2) LCD2.36(GND3) R114.2 R127.2 R130.1 U15.2(GND)
PS: C135.2 C137.2 L5.1 U15.6(VDD)
VCC-LCD: C138.2 C141.2 OQ3.2(SOURCE) R120.2  [also labelled VCC-PE]  [project net MIPI-IOVCC]
CTP-INT: CON2.5 ESD15.1(ANODE) J5.3 ; off-sheet CTP-INT, off-sheet GPS-RX  [also labelled GPS-RX]
CTP-SCK: CON2.1 ; off-sheet TWI1-SCK  [also labelled TWI1-SCK]
CTP-SDA: CON2.2 ; off-sheet TWI1-SDA  [also labelled TWI1-SDA]
CTP-WAKE: CON2.4 J5.2 ; off-sheet CTP-WAKE, off-sheet GPS-TX  [also labelled GPS-TX]
LCD0CLK: LCD2.30(PCLK) R115.1
LCD0DE: LCD2.34(DE) R116.1
LCD0HSYNC: LCD2.32(HS) R113.1
LCD0VSYNC: LCD2.33(VS) R125.1
LCD-B2: LCD2.23(B2) RN9.5
LCD-B3: LCD2.24(B3) RN9.6
LCD-B4: LCD2.25(B4) RN9.7
LCD-B5: LCD2.26(B5) RN9.8
LCD-B6: LCD2.27(B6) RN7.5
LCD-B7: LCD2.28(B7) RN7.6
LCD-BL-EN: R129.1 RN10.3 ; off-sheet LCD-D13, off-sheet LCD-BL-EN1  [also labelled LCD-BL-EN1, LCD-D13, LCD0-D13]
LCD-CLK: R115.2 ; off-sheet LCD-CLK  [also labelled LCD0-CLK]
LCD-CS: LCD2.31(DISP) R121.2 R127.1 RN10.1 ; off-sheet LCD-D15  [also labelled LCD-D15, LCD0-D15]
LCD-D2: RN9.4 ; off-sheet LCD-D2  [also labelled LCD0-D2]
LCD-D3: RN9.3 ; off-sheet LCD-D3  [also labelled LCD0-D3]
LCD-D4: RN9.2 ; off-sheet LCD-D4  [also labelled LCD0-D4]
LCD-D5: RN9.1 ; off-sheet LCD-D5  [also labelled LCD0-D5]
LCD-D6: RN7.4 ; off-sheet LCD-D6  [also labelled LCD0-D6]
LCD-D7: RN7.3 ; off-sheet LCD-D7  [also labelled LCD0-D7]
LCD-D10: RN7.2 ; off-sheet LCD-D10  [also labelled LCD0-D10]
LCD-D11: RN7.1 ; off-sheet LCD-D11  [also labelled LCD0-D11]
LCD-D12: RN10.4 ; off-sheet LCD-D12  [also labelled LCD0-D12]
LCD-D14: R124.2 RN10.2 ; off-sheet LCD-PWR-EN1, off-sheet LCD-D14  [also labelled LCD-PWR-EN, LCD-PWR-EN1, LCD0-D14]
LCD-D18: RN8.4 ; off-sheet LCD-D18  [also labelled LCD0-D18]
LCD-D19: RN8.3 ; off-sheet LCD-D19  [also labelled LCD0-D19]
LCD-D20: RN8.2 ; off-sheet LCD-D20  [also labelled LCD0-D20]
LCD-D21: RN8.1 ; off-sheet LCD-D21  [also labelled LCD0-D21]
LCD-D22: R118.2 ; off-sheet LCD-D22  [also labelled LCD0-D22]
LCD-D23: R122.2 ; off-sheet LCD-D23  [also labelled LCD0-D23]
LCD-DE: R116.2 ; off-sheet LCD-DE  [also labelled LCD0-DE]
LCD-G2: LCD2.15(G2) RN7.7
LCD-G3: LCD2.16(G3) RN7.8
LCD-G4: LCD2.17(G4) RN10.5
LCD-G5: LCD2.18(G5) RN10.6
LCD-G6: LCD2.19(G6) RN10.7
LCD-G7: LCD2.20(G7) RN10.8
LCD-HSYNC: R113.2 ; off-sheet LCD-HSYNC  [also labelled LCD0-HSYNC]
LCD-PWM: R117.1 ; off-sheet PWM0  [also labelled PWM0]
LCD-R2: LCD2.7(R2) RN8.5
LCD-R3: LCD2.8(R3) RN8.6
LCD-R4: LCD2.9(R4) RN8.7
LCD-R5: LCD2.10(R5) RN8.8
LCD-R6: LCD2.11(R6) R118.1
LCD-R7: LCD2.12(R7) R122.1
LCD-VCC: LCD2.4(VDD) OQ3.3(DRAIN) R121.1
LCD-VSYNC: R125.2 ; off-sheet LCD-VSYNC  [also labelled LCD0-VSYNC]
VLED+: C136.2 C142.2 D14.2 LCD2.2(LED+) U15.5(OVR)
VLED-: LCD2.1(LED-) R112.2 R114.1
NetC140_2: C140.2 R129.2 R130.2 U15.4(EN)
NetC141_1: C141.1 OQ3.1(GATE) R120.1 R124.1
NetC143_2: C143.2 R117.2 R123.1
NetD14_1: D14.1 L5.2 U15.1(LX)
NetESD14_1: ESD14.1(ANODE) J5.4 R94.2
NetR112_1: R112.1 R123.2 U15.3(FB)

Not connected (* = marked no-connect by the designer): J5 5 6; LCD2 35(NC) 37(NC1) 38(NC2) 39(NC3) 40(NC4)

### Notes on the sheet
- OPTION:RGB LCD
- 4.3" 480*272
- 480*272
- BACK LIGHT
- 注意背光电路的输出端电容耐压值为50V
- 负逻辑，LCD-PWR低电平时，
  LCD-VDD打开。
- 根据屏幕CS低有效或高有效来确认贴上拉或下拉电阻。
- R=200mV/I(led)
- 防止上电瞬间的IO不定态。
- 根据LCD背光电流选择
- OPTION:CTP
- OPTION:GPS
- Option
  电容屏信号连接示意图
- Title
- Size:
- Date:
- A4
- Number:
- Time:
- Revision:
- Sheet
- of
- File:
- (in symbol TitleBlock0-AW) AllWinner Technology Co.,Ltd; Design Name; Size; Page Name; Rev; Date:; Sheet; of

### Library data of the parts
*#12 = TitleBlock0-AW: RevCode: 0.1; Page Number: 12; Page Create Date: March  8, 1995
C135 C137 C143 = CAPACITOR_0_Dup5: mypage: 09; Page: 10
C136 C140 C142 = CAPACITOR_0_Dup5: Page: 10; mypage: 09
C138 C141 = CAPACITOR_Dup1: Page: 10
C139 = CAPACITOR_0_Dup5: PAGE: 2
CON2 = RT9266PE_0
D14 = DIODE SCHOTTKY: as D6 on sheet 08 Serial RGB LCD
ESD14 ESD15 = 1_1.5KE100A: as ESD20 on sheet 09 NOR NANDFlash_TF Car
J5 = USB_WIFI_0
L5 = INDUCTOR: as L6 on sheet 08 Serial RGB LCD
LCD2 = TD030673_0: Page: 10
OQ3 = PMOS: Page: 10
R94 = R: Part Description: Chip Resistor
R112 R114 R117 R123 = RESISTOR_Dup2: mypage: 09; Page: 10
R113 R115 R116 R118 R122 R125 = R_Dup4: Page: 10
R120 R124 = R_Dup3: Page: 10
R121 R127 = RESISTOR_5: Page: 10
R129 R130 = RESISTOR_Dup2: Page: 10; mypage: 09
RN7-RN10 = 742C083/SM_0: Page: 10
U15 = AP3031: Page: 10